# EAGLE schematic ArduSatPayloadModule (EAGLE 6.3), part 1 of 2

## Sheet 1 of 19
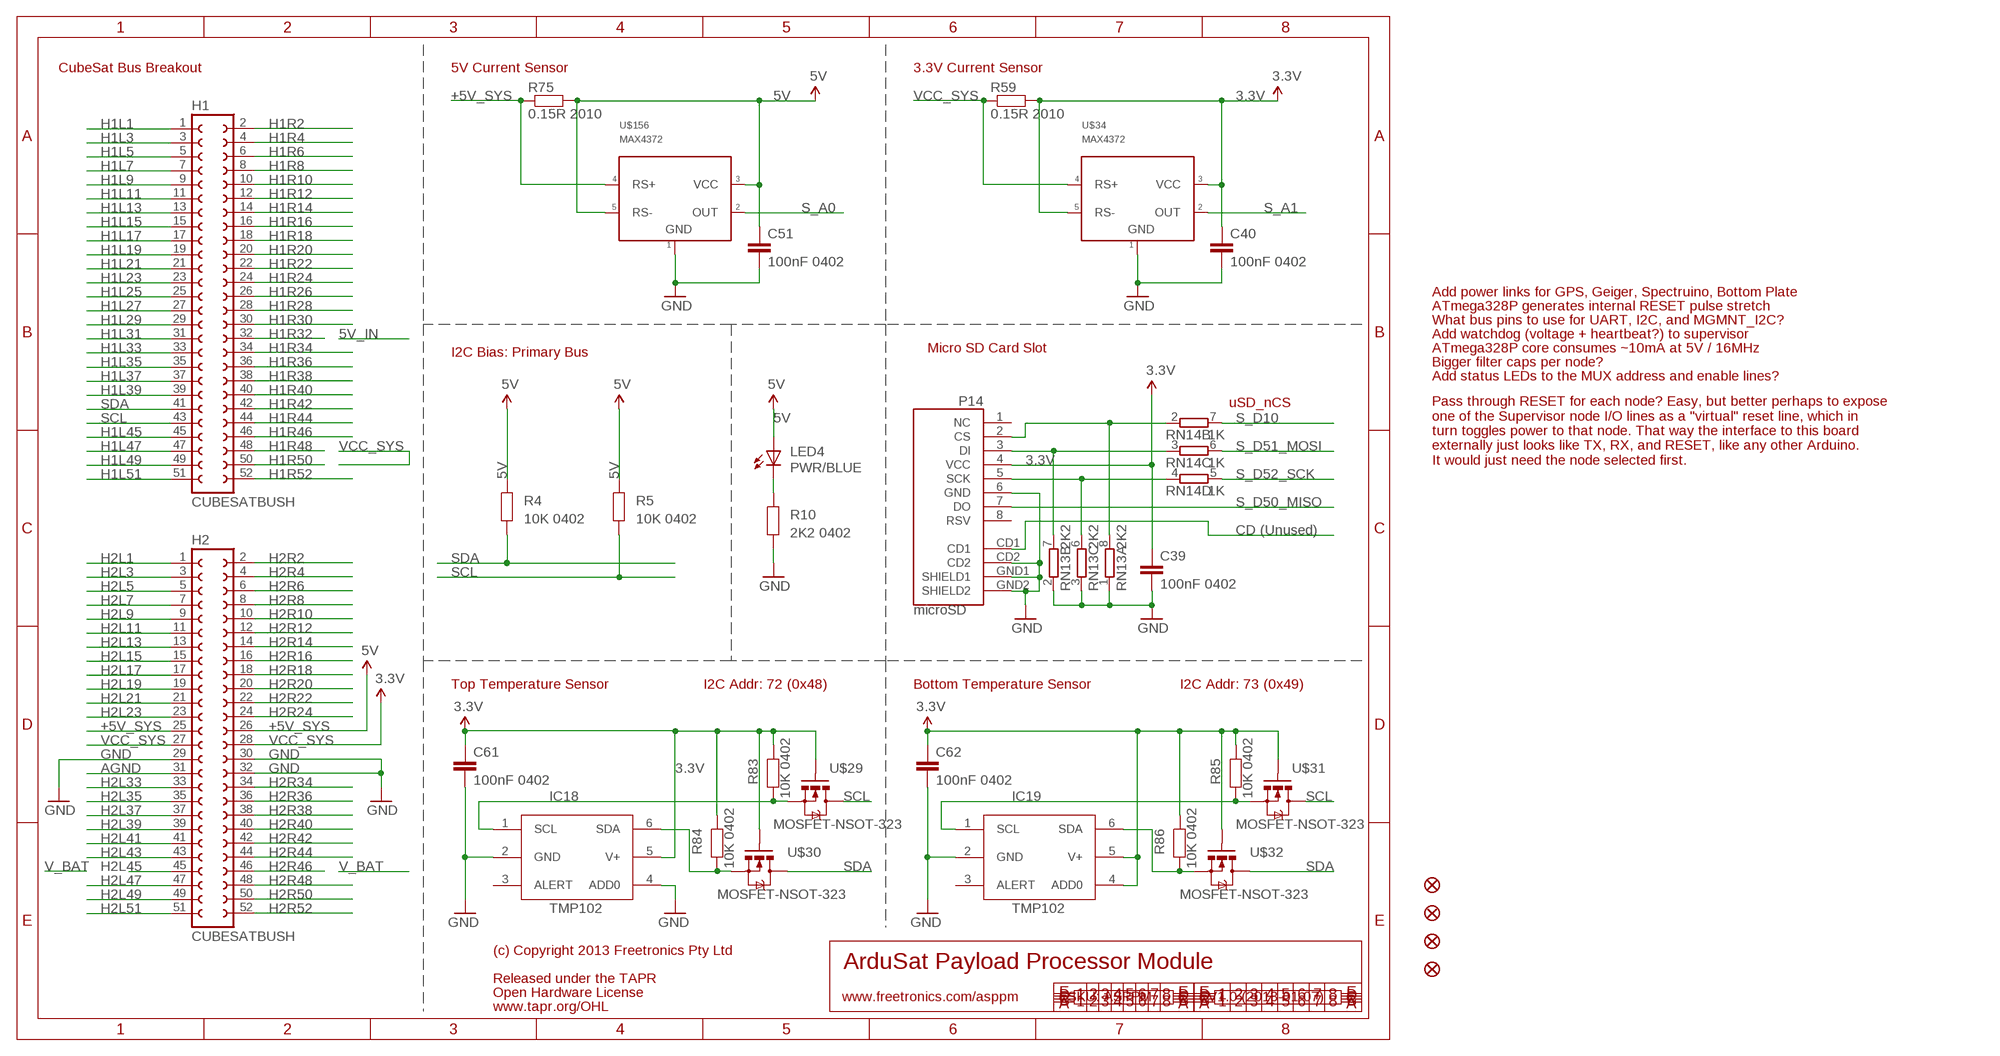
[diagram p0: schematic, sheet 1]

### Parts
C39  100nF 0402  C-EU0402C  [0402C]
C40  100nF 0402  CAP0603  [0603]
C51  100nF 0402  CAP0603  [0603]
C61  100nF 0402  C-EU0402C  [0402C]
C62  100nF 0402  C-EU0402C  [0402C]
FID1  FIDUCIAL1X2.5  [FIDUCIAL-1X2.5]
FID2  FIDUCIAL1X2.5  [FIDUCIAL-1X2.5]
FID3  FIDUCIAL1X2.5  [FIDUCIAL-1X2.5]
FID4  FIDUCIAL1X2.5  [FIDUCIAL-1X2.5]
H1  CUBESATBUSH  [CUBESATBUS]
H2  CUBESATBUSH  [CUBESATBUS]
IC18  TMP102  [SOT563]
IC19  TMP102  [SOT563]
LED4  PWR/BLUE  LED0603  [LED-0603]
P14  microSD  USD-SOCKETNEW  [MICRO-SD-SOCKET-PP]
R4  10K 0402  RESISTOR0402  [0402]
R5  10K 0402  RESISTOR0402  [0402]
R10  2K2 0402  RESISTOR0402  [0402]
R59  0.15R 2010  RESISTOR2010  [R2010]
R75  0.15R 2010  RESISTOR2010  [R2010]
R83  10K 0402  RESISTOR0402  [0402]
R84  10K 0402  RESISTOR0402  [0402]
R85  10K 0402  RESISTOR0402  [0402]
R86  10K 0402  RESISTOR0402  [0402]
RN13  2K2  4R-NCAY16  [CAY16]
RN14  1K  4R-NCAY16  [CAY16]
U$29  MOSFET-NSOT-323  [SOT32-3]
U$30  MOSFET-NSOT-323  [SOT32-3]
U$31  MOSFET-NSOT-323  [SOT32-3]
U$32  MOSFET-NSOT-323  [SOT32-3]
U$34  MAX4372  [SOT23-5]
U$156  MAX4372  [SOT23-5]

### Nets
3.3V: C39.1 C40.1 C61.1 C62.1 IC18.5(V+) IC19.4(ADD0) IC19.5(V+) P14.4(VCC) R59.2 R83.2 R84.2 R85.2 R86.2 U$29.1(G) U$30.1(G) U$31.1(G) U$32.1(G) U$34.3(VCC) U$34.5(RS-) ; also sheet 3
5V: C51.1 LED4.A R4.2 R5.2 R75.2 U$156.3(VCC) U$156.5(RS-) ; also sheet 2,3,4,5,6,7,8,9,10,11,12,13,14,15,16,17,18,19
+5V_SYS: H2.25 H2.26 R75.1 U$156.4(RS+) ; supply symbol labelled 5V
AGND: H2.31
GND: C39.2 C40.2 C51.2 C61.2 C62.2 H2.29 H2.30 H2.32 IC18.2(GND) IC18.4(ADD0) IC19.2(GND) P14.6(GND) P14.CD2 P14.GND1(SHIELD1) P14.GND2(SHIELD2) R10.1 RN13.1 RN13.2 RN13.3 U$34.1(GND) U$156.1(GND) ; also sheet 2,3,4,5,6,7,8,9,10,11,12,13,14,15,16,17,18,19
H1L1: H1.1
H1L3: H1.3
H1L5: H1.5
H1L7: H1.7
H1L9: H1.9
H1L11: H1.11
H1L13: H1.13
H1L15: H1.15
H1L17: H1.17
H1L19: H1.19
H1L21: H1.21
H1L23: H1.23
H1L25: H1.25
H1L27: H1.27
H1L29: H1.29
H1L31: H1.31
H1L33: H1.33
H1L35: H1.35
H1L37: H1.37
H1L39: H1.39
H1L45: H1.45
H1L47: H1.47
H1L49: H1.49
H1L51: H1.51
H1R2: H1.2
H1R4: H1.4
H1R6: H1.6
H1R8: H1.8
H1R10: H1.10
H1R12: H1.12
H1R14: H1.14
H1R16: H1.16
H1R18: H1.18
H1R20: H1.20
H1R22: H1.22
H1R24: H1.24
H1R26: H1.26
H1R28: H1.28
H1R30: H1.30
H1R32: H1.32
H1R34: H1.34
H1R36: H1.36
H1R38: H1.38
H1R40: H1.40
H1R42: H1.42
H1R44: H1.44
H1R46: H1.46
H1R48: H1.48
H1R50: H1.50
H1R52: H1.52
H2L1: H2.1
H2L3: H2.3
H2L5: H2.5
H2L7: H2.7
H2L9: H2.9
H2L11: H2.11
H2L13: H2.13
H2L15: H2.15
H2L17: H2.17
H2L19: H2.19
H2L21: H2.21
H2L23: H2.23
H2L33: H2.33
H2L35: H2.35
H2L37: H2.37
H2L39: H2.39
H2L41: H2.41
H2L43: H2.43
H2L45: H2.45
H2L47: H2.47
H2L49: H2.49
H2L51: H2.51
H2R2: H2.2
H2R4: H2.4
H2R6: H2.6
H2R8: H2.8
H2R10: H2.10
H2R12: H2.12
H2R14: H2.14
H2R16: H2.16
H2R18: H2.18
H2R20: H2.20
H2R22: H2.22
H2R24: H2.24
H2R34: H2.34
H2R36: H2.36
H2R38: H2.38
H2R40: H2.40
H2R42: H2.42
H2R44: H2.44
H2R46: H2.46
H2R48: H2.48
H2R50: H2.50
H2R52: H2.52
N$14: LED4.C R10.2
N$23: P14.2(CS) RN13.8 RN14.2
N$90: P14.3(DI) RN13.7 RN14.3
N$321: P14.5(SCK) RN13.6 RN14.4
N$338: P14.CD1
N$9999: IC18.1(SCL) R83.1 U$29.2(S)
N$10001: IC18.6(SDA) R84.1 U$30.2(S)
N$10002: IC19.6(SDA) R86.1 U$32.2(S)
N$10003: IC19.1(SCL) R85.1 U$31.2(S)
S_A0: U$156.2(OUT) ; also sheet 2
S_A1: U$34.2(OUT) ; also sheet 2
S_D10: RN14.7 ; also sheet 2
S_D50_MISO: P14.7(DO) ; also sheet 2
S_D51_MOSI: RN14.6 ; also sheet 2
S_D52_SCK: RN14.5 ; also sheet 2
SCL: H1.43 R5.1 U$29.3(D) U$31.3(D) ; also sheet 2,3,4,5,6,7,8,9,10,11,12,13,14,15,16,17,18,19
SDA: H1.41 R4.1 U$30.3(D) U$32.3(D) ; also sheet 2,3,4,5,6,7,8,9,10,11,12,13,14,15,16,17,18,19
VCC_SYS: H2.27 H2.28 R59.1 U$34.4(RS+) ; supply symbol labelled 3.3V
Unconnected: IC18.3(ALERT) IC19.3(ALERT) P14.1(NC) P14.8(RSV) RN13.4 RN13.5 RN14.1 RN14.8

### Notes on the sheet
- CubeSat Bus Breakout | 5V Current Sensor | 3.3V Current Sensor
- Add power links for GPS, Geiger, Spectruino, Bottom Plate
- ATmega328P generates internal RESET pulse stretch
- What bus pins to use for UART, I2C, and MGMNT_I2C?
- Add watchdog (voltage + heartbeat?) to supervisor
- Micro SD Card Slot | ATmega328P core consumes ~10mA at 5V / 16MHz
- I2C Bias: Primary Bus
- Bigger filter caps per node?
- Add status LEDs to the MUX address and enable lines?
- uSD_nCS
- Pass through RESET for each node? Easy, but better perhaps to expose
  one of the Supervisor node I/O lines as a "virtual" reset line, which in
  turn toggles power to that node. That way the interface to this board
  externally just looks like TX, RX, and RESET, like any other Arduino.
  It would just need the node selected first.
- CD (Unused)
- Top Temperature Sensor | I2C Addr: 72 (0x48) | Bottom Temperature Sensor | I2C Addr: 73 (0x49)
- (c) Copyright 2013 Freetronics Pty Ltd
- ArduSat Payload Processor Module
- Released under the TAPR
- Open Hardware License
- www.freetronics.com/asppm | SKU: ASPPM | V1.0 (2013-01-07)
- www.tapr.org/OHL

## Sheet 2 of 19
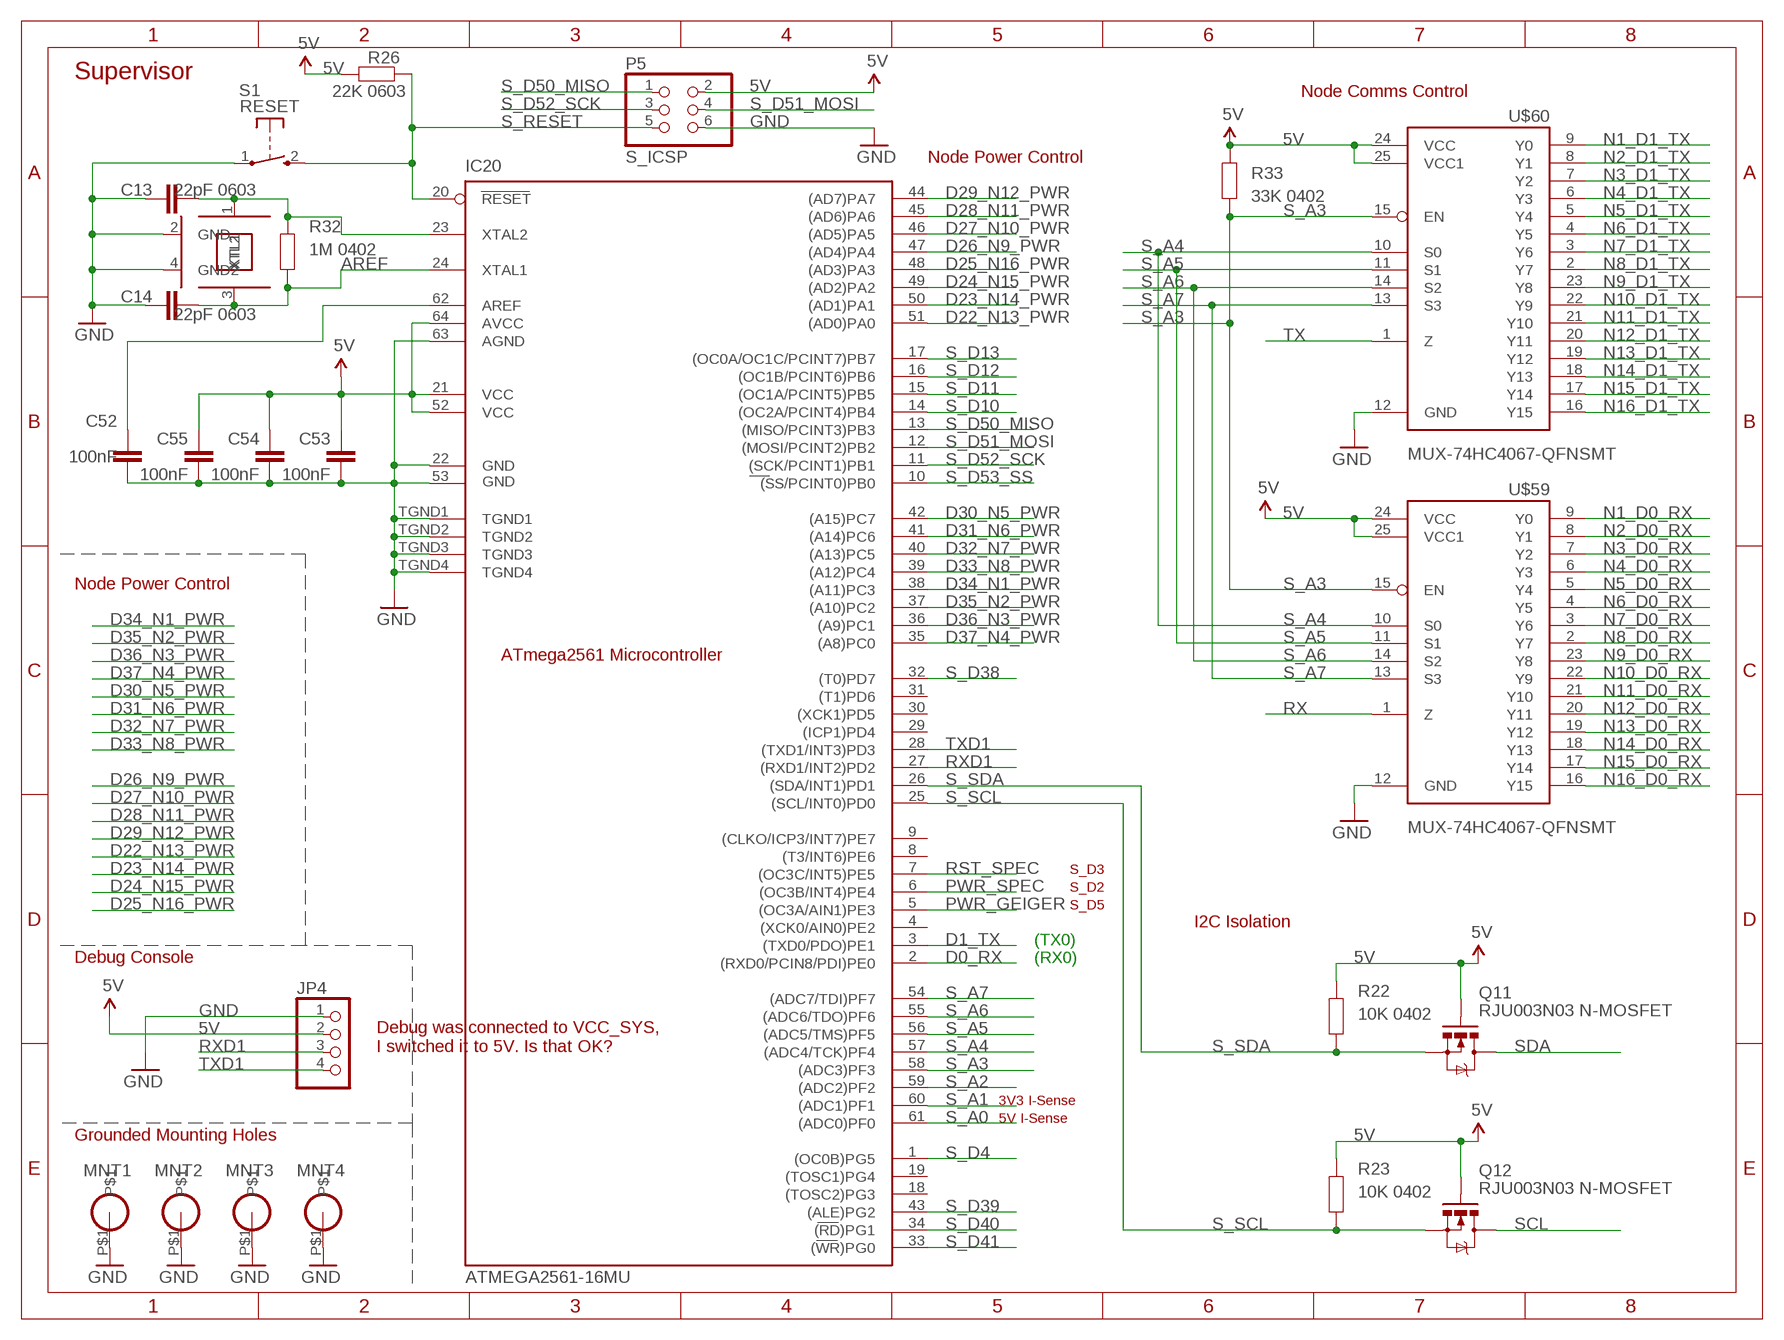
[diagram p1: schematic, sheet 2]

### Parts
C13  22pF 0603  C-EU0402C  [0402C]
C14  22pF 0603  C-EU0402C  [0402C]
C52  100nF  C-EU0402C  [0402C]
C53  100nF  C-EU0402C  [0402C]
C54  100nF  C-EU0402C  [0402C]
C55  100nF  C-EU0402C  [0402C]
IC20  ATMEGA2561-16MU  [MLF64]
JP4  PINHD-1X4/90  [1X04/90]
MNT1  HOLE3.2MM  [HOLE32]
MNT2  HOLE3.2MM  [HOLE32]
MNT3  HOLE3.2MM  [HOLE32]
MNT4  HOLE3.2MM  [HOLE32]
P5  S_ICSP  ICSPPTH  [2X03PTH]
Q11  RJU003N03 N-MOSFET  MOSFET-NSOT-323  [SOT32-3]
Q12  RJU003N03 N-MOSFET  MOSFET-NSOT-323  [SOT32-3]
R22  10K 0402  RESISTOR0402  [0402]
R23  10K 0402  RESISTOR0402  [0402]
R26  22K 0603  RESISTOR0402  [0402]
R32  1M 0402  RESISTOR0402  [0402]
R33  33K 0402  RESISTOR0402  [0402]
S1  RESET  TAC_SWITCH_2PIN  [TACTILE_SWITCH_SMD_2PIN_TINY]
U$53  CRYSTAL-GND3X2  [CRYSTAL-SMD-3X2]
U$59  MUX-74HC4067-QFNSMT  [DHVQFN24]
U$60  MUX-74HC4067-QFNSMT  [DHVQFN24]

### Nets
5V: C53.1 C54.1 C55.1 IC20.21(VCC) IC20.52(VCC1) IC20.64(AVCC) JP4.2 P5.2 Q11.1(G) Q12.1(G) R22.2 R23.2 R26.2 R33.2 U$59.24(VCC) U$59.25(VCC1) U$60.24(VCC) U$60.25(VCC1) ; also sheet 1,3,4,5,6,7,8,9,10,11,12,13,14,15,16,17,18,19
AREF: C14.2 IC20.24(XTAL1) R32.1 U$53.3(XTL2)
D0_RX: IC20.2((RXD0/PCIN8/PDI)PE0)
D1_TX: IC20.3((TXD0/PDO)PE1)
D22_N13_PWR: IC20.51((AD0)PA0) ; also sheet 16
D23_N14_PWR: IC20.50((AD1)PA1) ; also sheet 17
D24_N15_PWR: IC20.49((AD2)PA2) ; also sheet 18
D25_N16_PWR: IC20.48((AD3)PA3) ; also sheet 19
D26_N9_PWR: IC20.47((AD4)PA4) ; also sheet 12
D27_N10_PWR: IC20.46((AD5)PA5) ; also sheet 13
D28_N11_PWR: IC20.45((AD6)PA6) ; also sheet 14
D29_N12_PWR: IC20.44((AD7)PA7) ; also sheet 15
D30_N5_PWR: IC20.42((A15)PC7) ; also sheet 8
D31_N6_PWR: IC20.41((A14)PC6) ; also sheet 9
D32_N7_PWR: IC20.40((A13)PC5) ; also sheet 10
D33_N8_PWR: IC20.39((A12)PC4) ; also sheet 11
D34_N1_PWR: IC20.38((A11)PC3) ; also sheet 4
D35_N2_PWR: IC20.37((A10)PC2) ; also sheet 5
D36_N3_PWR: IC20.36((A9)PC1) ; also sheet 6
D37_N4_PWR: IC20.35((A8)PC0) ; also sheet 7
GND: C13.1 C14.1 C52.2 C53.2 C54.2 C55.2 IC20.22(GND) IC20.53(GND1) IC20.63(AGND) IC20.TGND1 IC20.TGND2 IC20.TGND3 IC20.TGND4 JP4.1 MNT1.P$1 MNT2.P$1 MNT3.P$1 MNT4.P$1 P5.6 S1.1(P) U$53.2(GND) U$53.4(GND2) U$59.12(GND) U$60.12(GND) ; also sheet 1,3,4,5,6,7,8,9,10,11,12,13,14,15,16,17,18,19
N1_D0_RX: U$59.9(Y0) ; also sheet 4
N1_D1_TX: U$60.9(Y0) ; also sheet 4
N2_D0_RX: U$59.8(Y1) ; also sheet 5
N2_D1_TX: U$60.8(Y1) ; also sheet 5
N3_D0_RX: U$59.7(Y2) ; also sheet 6
N3_D1_TX: U$60.7(Y2) ; also sheet 6
N4_D0_RX: U$59.6(Y3) ; also sheet 7
N4_D1_TX: U$60.6(Y3) ; also sheet 7
N5_D0_RX: U$59.5(Y4) ; also sheet 8
N5_D1_TX: U$60.5(Y4) ; also sheet 8
N6_D0_RX: U$59.4(Y5) ; also sheet 9
N6_D1_TX: U$60.4(Y5) ; also sheet 9
N7_D0_RX: U$59.3(Y6) ; also sheet 10
N7_D1_TX: U$60.3(Y6) ; also sheet 10
N8_D0_RX: U$59.2(Y7) ; also sheet 11
N8_D1_TX: U$60.2(Y7) ; also sheet 11
N9_D0_RX: U$59.23(Y8) ; also sheet 12
N9_D1_TX: U$60.23(Y8) ; also sheet 12
N10_D0_RX: U$59.22(Y9) ; also sheet 13
N10_D1_TX: U$60.22(Y9) ; also sheet 13
N11_D0_RX: U$59.21(Y10) ; also sheet 14
N11_D1_TX: U$60.21(Y10) ; also sheet 14
N12_D0_RX: U$59.20(Y11) ; also sheet 15
N12_D1_TX: U$60.20(Y11) ; also sheet 15
N13_D0_RX: U$59.19(Y12) ; also sheet 16
N13_D1_TX: U$60.19(Y12) ; also sheet 16
N14_D0_RX: U$59.18(Y13) ; also sheet 17
N14_D1_TX: U$60.18(Y13) ; also sheet 17
N15_D0_RX: U$59.17(Y14) ; also sheet 18
N15_D1_TX: U$60.17(Y14) ; also sheet 18
N16_D0_RX: U$59.16(Y15) ; also sheet 19
N16_D1_TX: U$60.16(Y15) ; also sheet 19
N$22: C52.1 IC20.62(AREF)
PWR_GEIGER: IC20.5((OC3A/AIN1)PE3) ; also sheet 3
PWR_SPEC: IC20.6((OC3B/INT4)PE4) ; also sheet 3
RST_SPEC: IC20.7((OC3C/INT5)PE5) ; also sheet 3
RX: U$59.1(Z)
RXD1: IC20.27((RXD1/INT2)PD2) JP4.3
S_A0: IC20.61((ADC0)PF0) ; also sheet 1
S_A1: IC20.60((ADC1)PF1) ; also sheet 1
S_A2: IC20.59((ADC2)PF2)
S_A3: IC20.58((ADC3)PF3) R33.1 U$59.15(EN) U$60.15(EN)
S_A4: IC20.57((ADC4/TCK)PF4) U$59.10(S0) U$60.10(S0)
S_A5: IC20.56((ADC5/TMS)PF5) U$59.11(S1) U$60.11(S1)
S_A6: IC20.55((ADC6/TDO)PF6) U$59.14(S2) U$60.14(S2)
S_A7: IC20.54((ADC7/TDI)PF7) U$59.13(S3) U$60.13(S3)
S_D4: IC20.1((OC0B)PG5)
S_D10: IC20.14((OC2A/PCINT4)PB4) ; also sheet 1
S_D11: IC20.15((OC1A/PCINT5)PB5)
S_D12: IC20.16((OC1B/PCINT6)PB6)
S_D13: IC20.17((OC0A/OC1C/PCINT7)PB7)
S_D38: IC20.32((T0)PD7)
S_D39: IC20.43((ALE)PG2)
S_D40: IC20.34((RD)PG1)
S_D41: IC20.33((WR)PG0)
S_D50_MISO: IC20.13((MISO/PCINT3)PB3) P5.1 ; also sheet 1
S_D51_MOSI: IC20.12((MOSI/PCINT2)PB2) P5.4 ; also sheet 1
S_D52_SCK: IC20.11((SCK/PCINT1)PB1) P5.3 ; also sheet 1
S_D53_SS: IC20.10((SS/PCINT0)PB0)
S_RESET: IC20.20(RESET) P5.5 R26.1 S1.2(S)
S_SCL: IC20.25((SCL/INT0)PD0) Q12.2(S) R23.1
S_SDA: IC20.26((SDA/INT1)PD1) Q11.2(S) R22.1
SCL: Q12.3(D) ; also sheet 1,3,4,5,6,7,8,9,10,11,12,13,14,15,16,17,18,19
SDA: Q11.3(D) ; also sheet 1,3,4,5,6,7,8,9,10,11,12,13,14,15,16,17,18,19
TX: U$60.1(Z)
TXD1: IC20.28((TXD1/INT3)PD3) JP4.4
XTAL1: C13.2 IC20.23(XTAL2) R32.2 U$53.1(XTL1)
Unconnected: IC20.4((XCK0/AIN0)PE2) IC20.8((T3/INT6)PE6) IC20.9((CLKO/ICP3/INT7)PE7) IC20.18((TOSC2)PG3) IC20.19((TOSC1)PG4) IC20.29((ICP1)PD4) IC20.30((XCK1)PD5) IC20.31((T1)PD6)

### Notes on the sheet
- Supervisor
- Node Comms Control
- Node Power Control
- Node Power Control
- ATmega2561 Microcontroller
- S_D3
- S_D2
- S_D5
- I2C Isolation
- (TX0)
- Debug Console | (RX0)
- Debug was connected to VCC_SYS,
  I switched it to 5V. Is that OK?
- 3V3 I-Sense
- 5V I-Sense
- Grounded Mounting Holes

## Sheet 3 of 19
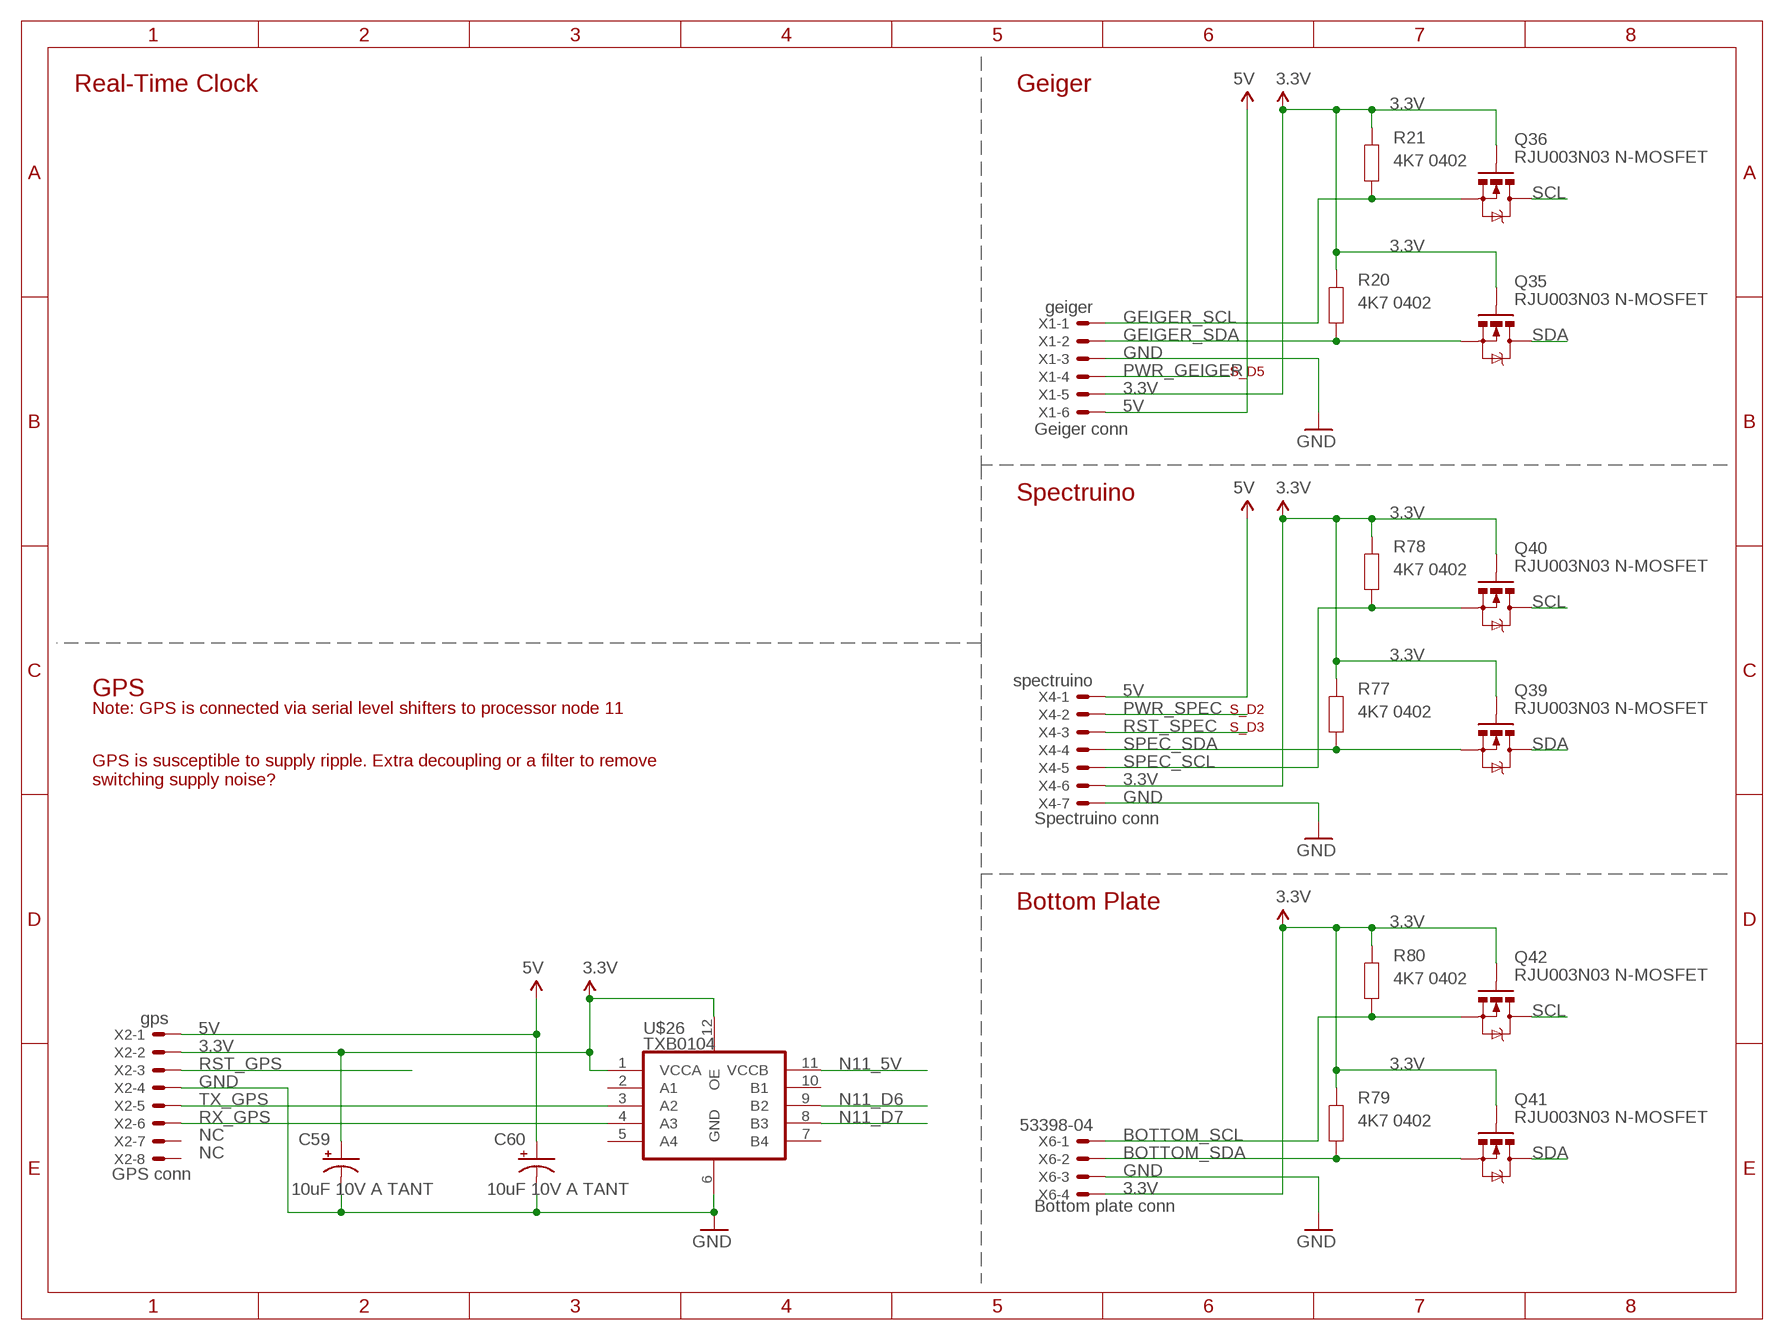
[diagram p2: schematic, sheet 3]

### Parts
C59  10uF 10V A TANT  CAP_POL1206  [EIA3216]
C60  10uF 10V A TANT  CAP_POL1206  [EIA3216]
Q35  RJU003N03 N-MOSFET  MOSFET-NSOT-323  [SOT32-3]
Q36  RJU003N03 N-MOSFET  MOSFET-NSOT-323  [SOT32-3]
Q39  RJU003N03 N-MOSFET  MOSFET-NSOT-323  [SOT32-3]
Q40  RJU003N03 N-MOSFET  MOSFET-NSOT-323  [SOT32-3]
Q41  RJU003N03 N-MOSFET  MOSFET-NSOT-323  [SOT32-3]
Q42  RJU003N03 N-MOSFET  MOSFET-NSOT-323  [SOT32-3]
R20  4K7 0402  RESISTOR0402  [0402]
R21  4K7 0402  RESISTOR0402  [0402]
R77  4K7 0402  RESISTOR0402  [0402]
R78  4K7 0402  RESISTOR0402  [0402]
R79  4K7 0402  RESISTOR0402  [0402]
R80  4K7 0402  RESISTOR0402  [0402]
U$26  TXB0104  [QFN-12]
X1  geiger  53398-06  [53398-06]
X2  gps  53398-08  [53398-08]
X4  spectruino  53398-07  [53398-07]
X6  53398-04  [53398-04]

### Nets
3.3V: C59.A(+) Q35.1(G) Q36.1(G) Q39.1(G) Q40.1(G) Q41.1(G) Q42.1(G) R20.2 R21.2 R77.2 R78.2 R79.2 R80.2 U$26.1(VCCA) U$26.12(OE) X1.5 X2.2 X4.6 X6.4 ; also sheet 1
5V: C60.A(+) X1.6 X2.1 X4.1 ; also sheet 1,2,4,5,6,7,8,9,10,11,12,13,14,15,16,17,18,19
BOTTOM_SCL: Q42.2(S) R80.1 X6.1
BOTTOM_SDA: Q41.2(S) R79.1 X6.2
GEIGER_SCL: Q36.2(S) R21.1 X1.1
GEIGER_SDA: Q35.2(S) R20.1 X1.2
GND: C59.C(-) C60.C(-) U$26.6(GND) X1.3 X2.4 X4.7 X6.3 ; also sheet 1,2,4,5,6,7,8,9,10,11,12,13,14,15,16,17,18,19
N11_5V: U$26.11(VCCB) ; also sheet 14
N11_D6: U$26.9(B2) ; also sheet 14
N11_D7: U$26.8(B3) ; also sheet 14
PWR_GEIGER: X1.4 ; also sheet 2
PWR_SPEC: X4.2 ; also sheet 2
RST_GPS: X2.3
RST_SPEC: X4.3 ; also sheet 2
RX_GPS: U$26.4(A3) X2.6
SCL: Q36.3(D) Q40.3(D) Q42.3(D) ; also sheet 1,2,4,5,6,7,8,9,10,11,12,13,14,15,16,17,18,19
SDA: Q35.3(D) Q39.3(D) Q41.3(D) ; also sheet 1,2,4,5,6,7,8,9,10,11,12,13,14,15,16,17,18,19
SPEC_SCL: Q40.2(S) R78.1 X4.5
SPEC_SDA: Q39.2(S) R77.1 X4.4
TX_GPS: U$26.3(A2) X2.5
Unconnected: U$26.2(A1) U$26.5(A4) U$26.7(B4) U$26.10(B1) X2.7 X2.8

### Notes on the sheet
- Real-Time Clock | Geiger
- S_D5
- Geiger conn
- Spectruino
- GPS
- Note: GPS is connected via serial level shifters to processor node 11 | S_D2
- S_D3
- GPS is susceptible to supply ripple. Extra decoupling or a filter to remove
  switching supply noise?
- Spectruino conn
- Bottom Plate
- NC
- NC
- GPS conn
- Bottom plate conn

## Sheet 4 of 19
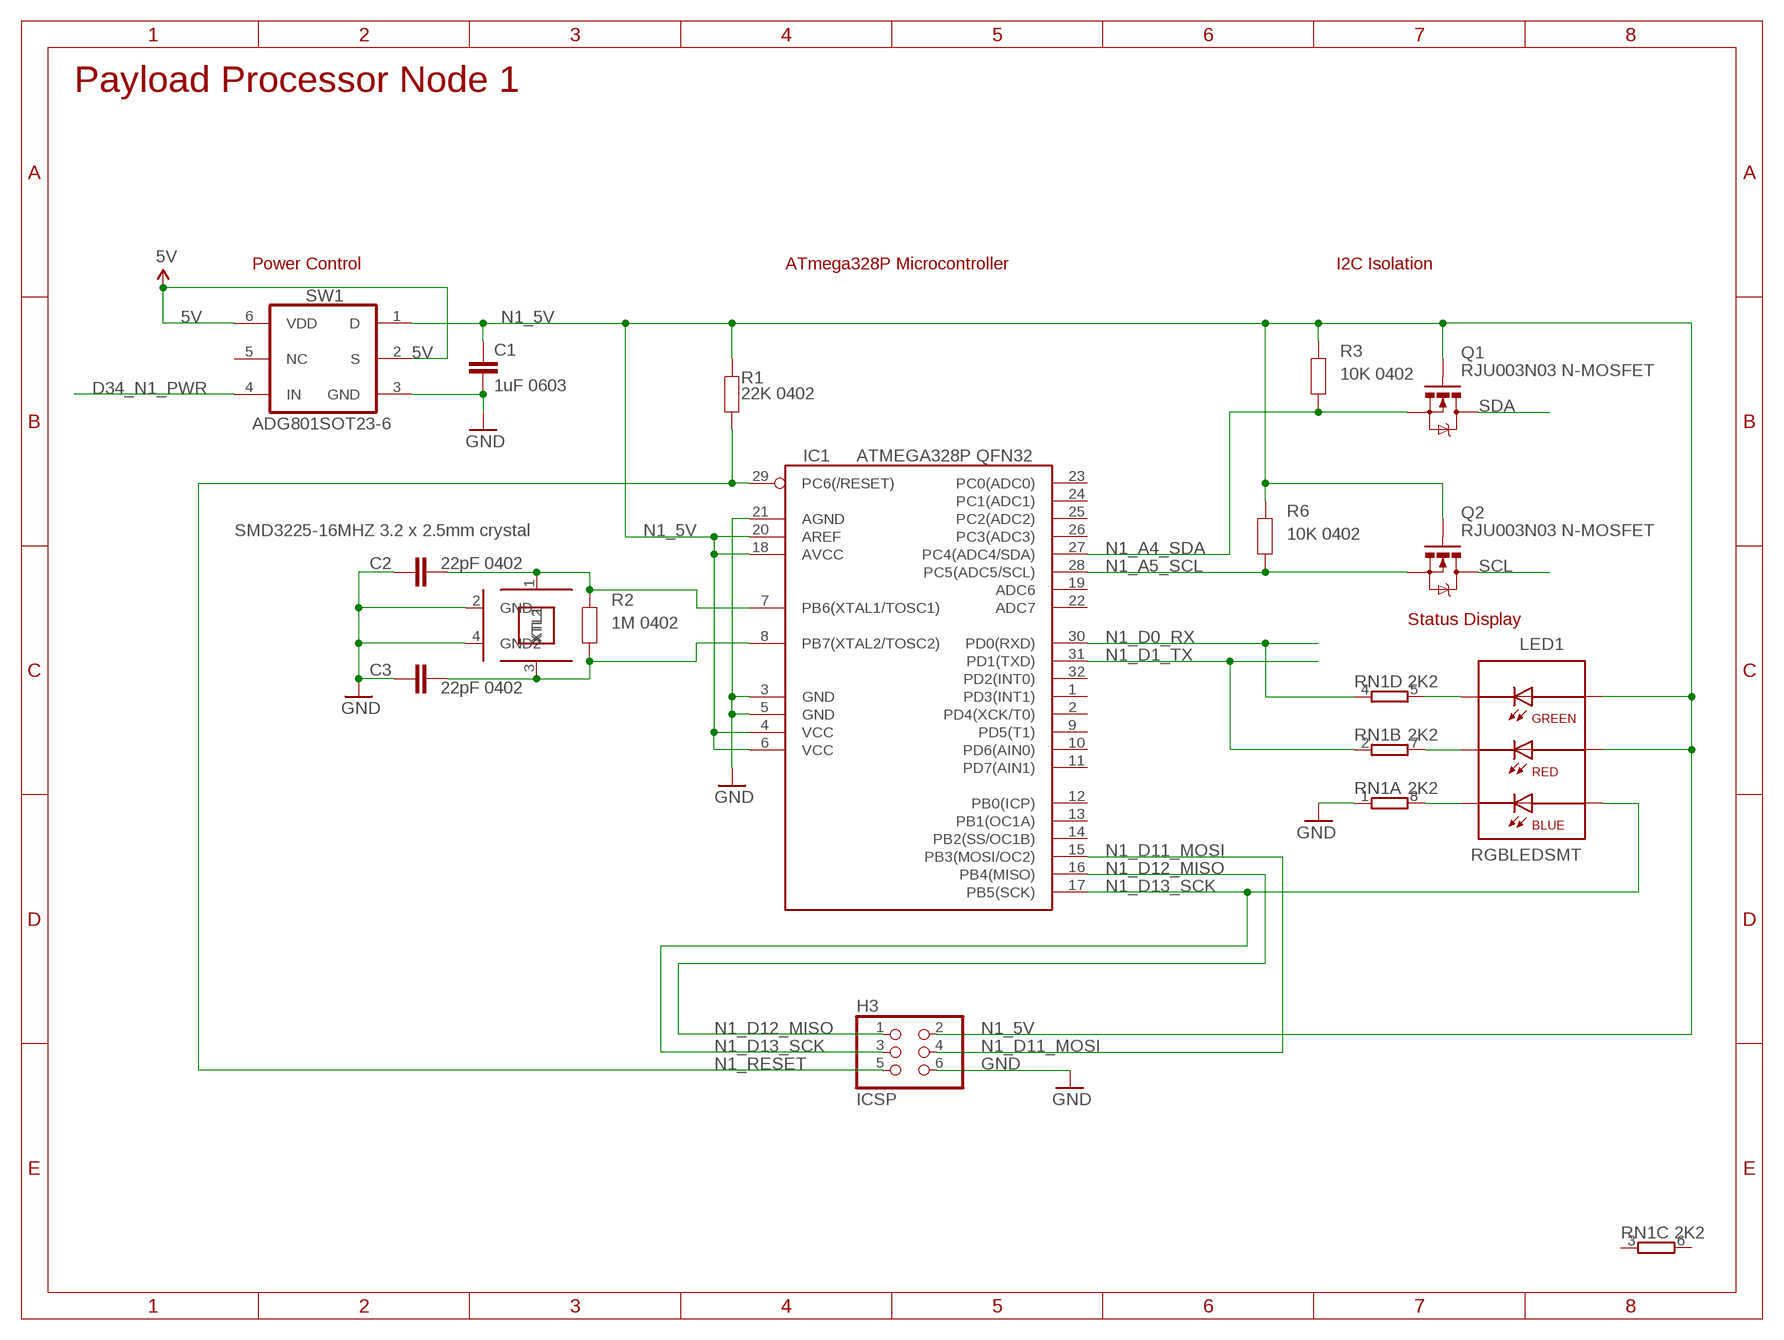
[diagram p3: schematic, sheet 4]

### Parts
C1  1uF 0603  C-EUC0603  [C0603]
C2  22pF 0402  C-EU0402C  [0402C]
C3  22pF 0402  C-EU0402C  [0402C]
H3  ICSP  ICSP2X3-2MM  [M2X3-2MM]
IC1  ATMEGA328P QFN32  AVR-MEGA8-MI  [MLF32]
LED1  RGBLEDSMT  [19-337]
Q1  RJU003N03 N-MOSFET  MOSFET-NSOT-323  [SOT32-3]
Q2  RJU003N03 N-MOSFET  MOSFET-NSOT-323  [SOT32-3]
R1  22K 0402  RESISTOR0402  [0402]
R2  1M 0402  RESISTOR0402  [0402]
R3  10K 0402  RESISTOR0402  [0402]
R6  10K 0402  RESISTOR0402  [0402]
RN1  2K2  4R-NCAY16  [CAY16]
SW1  ADG801SOT23-6  [SOT23-6]
XTL1  SMD3225-16MHZ 3.2 x 2.5mm crystal  CRYSTAL-GND3X2  [CRYSTAL-SMD-3X2]

### Nets
5V: SW1.2(S) SW1.6(VDD) ; also sheet 1,2,3,5,6,7,8,9,10,11,12,13,14,15,16,17,18,19
D34_N1_PWR: SW1.4(IN) ; also sheet 2
GND: C1.2 C2.1 C3.1 H3.6 IC1.3(GND) IC1.5(GND) IC1.21(AGND) RN1.1 SW1.3(GND) XTL1.2(GND) XTL1.4(GND2) ; also sheet 1,2,3,5,6,7,8,9,10,11,12,13,14,15,16,17,18,19
N1_5V: C1.1 H3.2 IC1.4(VCC) IC1.6(VCC) IC1.18(AVCC) IC1.20(AREF) LED1.5(A-R) LED1.6(A-G) Q1.1(G) Q2.1(G) R1.2 R3.2 R6.2 SW1.1(D)
N1_A4_SDA: IC1.27(PC4(ADC4/SDA)) Q1.2(S) R3.1
N1_A5_SCL: IC1.28(PC5(ADC5/SCL)) Q2.2(S) R6.1
N1_D0_RX: IC1.30(PD0(RXD)) RN1.4 ; also sheet 2
N1_D1_TX: IC1.31(PD1(TXD)) RN1.2 ; also sheet 2
N1_D11_MOSI: H3.4 IC1.15(PB3(MOSI/OC2))
N1_D12_MISO: H3.1 IC1.16(PB4(MISO))
N1_D13_SCK: H3.3 IC1.17(PB5(SCK)) LED1.4(A-B)
N1_RESET: H3.5 IC1.29(PC6(/RESET)) R1.1
N$1: LED1.3(C-G) RN1.5
N$384: C3.2 IC1.8(PB7(XTAL2/TOSC2)) R2.1 XTL1.3(XTL2)
N$416: C2.2 IC1.7(PB6(XTAL1/TOSC1)) R2.2 XTL1.1(XTL1)
N$429: LED1.2(C-R) RN1.7
N$430: LED1.1(C-B) RN1.8
SCL: Q2.3(D) ; also sheet 1,2,3,5,6,7,8,9,10,11,12,13,14,15,16,17,18,19
SDA: Q1.3(D) ; also sheet 1,2,3,5,6,7,8,9,10,11,12,13,14,15,16,17,18,19
Unconnected: IC1.1(PD3(INT1)) IC1.2(PD4(XCK/T0)) IC1.9(PD5(T1)) IC1.10(PD6(AIN0)) IC1.11(PD7(AIN1)) IC1.12(PB0(ICP)) IC1.13(PB1(OC1A)) IC1.14(PB2(SS/OC1B)) IC1.19(ADC6) IC1.22(ADC7) IC1.23(PC0(ADC0)) IC1.24(PC1(ADC1)) IC1.25(PC2(ADC2)) IC1.26(PC3(ADC3)) IC1.32(PD2(INT0)) RN1.3 RN1.6 SW1.5(NC)

### Notes on the sheet
- Payload Processor Node 1
- Power Control | ATmega328P Microcontroller | I2C Isolation
- SMD3225-16MHZ 3.2 x 2.5mm crystal
- Status Display

## Sheet 5 of 19
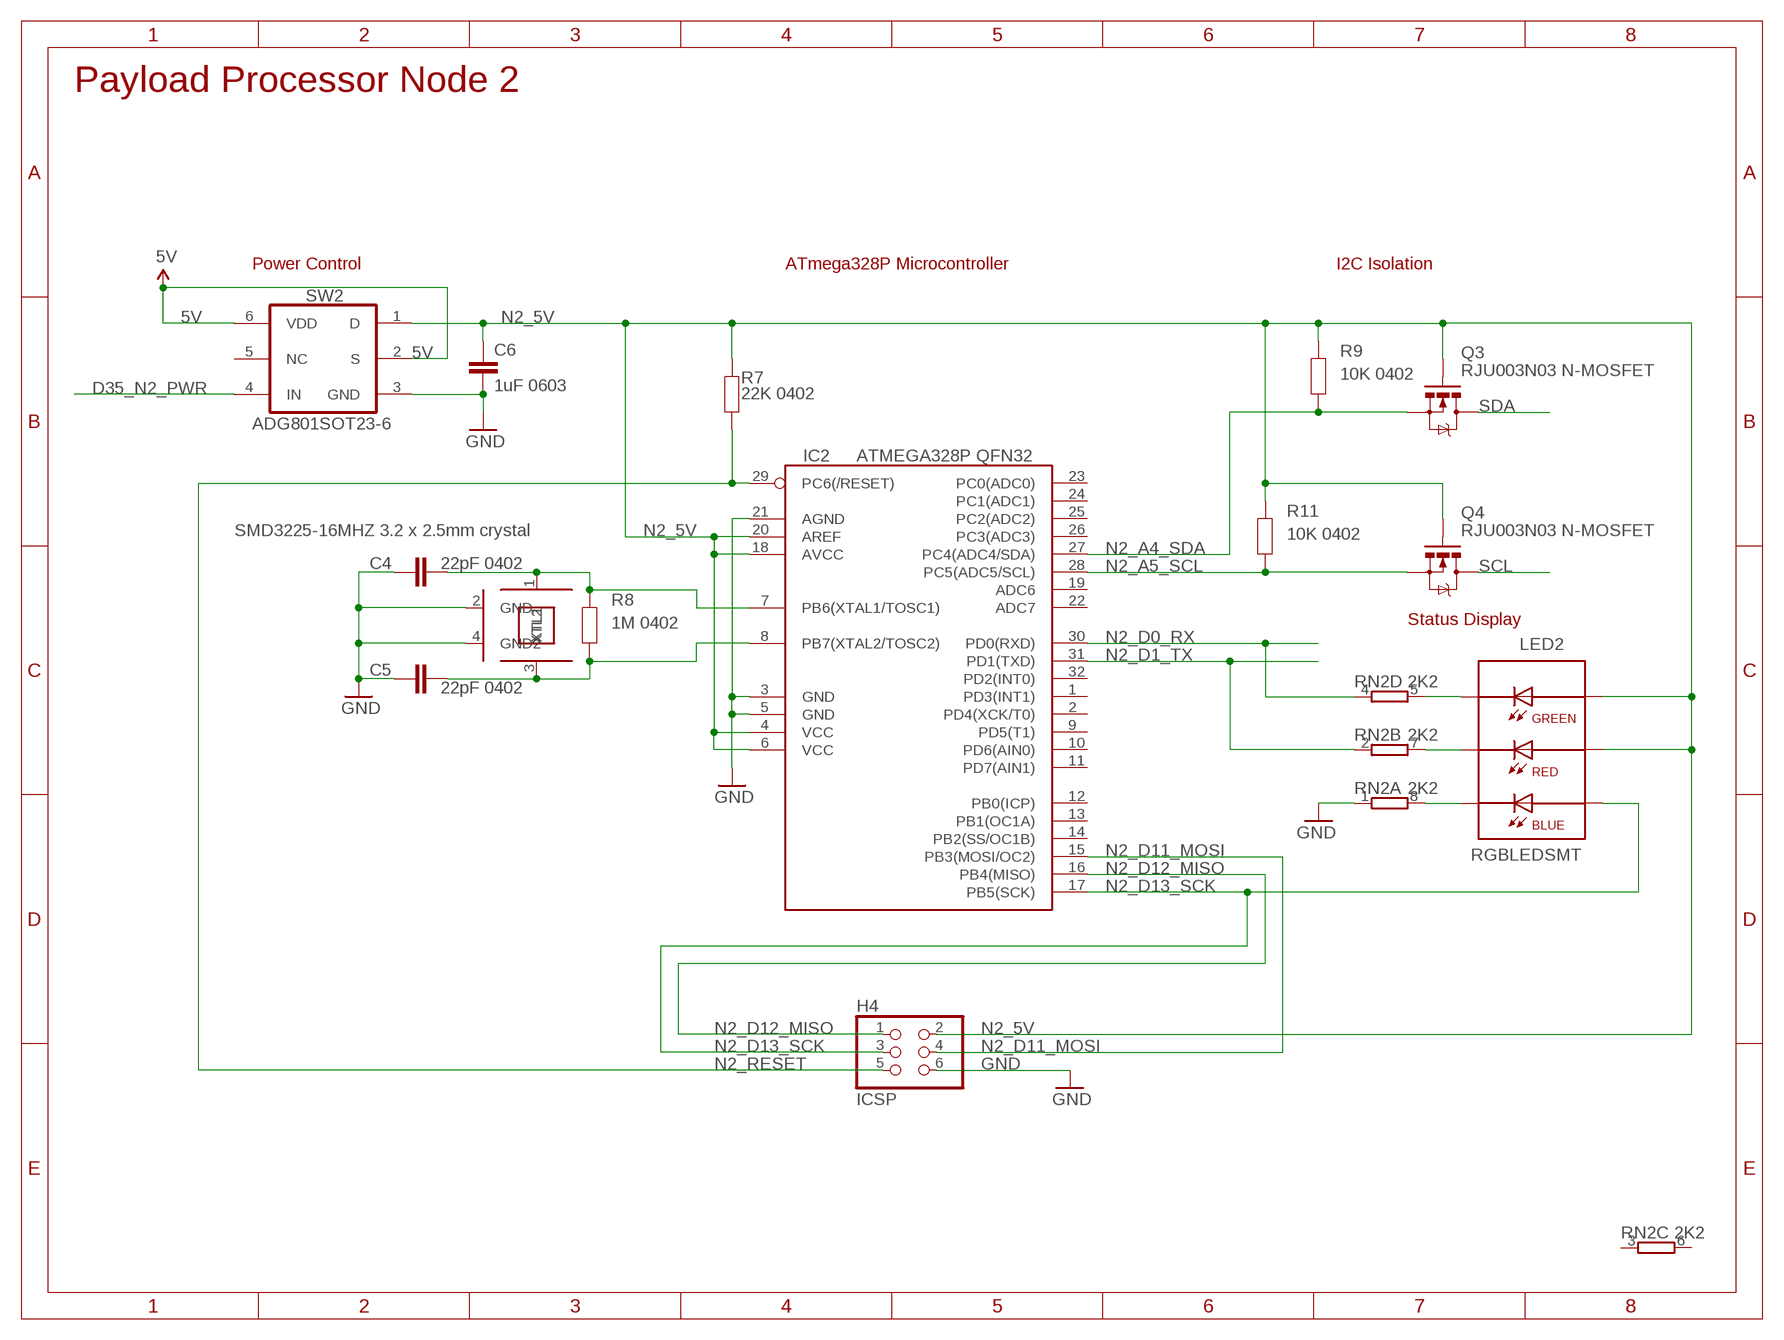
[diagram p4: schematic, sheet 5]

### Parts
C4  22pF 0402  C-EU0402C  [0402C]
C5  22pF 0402  C-EU0402C  [0402C]
C6  1uF 0603  C-EUC0603  [C0603]
H4  ICSP  ICSP2X3-2MM  [M2X3-2MM]
IC2  ATMEGA328P QFN32  AVR-MEGA8-MI  [MLF32]
LED2  RGBLEDSMT  [19-337]
Q3  RJU003N03 N-MOSFET  MOSFET-NSOT-323  [SOT32-3]
Q4  RJU003N03 N-MOSFET  MOSFET-NSOT-323  [SOT32-3]
R7  22K 0402  RESISTOR0402  [0402]
R8  1M 0402  RESISTOR0402  [0402]
R9  10K 0402  RESISTOR0402  [0402]
R11  10K 0402  RESISTOR0402  [0402]
RN2  2K2  4R-NCAY16  [CAY16]
SW2  ADG801SOT23-6  [SOT23-6]
XTL2  SMD3225-16MHZ 3.2 x 2.5mm crystal  CRYSTAL-GND3X2  [CRYSTAL-SMD-3X2]

### Nets
5V: SW2.2(S) SW2.6(VDD) ; also sheet 1,2,3,4,6,7,8,9,10,11,12,13,14,15,16,17,18,19
D35_N2_PWR: SW2.4(IN) ; also sheet 2
GND: C4.1 C5.1 C6.2 H4.6 IC2.3(GND) IC2.5(GND) IC2.21(AGND) RN2.1 SW2.3(GND) XTL2.2(GND) XTL2.4(GND2) ; also sheet 1,2,3,4,6,7,8,9,10,11,12,13,14,15,16,17,18,19
N2_5V: C6.1 H4.2 IC2.4(VCC) IC2.6(VCC) IC2.18(AVCC) IC2.20(AREF) LED2.5(A-R) LED2.6(A-G) Q3.1(G) Q4.1(G) R7.2 R9.2 R11.2 SW2.1(D)
N2_A4_SDA: IC2.27(PC4(ADC4/SDA)) Q3.2(S) R9.1
N2_A5_SCL: IC2.28(PC5(ADC5/SCL)) Q4.2(S) R11.1
N2_D0_RX: IC2.30(PD0(RXD)) RN2.4 ; also sheet 2
N2_D1_TX: IC2.31(PD1(TXD)) RN2.2 ; also sheet 2
N2_D11_MOSI: H4.4 IC2.15(PB3(MOSI/OC2))
N2_D12_MISO: H4.1 IC2.16(PB4(MISO))
N2_D13_SCK: H4.3 IC2.17(PB5(SCK)) LED2.4(A-B)
N2_RESET: H4.5 IC2.29(PC6(/RESET)) R7.1
N$1178: C5.2 IC2.8(PB7(XTAL2/TOSC2)) R8.1 XTL2.3(XTL2)
N$1179: C4.2 IC2.7(PB6(XTAL1/TOSC1)) R8.2 XTL2.1(XTL1)
N$1180: LED2.2(C-R) RN2.7
N$1181: LED2.1(C-B) RN2.8
N$1182: LED2.3(C-G) RN2.5
SCL: Q4.3(D) ; also sheet 1,2,3,4,6,7,8,9,10,11,12,13,14,15,16,17,18,19
SDA: Q3.3(D) ; also sheet 1,2,3,4,6,7,8,9,10,11,12,13,14,15,16,17,18,19
Unconnected: IC2.1(PD3(INT1)) IC2.2(PD4(XCK/T0)) IC2.9(PD5(T1)) IC2.10(PD6(AIN0)) IC2.11(PD7(AIN1)) IC2.12(PB0(ICP)) IC2.13(PB1(OC1A)) IC2.14(PB2(SS/OC1B)) IC2.19(ADC6) IC2.22(ADC7) IC2.23(PC0(ADC0)) IC2.24(PC1(ADC1)) IC2.25(PC2(ADC2)) IC2.26(PC3(ADC3)) IC2.32(PD2(INT0)) RN2.3 RN2.6 SW2.5(NC)

### Notes on the sheet
- Payload Processor Node 2
- Power Control | ATmega328P Microcontroller | I2C Isolation
- SMD3225-16MHZ 3.2 x 2.5mm crystal
- Status Display

## Sheet 6 of 19
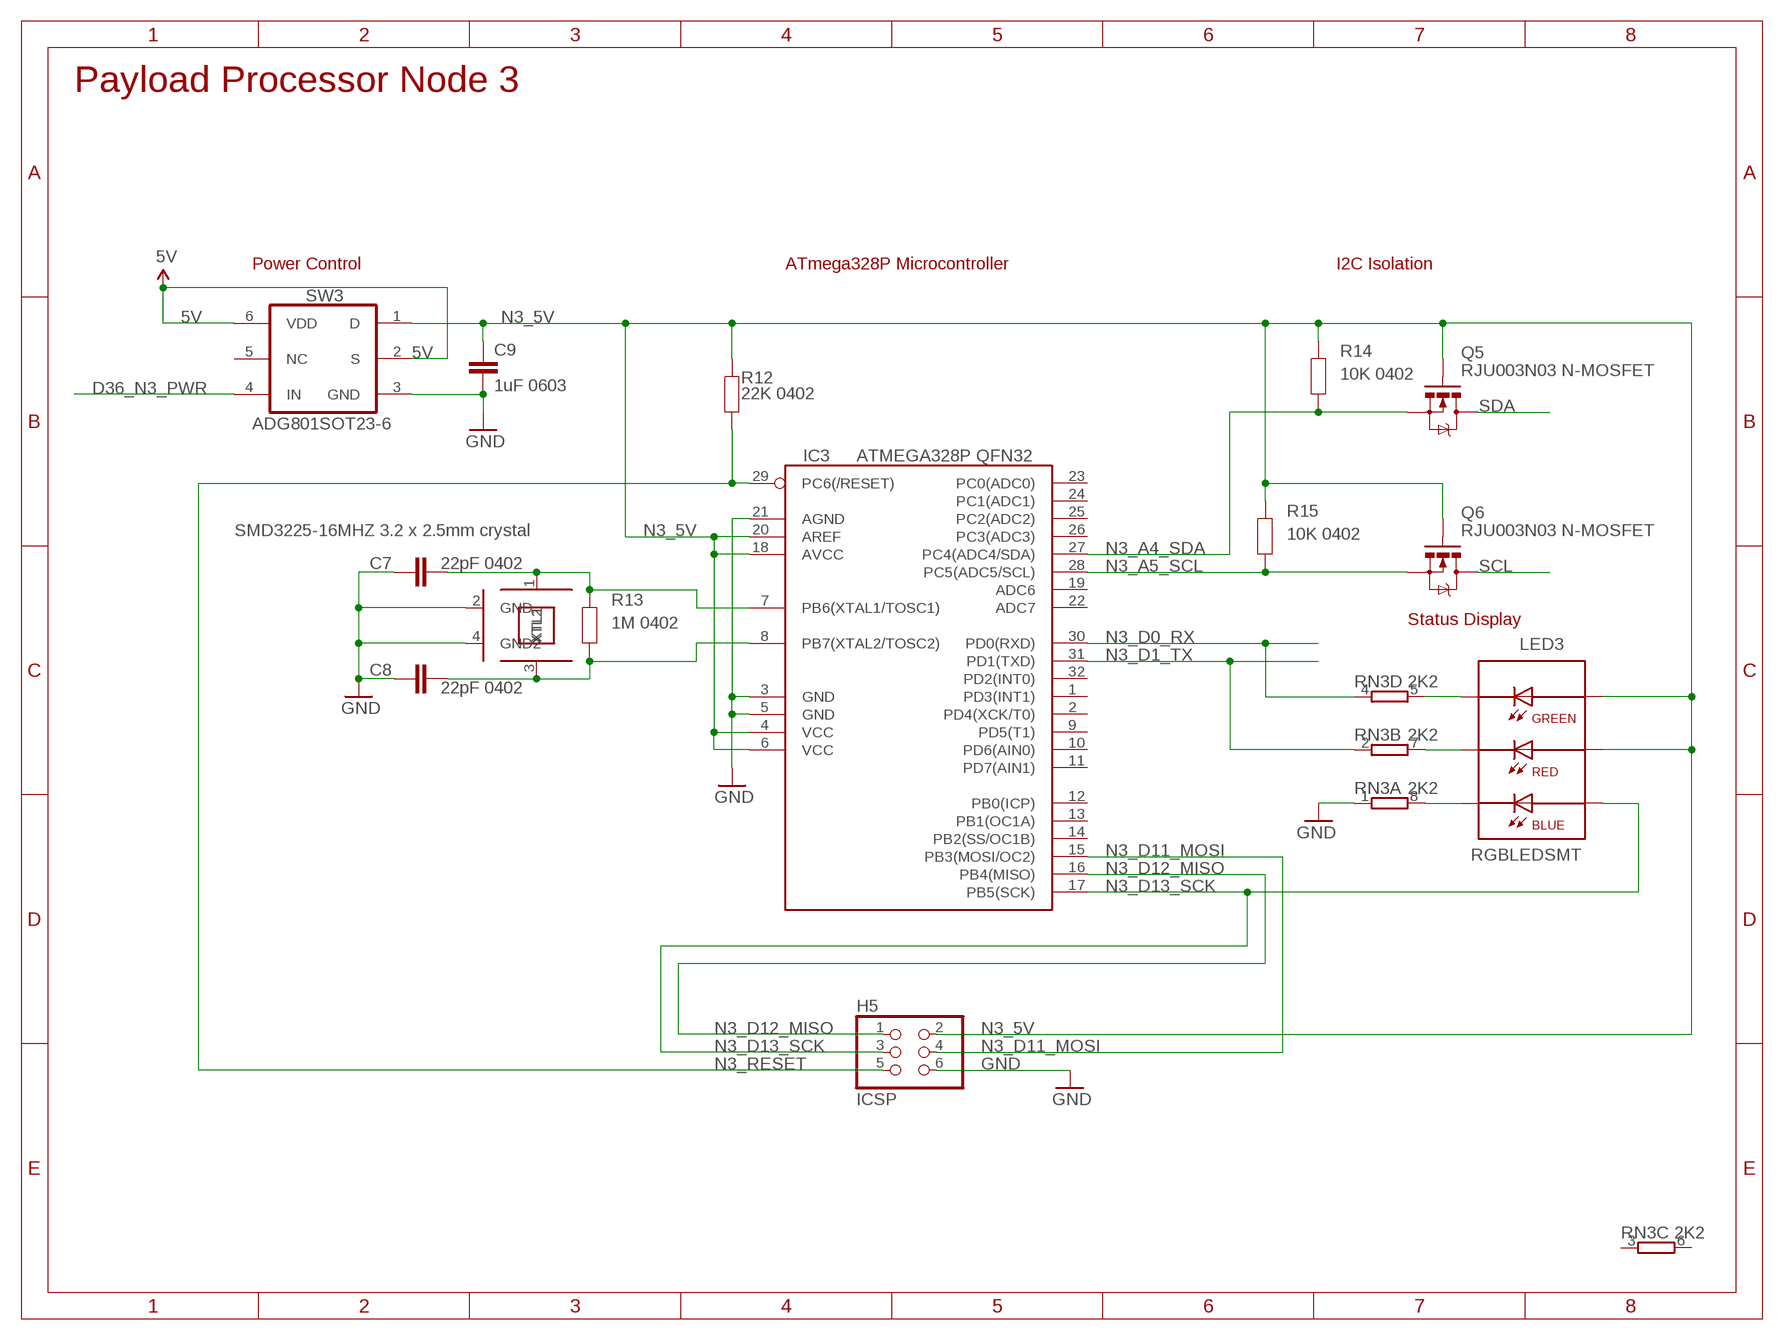
[diagram p5: schematic, sheet 6]

### Parts
C7  22pF 0402  C-EU0402C  [0402C]
C8  22pF 0402  C-EU0402C  [0402C]
C9  1uF 0603  C-EUC0603  [C0603]
H5  ICSP  ICSP2X3-2MM  [M2X3-2MM]
IC3  ATMEGA328P QFN32  AVR-MEGA8-MI  [MLF32]
LED3  RGBLEDSMT  [19-337]
Q5  RJU003N03 N-MOSFET  MOSFET-NSOT-323  [SOT32-3]
Q6  RJU003N03 N-MOSFET  MOSFET-NSOT-323  [SOT32-3]
R12  22K 0402  RESISTOR0402  [0402]
R13  1M 0402  RESISTOR0402  [0402]
R14  10K 0402  RESISTOR0402  [0402]
R15  10K 0402  RESISTOR0402  [0402]
RN3  2K2  4R-NCAY16  [CAY16]
SW3  ADG801SOT23-6  [SOT23-6]
XTL3  SMD3225-16MHZ 3.2 x 2.5mm crystal  CRYSTAL-GND3X2  [CRYSTAL-SMD-3X2]

### Nets
5V: SW3.2(S) SW3.6(VDD) ; also sheet 1,2,3,4,5,7,8,9,10,11,12,13,14,15,16,17,18,19
D36_N3_PWR: SW3.4(IN) ; also sheet 2
GND: C7.1 C8.1 C9.2 H5.6 IC3.3(GND) IC3.5(GND) IC3.21(AGND) RN3.1 SW3.3(GND) XTL3.2(GND) XTL3.4(GND2) ; also sheet 1,2,3,4,5,7,8,9,10,11,12,13,14,15,16,17,18,19
N3_5V: C9.1 H5.2 IC3.4(VCC) IC3.6(VCC) IC3.18(AVCC) IC3.20(AREF) LED3.5(A-R) LED3.6(A-G) Q5.1(G) Q6.1(G) R12.2 R14.2 R15.2 SW3.1(D)
N3_A4_SDA: IC3.27(PC4(ADC4/SDA)) Q5.2(S) R14.1
N3_A5_SCL: IC3.28(PC5(ADC5/SCL)) Q6.2(S) R15.1
N3_D0_RX: IC3.30(PD0(RXD)) RN3.4 ; also sheet 2
N3_D1_TX: IC3.31(PD1(TXD)) RN3.2 ; also sheet 2
N3_D11_MOSI: H5.4 IC3.15(PB3(MOSI/OC2))
N3_D12_MISO: H5.1 IC3.16(PB4(MISO))
N3_D13_SCK: H5.3 IC3.17(PB5(SCK)) LED3.4(A-B)
N3_RESET: H5.5 IC3.29(PC6(/RESET)) R12.1
N$1766: C8.2 IC3.8(PB7(XTAL2/TOSC2)) R13.1 XTL3.3(XTL2)
N$1767: C7.2 IC3.7(PB6(XTAL1/TOSC1)) R13.2 XTL3.1(XTL1)
N$1768: LED3.2(C-R) RN3.7
N$1769: LED3.1(C-B) RN3.8
N$1770: LED3.3(C-G) RN3.5
SCL: Q6.3(D) ; also sheet 1,2,3,4,5,7,8,9,10,11,12,13,14,15,16,17,18,19
SDA: Q5.3(D) ; also sheet 1,2,3,4,5,7,8,9,10,11,12,13,14,15,16,17,18,19
Unconnected: IC3.1(PD3(INT1)) IC3.2(PD4(XCK/T0)) IC3.9(PD5(T1)) IC3.10(PD6(AIN0)) IC3.11(PD7(AIN1)) IC3.12(PB0(ICP)) IC3.13(PB1(OC1A)) IC3.14(PB2(SS/OC1B)) IC3.19(ADC6) IC3.22(ADC7) IC3.23(PC0(ADC0)) IC3.24(PC1(ADC1)) IC3.25(PC2(ADC2)) IC3.26(PC3(ADC3)) IC3.32(PD2(INT0)) RN3.3 RN3.6 SW3.5(NC)

### Notes on the sheet
- Payload Processor Node 3
- Power Control | ATmega328P Microcontroller | I2C Isolation
- SMD3225-16MHZ 3.2 x 2.5mm crystal
- Status Display

## Sheet 7 of 19
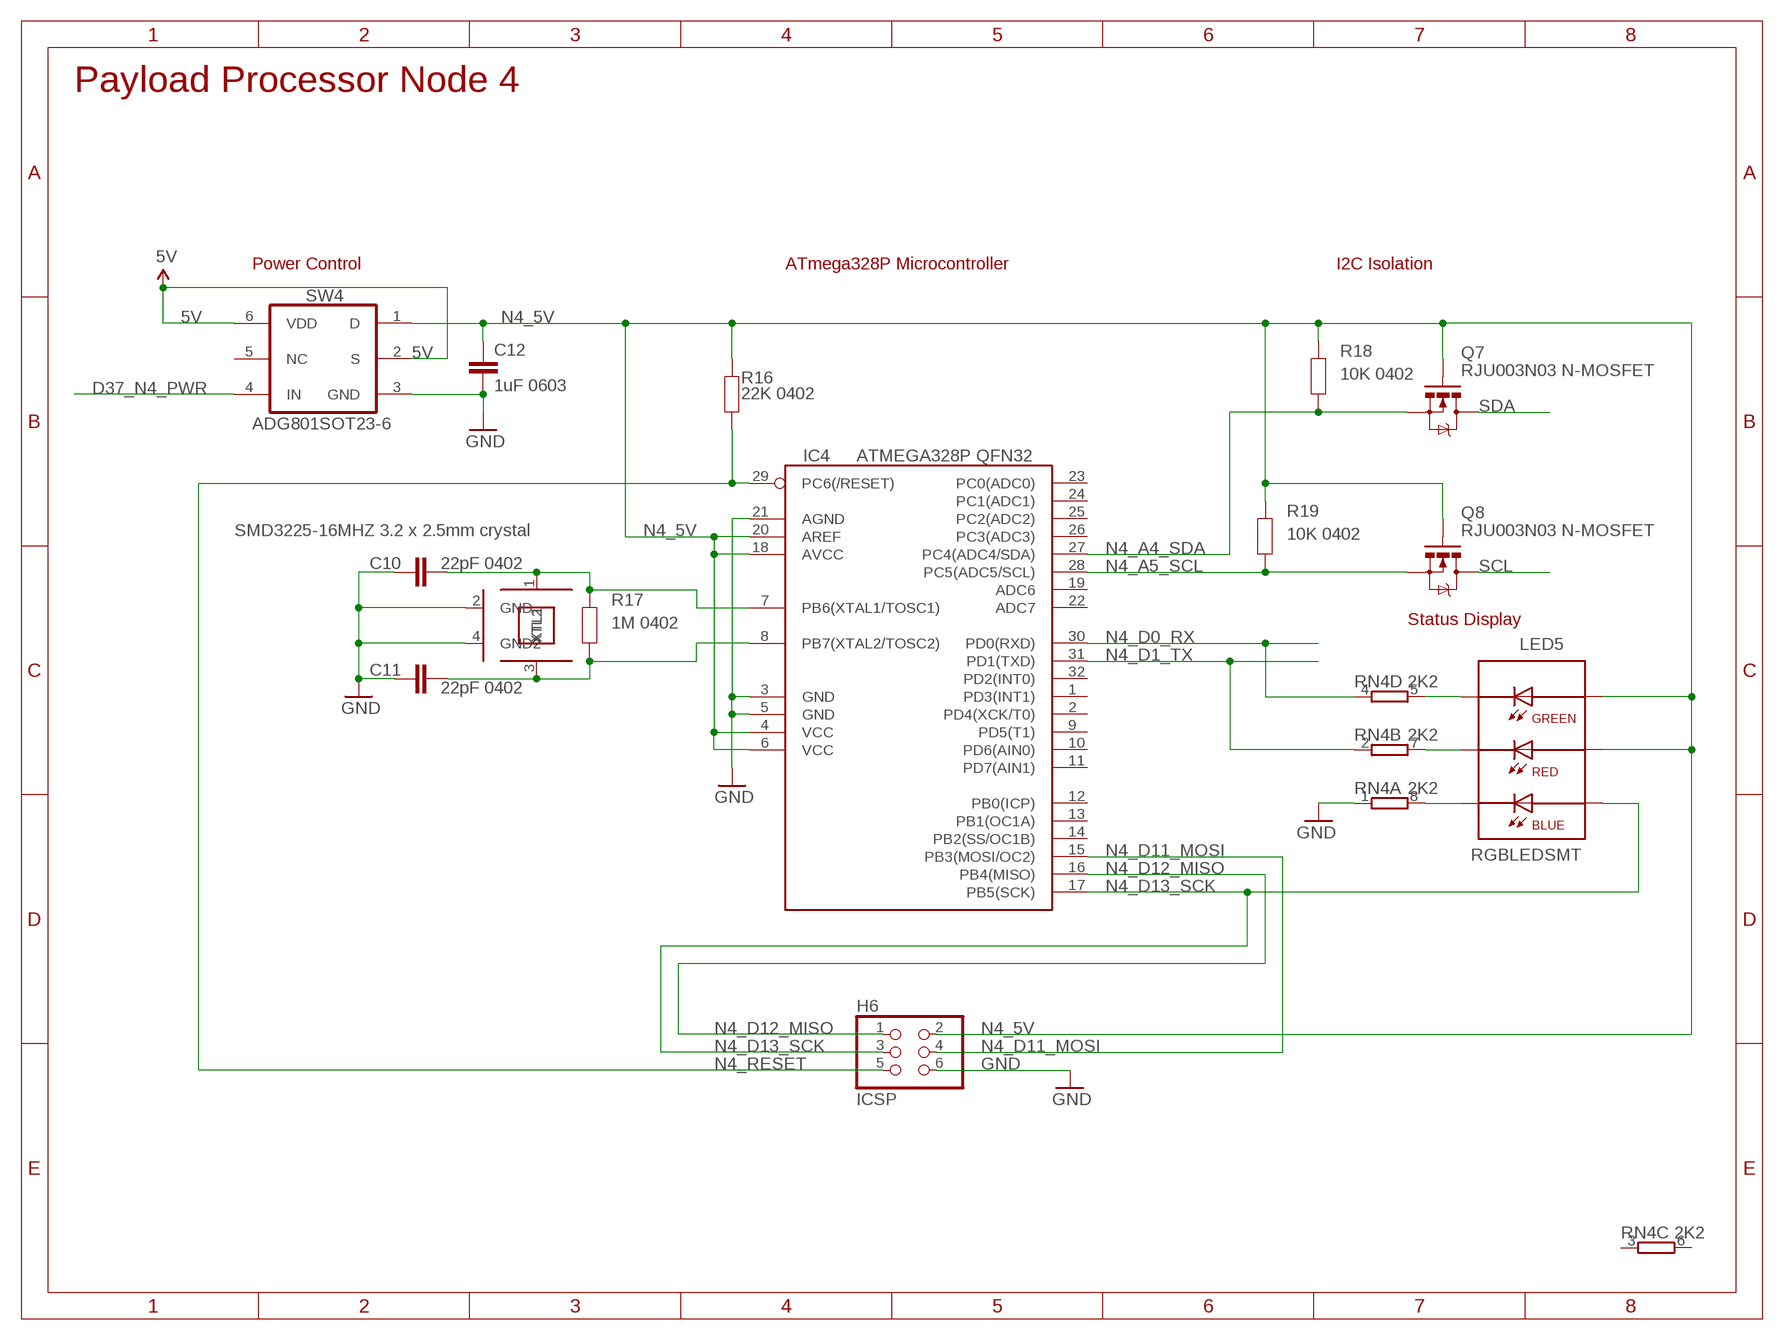
[diagram p6: schematic, sheet 7]

### Parts
C10  22pF 0402  C-EU0402C  [0402C]
C11  22pF 0402  C-EU0402C  [0402C]
C12  1uF 0603  C-EUC0603  [C0603]
H6  ICSP  ICSP2X3-2MM  [M2X3-2MM]
IC4  ATMEGA328P QFN32  AVR-MEGA8-MI  [MLF32]
LED5  RGBLEDSMT  [19-337]
Q7  RJU003N03 N-MOSFET  MOSFET-NSOT-323  [SOT32-3]
Q8  RJU003N03 N-MOSFET  MOSFET-NSOT-323  [SOT32-3]
R16  22K 0402  RESISTOR0402  [0402]
R17  1M 0402  RESISTOR0402  [0402]
R18  10K 0402  RESISTOR0402  [0402]
R19  10K 0402  RESISTOR0402  [0402]
RN4  2K2  4R-NCAY16  [CAY16]
SW4  ADG801SOT23-6  [SOT23-6]
XTL4  SMD3225-16MHZ 3.2 x 2.5mm crystal  CRYSTAL-GND3X2  [CRYSTAL-SMD-3X2]

### Nets
5V: SW4.2(S) SW4.6(VDD) ; also sheet 1,2,3,4,5,6,8,9,10,11,12,13,14,15,16,17,18,19
D37_N4_PWR: SW4.4(IN) ; also sheet 2
GND: C10.1 C11.1 C12.2 H6.6 IC4.3(GND) IC4.5(GND) IC4.21(AGND) RN4.1 SW4.3(GND) XTL4.2(GND) XTL4.4(GND2) ; also sheet 1,2,3,4,5,6,8,9,10,11,12,13,14,15,16,17,18,19
N4_5V: C12.1 H6.2 IC4.4(VCC) IC4.6(VCC) IC4.18(AVCC) IC4.20(AREF) LED5.5(A-R) LED5.6(A-G) Q7.1(G) Q8.1(G) R16.2 R18.2 R19.2 SW4.1(D)
N4_A4_SDA: IC4.27(PC4(ADC4/SDA)) Q7.2(S) R18.1
N4_A5_SCL: IC4.28(PC5(ADC5/SCL)) Q8.2(S) R19.1
N4_D0_RX: IC4.30(PD0(RXD)) RN4.4 ; also sheet 2
N4_D1_TX: IC4.31(PD1(TXD)) RN4.2 ; also sheet 2
N4_D11_MOSI: H6.4 IC4.15(PB3(MOSI/OC2))
N4_D12_MISO: H6.1 IC4.16(PB4(MISO))
N4_D13_SCK: H6.3 IC4.17(PB5(SCK)) LED5.4(A-B)
N4_RESET: H6.5 IC4.29(PC6(/RESET)) R16.1
N$2354: C11.2 IC4.8(PB7(XTAL2/TOSC2)) R17.1 XTL4.3(XTL2)
N$2355: C10.2 IC4.7(PB6(XTAL1/TOSC1)) R17.2 XTL4.1(XTL1)
N$2356: LED5.2(C-R) RN4.7
N$2357: LED5.1(C-B) RN4.8
N$2358: LED5.3(C-G) RN4.5
SCL: Q8.3(D) ; also sheet 1,2,3,4,5,6,8,9,10,11,12,13,14,15,16,17,18,19
SDA: Q7.3(D) ; also sheet 1,2,3,4,5,6,8,9,10,11,12,13,14,15,16,17,18,19
Unconnected: IC4.1(PD3(INT1)) IC4.2(PD4(XCK/T0)) IC4.9(PD5(T1)) IC4.10(PD6(AIN0)) IC4.11(PD7(AIN1)) IC4.12(PB0(ICP)) IC4.13(PB1(OC1A)) IC4.14(PB2(SS/OC1B)) IC4.19(ADC6) IC4.22(ADC7) IC4.23(PC0(ADC0)) IC4.24(PC1(ADC1)) IC4.25(PC2(ADC2)) IC4.26(PC3(ADC3)) IC4.32(PD2(INT0)) RN4.3 RN4.6 SW4.5(NC)

### Notes on the sheet
- Payload Processor Node 4
- Power Control | ATmega328P Microcontroller | I2C Isolation
- SMD3225-16MHZ 3.2 x 2.5mm crystal
- Status Display

## Sheet 8 of 19
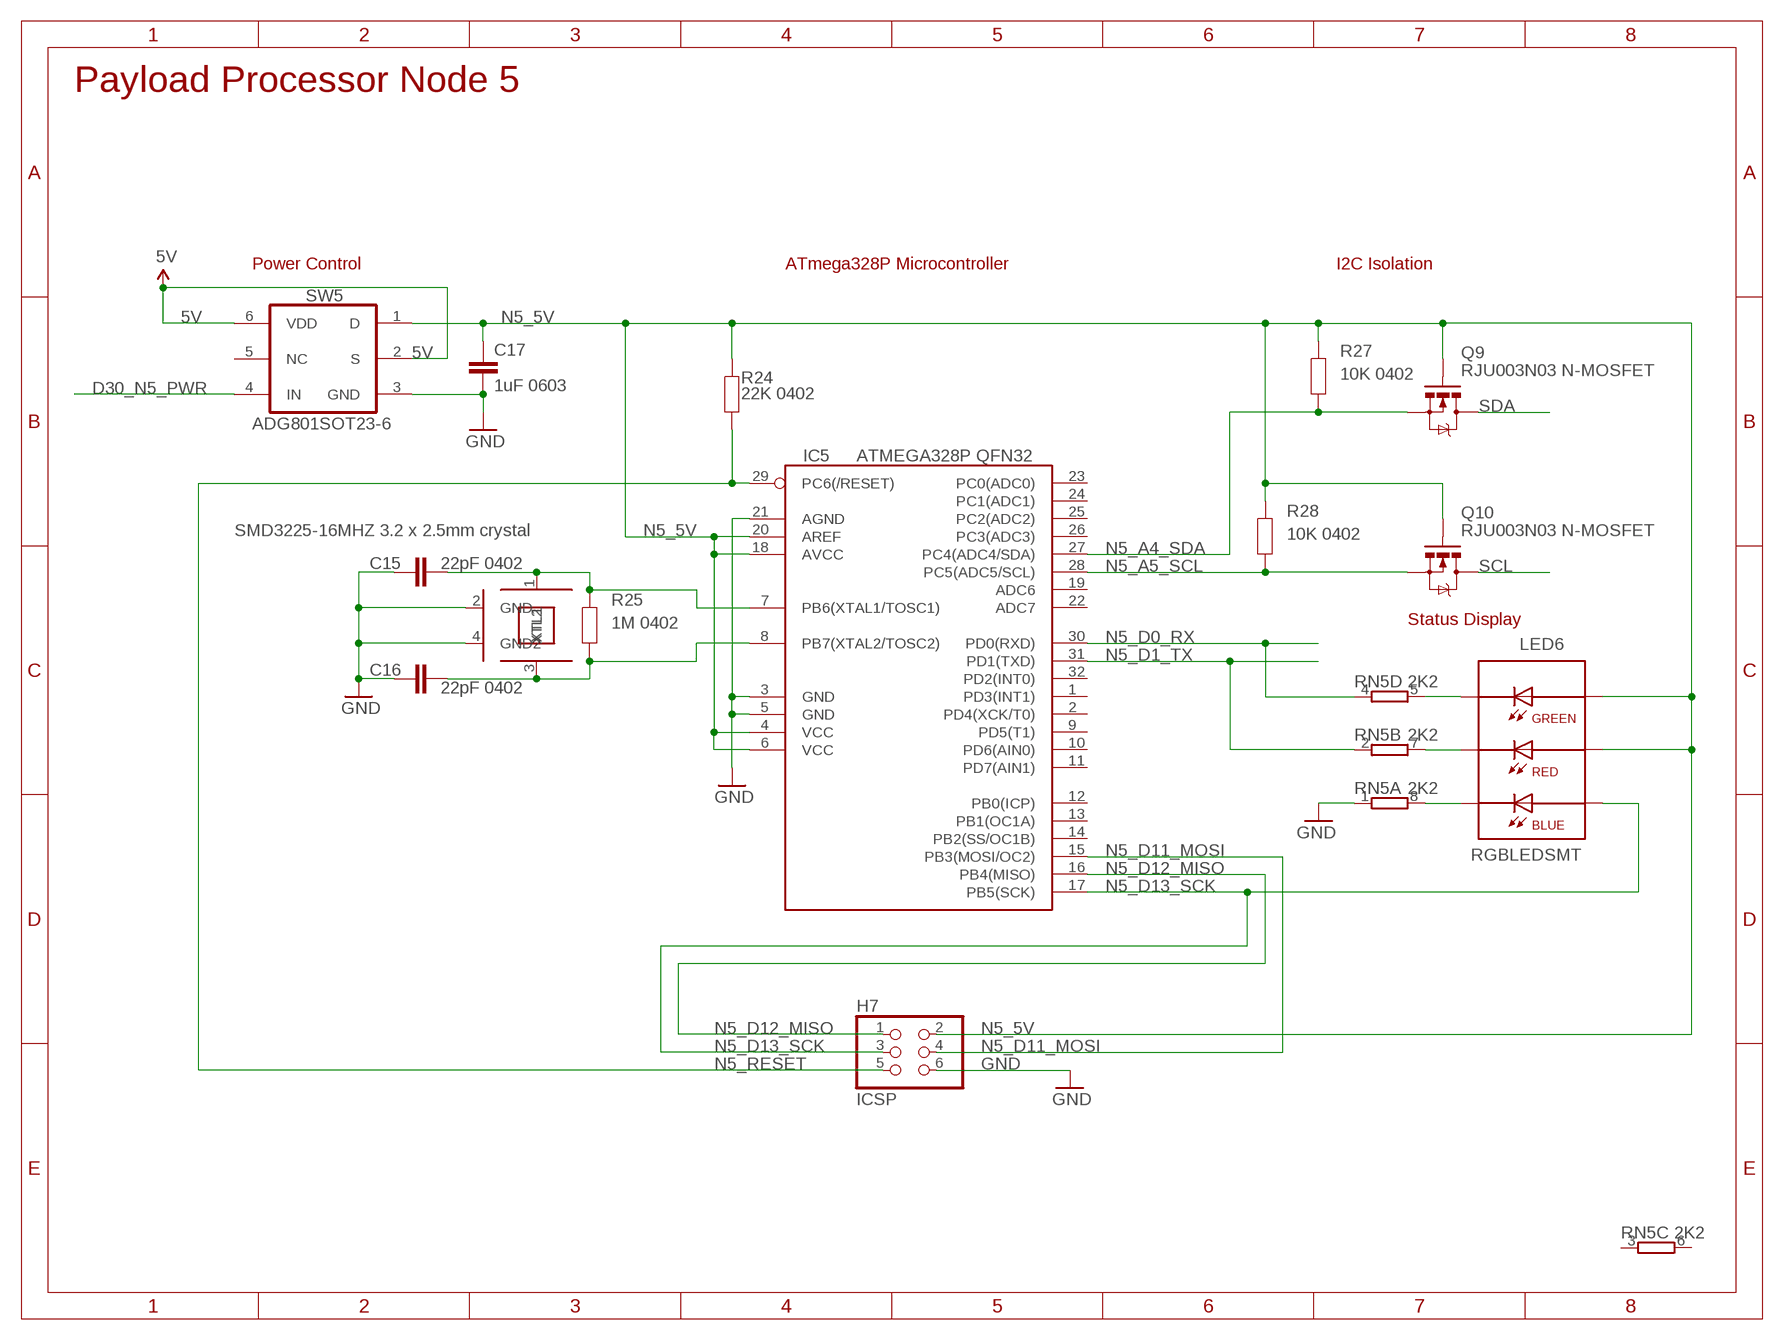
[diagram p7: schematic, sheet 8]

### Parts
C15  22pF 0402  C-EU0402C  [0402C]
C16  22pF 0402  C-EU0402C  [0402C]
C17  1uF 0603  C-EUC0603  [C0603]
H7  ICSP  ICSP2X3-2MM  [M2X3-2MM]
IC5  ATMEGA328P QFN32  AVR-MEGA8-MI  [MLF32]
LED6  RGBLEDSMT  [19-337]
Q9  RJU003N03 N-MOSFET  MOSFET-NSOT-323  [SOT32-3]
Q10  RJU003N03 N-MOSFET  MOSFET-NSOT-323  [SOT32-3]
R24  22K 0402  RESISTOR0402  [0402]
R25  1M 0402  RESISTOR0402  [0402]
R27  10K 0402  RESISTOR0402  [0402]
R28  10K 0402  RESISTOR0402  [0402]
RN5  2K2  4R-NCAY16  [CAY16]
SW5  ADG801SOT23-6  [SOT23-6]
XTL5  SMD3225-16MHZ 3.2 x 2.5mm crystal  CRYSTAL-GND3X2  [CRYSTAL-SMD-3X2]

### Nets
5V: SW5.2(S) SW5.6(VDD) ; also sheet 1,2,3,4,5,6,7,9,10,11,12,13,14,15,16,17,18,19
D30_N5_PWR: SW5.4(IN) ; also sheet 2
GND: C15.1 C16.1 C17.2 H7.6 IC5.3(GND) IC5.5(GND) IC5.21(AGND) RN5.1 SW5.3(GND) XTL5.2(GND) XTL5.4(GND2) ; also sheet 1,2,3,4,5,6,7,9,10,11,12,13,14,15,16,17,18,19
N5_5V: C17.1 H7.2 IC5.4(VCC) IC5.6(VCC) IC5.18(AVCC) IC5.20(AREF) LED6.5(A-R) LED6.6(A-G) Q9.1(G) Q10.1(G) R24.2 R27.2 R28.2 SW5.1(D)
N5_A4_SDA: IC5.27(PC4(ADC4/SDA)) Q9.2(S) R27.1
N5_A5_SCL: IC5.28(PC5(ADC5/SCL)) Q10.2(S) R28.1
N5_D0_RX: IC5.30(PD0(RXD)) RN5.4 ; also sheet 2
N5_D1_TX: IC5.31(PD1(TXD)) RN5.2 ; also sheet 2
N5_D11_MOSI: H7.4 IC5.15(PB3(MOSI/OC2))
N5_D12_MISO: H7.1 IC5.16(PB4(MISO))
N5_D13_SCK: H7.3 IC5.17(PB5(SCK)) LED6.4(A-B)
N5_RESET: H7.5 IC5.29(PC6(/RESET)) R24.1
N$2942: C16.2 IC5.8(PB7(XTAL2/TOSC2)) R25.1 XTL5.3(XTL2)
N$2943: C15.2 IC5.7(PB6(XTAL1/TOSC1)) R25.2 XTL5.1(XTL1)
N$2944: LED6.2(C-R) RN5.7
N$2945: LED6.1(C-B) RN5.8
N$2946: LED6.3(C-G) RN5.5
SCL: Q10.3(D) ; also sheet 1,2,3,4,5,6,7,9,10,11,12,13,14,15,16,17,18,19
SDA: Q9.3(D) ; also sheet 1,2,3,4,5,6,7,9,10,11,12,13,14,15,16,17,18,19
Unconnected: IC5.1(PD3(INT1)) IC5.2(PD4(XCK/T0)) IC5.9(PD5(T1)) IC5.10(PD6(AIN0)) IC5.11(PD7(AIN1)) IC5.12(PB0(ICP)) IC5.13(PB1(OC1A)) IC5.14(PB2(SS/OC1B)) IC5.19(ADC6) IC5.22(ADC7) IC5.23(PC0(ADC0)) IC5.24(PC1(ADC1)) IC5.25(PC2(ADC2)) IC5.26(PC3(ADC3)) IC5.32(PD2(INT0)) RN5.3 RN5.6 SW5.5(NC)

### Notes on the sheet
- Payload Processor Node 5
- Power Control | ATmega328P Microcontroller | I2C Isolation
- SMD3225-16MHZ 3.2 x 2.5mm crystal
- Status Display

## Sheet 9 of 19
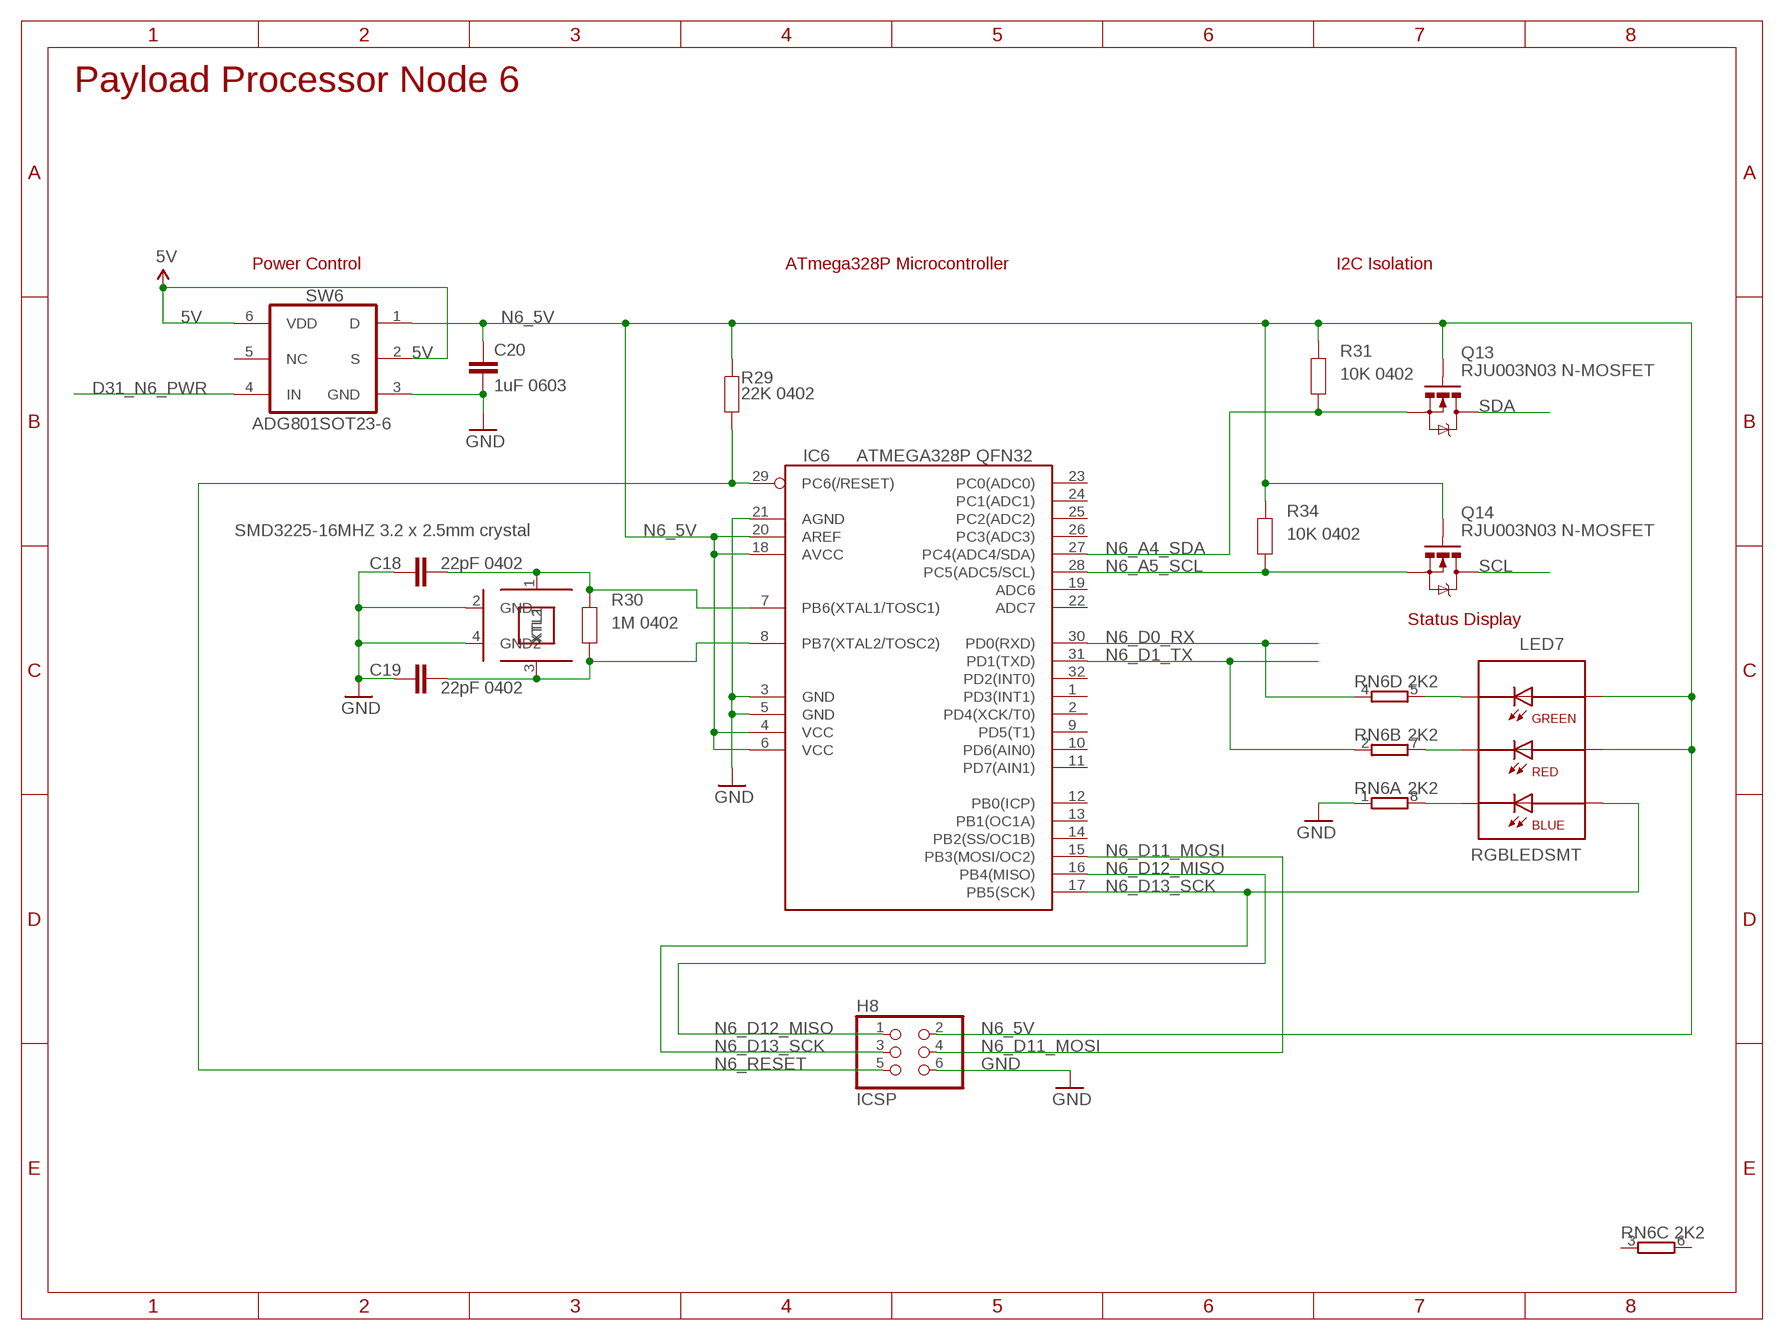
[diagram p8: schematic, sheet 9]

### Parts
C18  22pF 0402  C-EU0402C  [0402C]
C19  22pF 0402  C-EU0402C  [0402C]
C20  1uF 0603  C-EUC0603  [C0603]
H8  ICSP  ICSP2X3-2MM  [M2X3-2MM]
IC6  ATMEGA328P QFN32  AVR-MEGA8-MI  [MLF32]
LED7  RGBLEDSMT  [19-337]
Q13  RJU003N03 N-MOSFET  MOSFET-NSOT-323  [SOT32-3]
Q14  RJU003N03 N-MOSFET  MOSFET-NSOT-323  [SOT32-3]
R29  22K 0402  RESISTOR0402  [0402]
R30  1M 0402  RESISTOR0402  [0402]
R31  10K 0402  RESISTOR0402  [0402]
R34  10K 0402  RESISTOR0402  [0402]
RN6  2K2  4R-NCAY16  [CAY16]
SW6  ADG801SOT23-6  [SOT23-6]
XTL6  SMD3225-16MHZ 3.2 x 2.5mm crystal  CRYSTAL-GND3X2  [CRYSTAL-SMD-3X2]

### Nets
5V: SW6.2(S) SW6.6(VDD) ; also sheet 1,2,3,4,5,6,7,8,10,11,12,13,14,15,16,17,18,19
D31_N6_PWR: SW6.4(IN) ; also sheet 2
GND: C18.1 C19.1 C20.2 H8.6 IC6.3(GND) IC6.5(GND) IC6.21(AGND) RN6.1 SW6.3(GND) XTL6.2(GND) XTL6.4(GND2) ; also sheet 1,2,3,4,5,6,7,8,10,11,12,13,14,15,16,17,18,19
N6_5V: C20.1 H8.2 IC6.4(VCC) IC6.6(VCC) IC6.18(AVCC) IC6.20(AREF) LED7.5(A-R) LED7.6(A-G) Q13.1(G) Q14.1(G) R29.2 R31.2 R34.2 SW6.1(D)
N6_A4_SDA: IC6.27(PC4(ADC4/SDA)) Q13.2(S) R31.1
N6_A5_SCL: IC6.28(PC5(ADC5/SCL)) Q14.2(S) R34.1
N6_D0_RX: IC6.30(PD0(RXD)) RN6.4 ; also sheet 2
N6_D1_TX: IC6.31(PD1(TXD)) RN6.2 ; also sheet 2
N6_D11_MOSI: H8.4 IC6.15(PB3(MOSI/OC2))
N6_D12_MISO: H8.1 IC6.16(PB4(MISO))
N6_D13_SCK: H8.3 IC6.17(PB5(SCK)) LED7.4(A-B)
N6_RESET: H8.5 IC6.29(PC6(/RESET)) R29.1
N$3530: C19.2 IC6.8(PB7(XTAL2/TOSC2)) R30.1 XTL6.3(XTL2)
N$3531: C18.2 IC6.7(PB6(XTAL1/TOSC1)) R30.2 XTL6.1(XTL1)
N$3532: LED7.2(C-R) RN6.7
N$3533: LED7.1(C-B) RN6.8
N$3534: LED7.3(C-G) RN6.5
SCL: Q14.3(D) ; also sheet 1,2,3,4,5,6,7,8,10,11,12,13,14,15,16,17,18,19
SDA: Q13.3(D) ; also sheet 1,2,3,4,5,6,7,8,10,11,12,13,14,15,16,17,18,19
Unconnected: IC6.1(PD3(INT1)) IC6.2(PD4(XCK/T0)) IC6.9(PD5(T1)) IC6.10(PD6(AIN0)) IC6.11(PD7(AIN1)) IC6.12(PB0(ICP)) IC6.13(PB1(OC1A)) IC6.14(PB2(SS/OC1B)) IC6.19(ADC6) IC6.22(ADC7) IC6.23(PC0(ADC0)) IC6.24(PC1(ADC1)) IC6.25(PC2(ADC2)) IC6.26(PC3(ADC3)) IC6.32(PD2(INT0)) RN6.3 RN6.6 SW6.5(NC)

### Notes on the sheet
- Payload Processor Node 6
- Power Control | ATmega328P Microcontroller | I2C Isolation
- SMD3225-16MHZ 3.2 x 2.5mm crystal
- Status Display

## Sheet 10 of 19
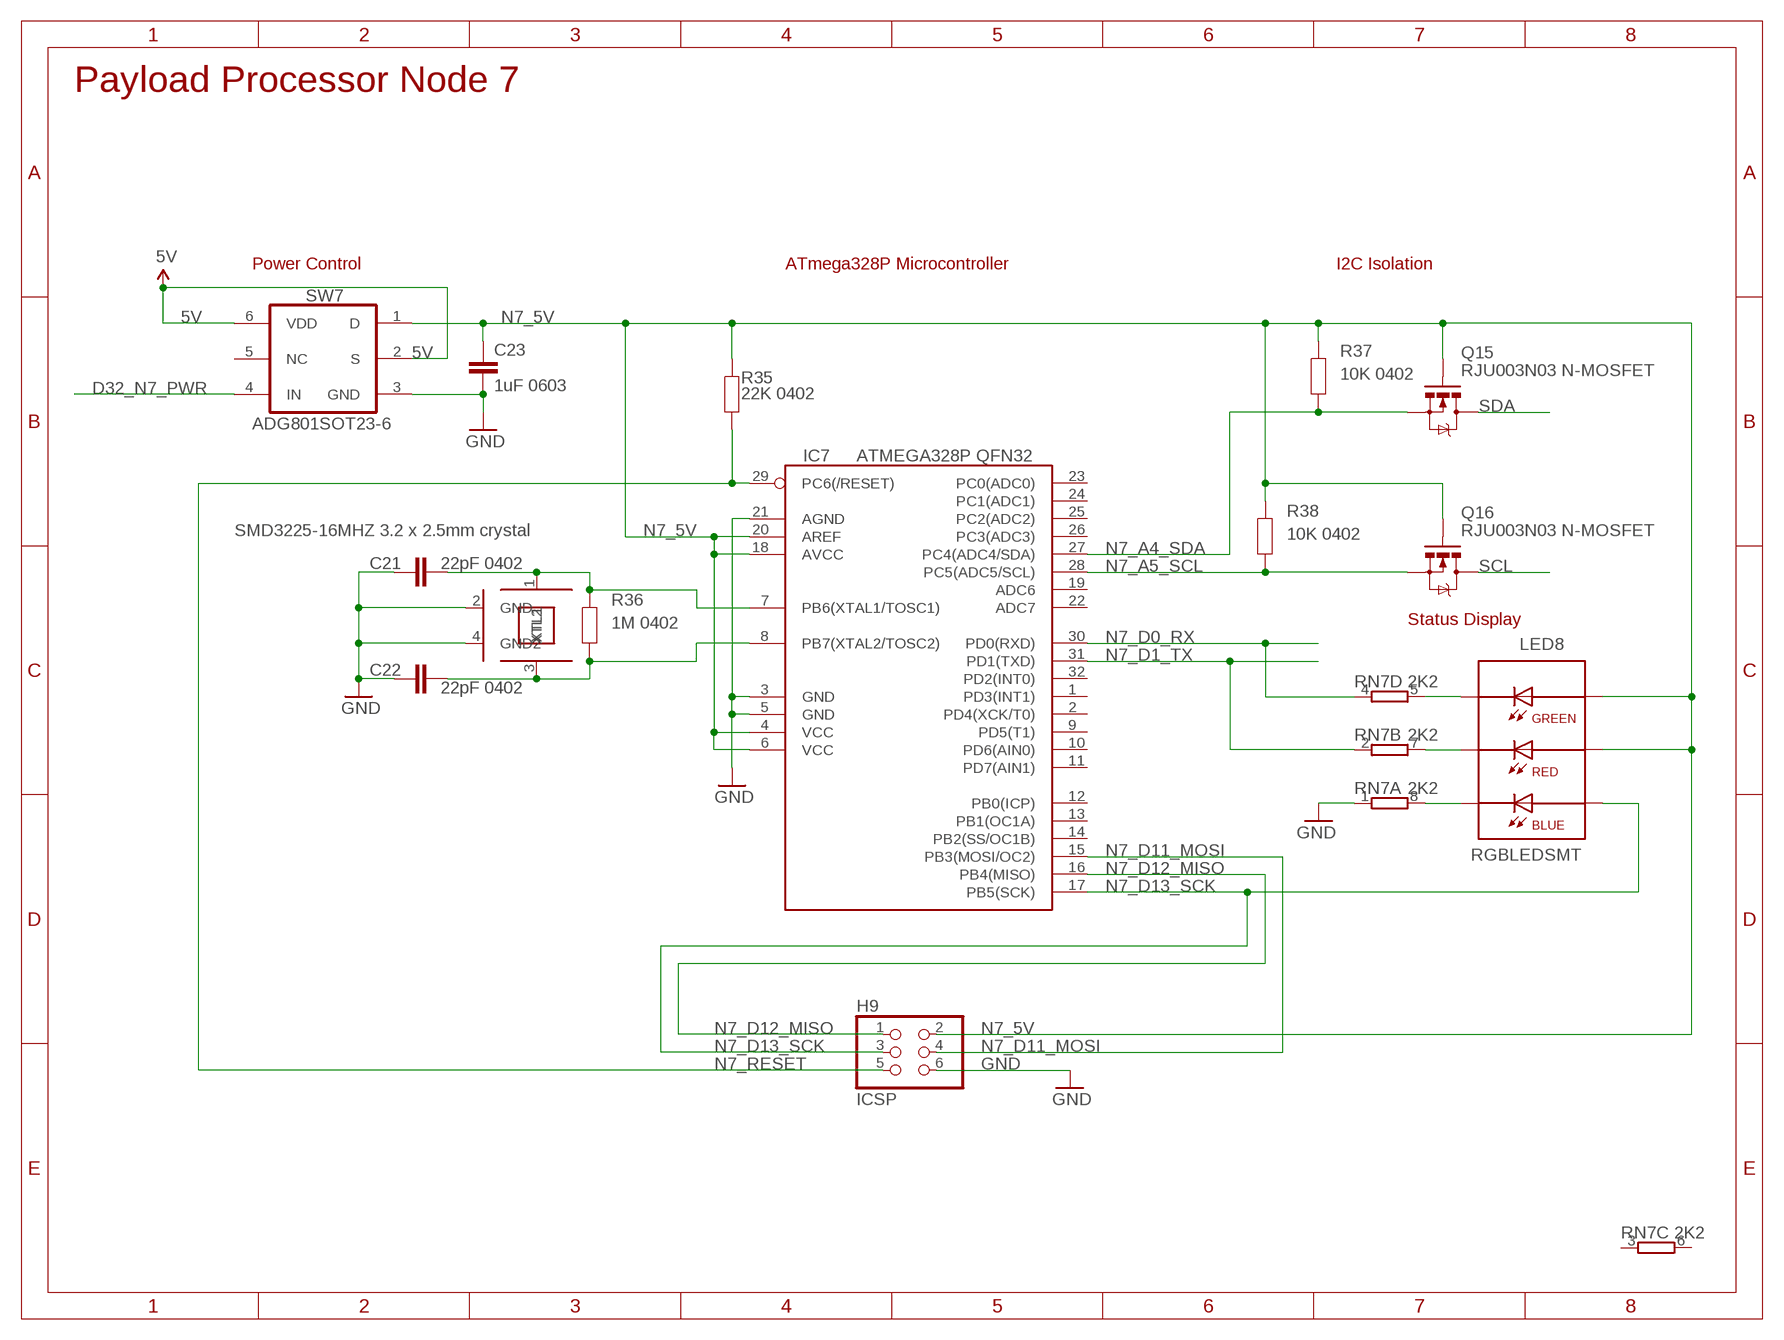
[diagram p9: schematic, sheet 10]

### Parts
C21  22pF 0402  C-EU0402C  [0402C]
C22  22pF 0402  C-EU0402C  [0402C]
C23  1uF 0603  C-EUC0603  [C0603]
H9  ICSP  ICSP2X3-2MM  [M2X3-2MM]
IC7  ATMEGA328P QFN32  AVR-MEGA8-MI  [MLF32]
LED8  RGBLEDSMT  [19-337]
Q15  RJU003N03 N-MOSFET  MOSFET-NSOT-323  [SOT32-3]
Q16  RJU003N03 N-MOSFET  MOSFET-NSOT-323  [SOT32-3]
R35  22K 0402  RESISTOR0402  [0402]
R36  1M 0402  RESISTOR0402  [0402]
R37  10K 0402  RESISTOR0402  [0402]
R38  10K 0402  RESISTOR0402  [0402]
RN7  2K2  4R-NCAY16  [CAY16]
SW7  ADG801SOT23-6  [SOT23-6]
XTL7  SMD3225-16MHZ 3.2 x 2.5mm crystal  CRYSTAL-GND3X2  [CRYSTAL-SMD-3X2]

### Nets
5V: SW7.2(S) SW7.6(VDD) ; also sheet 1,2,3,4,5,6,7,8,9,11,12,13,14,15,16,17,18,19
D32_N7_PWR: SW7.4(IN) ; also sheet 2
GND: C21.1 C22.1 C23.2 H9.6 IC7.3(GND) IC7.5(GND) IC7.21(AGND) RN7.1 SW7.3(GND) XTL7.2(GND) XTL7.4(GND2) ; also sheet 1,2,3,4,5,6,7,8,9,11,12,13,14,15,16,17,18,19
N7_5V: C23.1 H9.2 IC7.4(VCC) IC7.6(VCC) IC7.18(AVCC) IC7.20(AREF) LED8.5(A-R) LED8.6(A-G) Q15.1(G) Q16.1(G) R35.2 R37.2 R38.2 SW7.1(D)
N7_A4_SDA: IC7.27(PC4(ADC4/SDA)) Q15.2(S) R37.1
N7_A5_SCL: IC7.28(PC5(ADC5/SCL)) Q16.2(S) R38.1
N7_D0_RX: IC7.30(PD0(RXD)) RN7.4 ; also sheet 2
N7_D1_TX: IC7.31(PD1(TXD)) RN7.2 ; also sheet 2
N7_D11_MOSI: H9.4 IC7.15(PB3(MOSI/OC2))
N7_D12_MISO: H9.1 IC7.16(PB4(MISO))
N7_D13_SCK: H9.3 IC7.17(PB5(SCK)) LED8.4(A-B)
N7_RESET: H9.5 IC7.29(PC6(/RESET)) R35.1
N$4118: C22.2 IC7.8(PB7(XTAL2/TOSC2)) R36.1 XTL7.3(XTL2)
N$4119: C21.2 IC7.7(PB6(XTAL1/TOSC1)) R36.2 XTL7.1(XTL1)
N$4120: LED8.2(C-R) RN7.7
N$4121: LED8.1(C-B) RN7.8
N$4122: LED8.3(C-G) RN7.5
SCL: Q16.3(D) ; also sheet 1,2,3,4,5,6,7,8,9,11,12,13,14,15,16,17,18,19
SDA: Q15.3(D) ; also sheet 1,2,3,4,5,6,7,8,9,11,12,13,14,15,16,17,18,19
Unconnected: IC7.1(PD3(INT1)) IC7.2(PD4(XCK/T0)) IC7.9(PD5(T1)) IC7.10(PD6(AIN0)) IC7.11(PD7(AIN1)) IC7.12(PB0(ICP)) IC7.13(PB1(OC1A)) IC7.14(PB2(SS/OC1B)) IC7.19(ADC6) IC7.22(ADC7) IC7.23(PC0(ADC0)) IC7.24(PC1(ADC1)) IC7.25(PC2(ADC2)) IC7.26(PC3(ADC3)) IC7.32(PD2(INT0)) RN7.3 RN7.6 SW7.5(NC)

### Notes on the sheet
- Payload Processor Node 7
- Power Control | ATmega328P Microcontroller | I2C Isolation
- SMD3225-16MHZ 3.2 x 2.5mm crystal
- Status Display

## Sheet 11 of 19
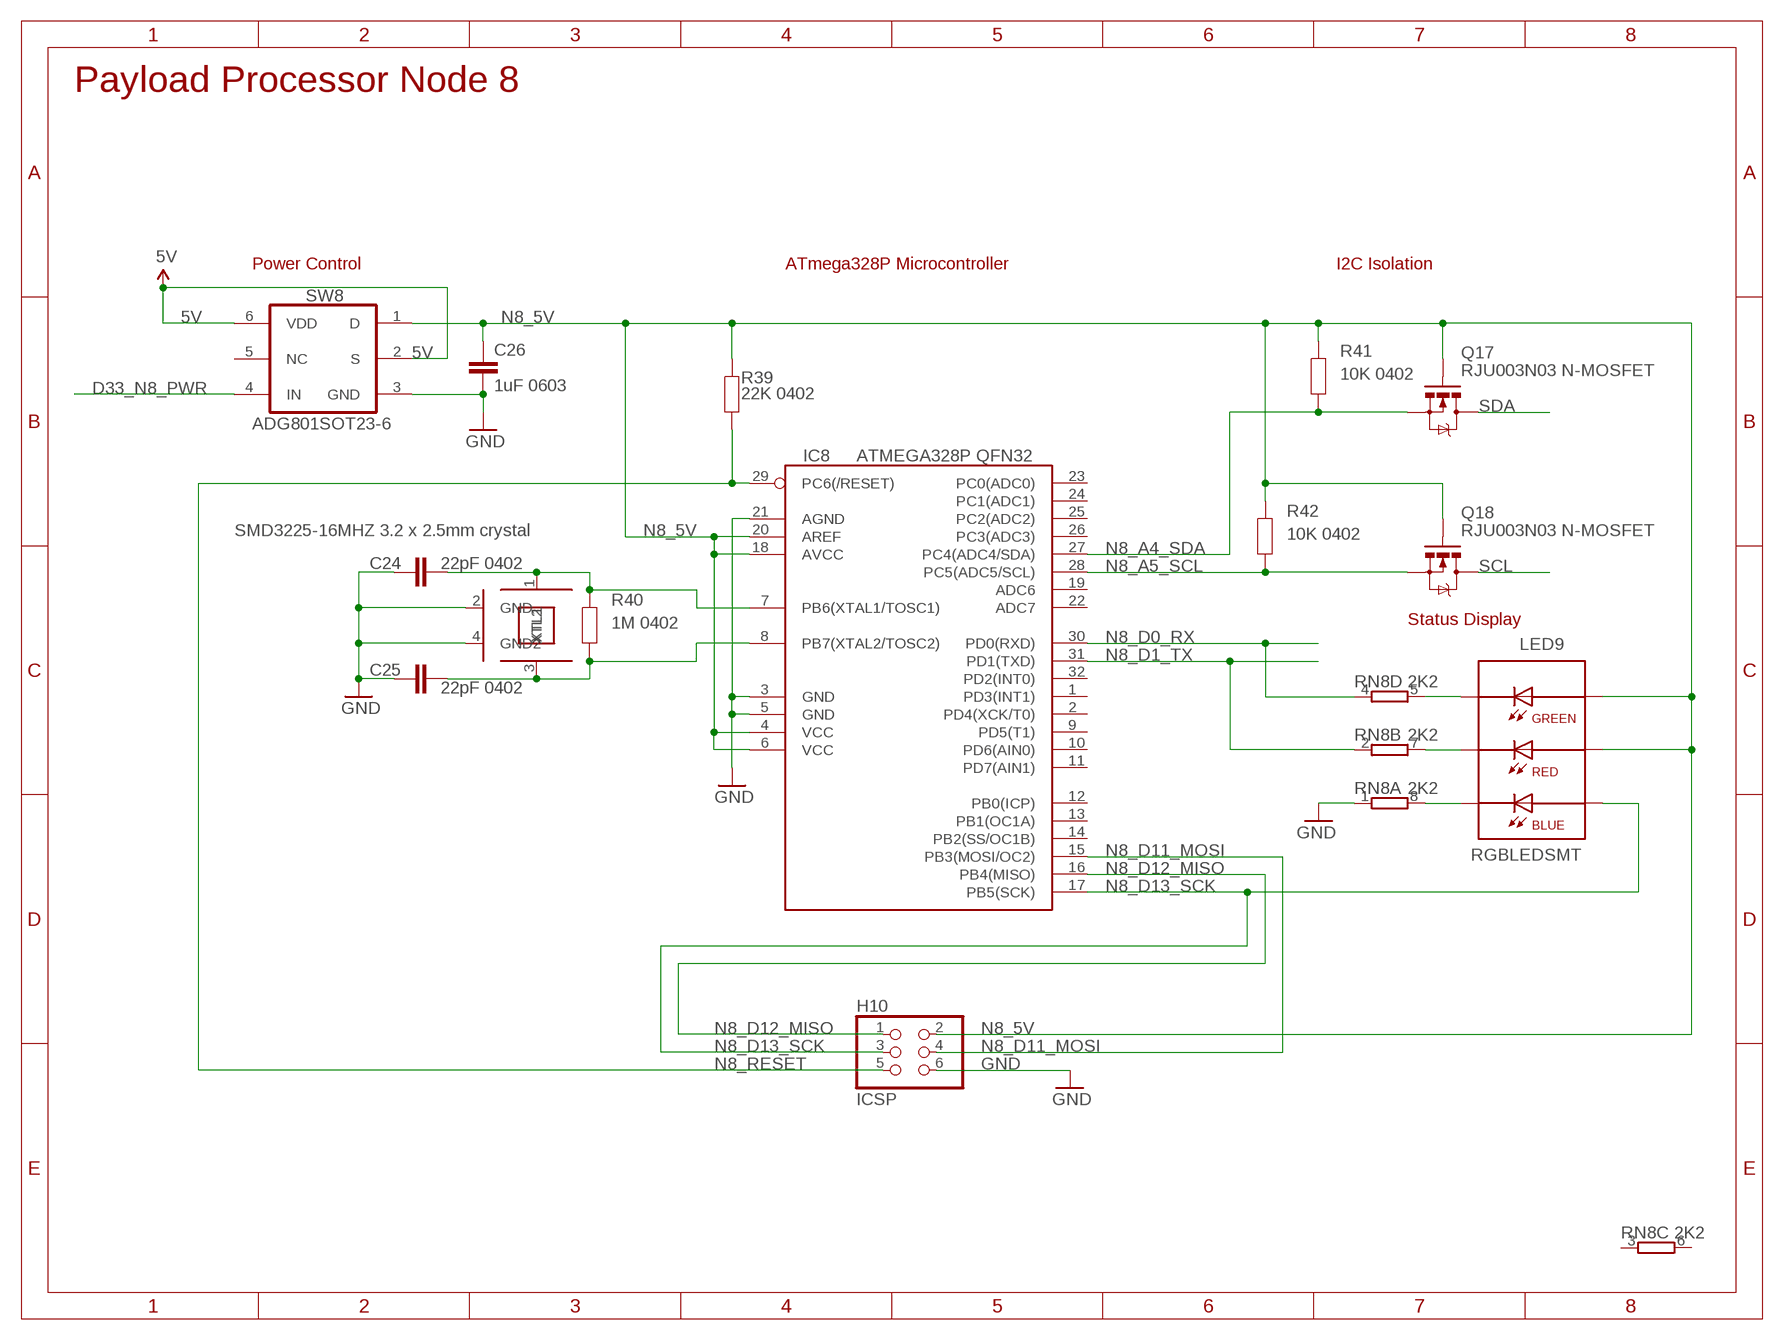
[diagram p10: schematic, sheet 11]

### Parts
C24  22pF 0402  C-EU0402C  [0402C]
C25  22pF 0402  C-EU0402C  [0402C]
C26  1uF 0603  C-EUC0603  [C0603]
H10  ICSP  ICSP2X3-2MM  [M2X3-2MM]
IC8  ATMEGA328P QFN32  AVR-MEGA8-MI  [MLF32]
LED9  RGBLEDSMT  [19-337]
Q17  RJU003N03 N-MOSFET  MOSFET-NSOT-323  [SOT32-3]
Q18  RJU003N03 N-MOSFET  MOSFET-NSOT-323  [SOT32-3]
R39  22K 0402  RESISTOR0402  [0402]
R40  1M 0402  RESISTOR0402  [0402]
R41  10K 0402  RESISTOR0402  [0402]
R42  10K 0402  RESISTOR0402  [0402]
RN8  2K2  4R-NCAY16  [CAY16]
SW8  ADG801SOT23-6  [SOT23-6]
XTL8  SMD3225-16MHZ 3.2 x 2.5mm crystal  CRYSTAL-GND3X2  [CRYSTAL-SMD-3X2]

### Nets
5V: SW8.2(S) SW8.6(VDD) ; also sheet 1,2,3,4,5,6,7,8,9,10,12,13,14,15,16,17,18,19
D33_N8_PWR: SW8.4(IN) ; also sheet 2
GND: C24.1 C25.1 C26.2 H10.6 IC8.3(GND) IC8.5(GND) IC8.21(AGND) RN8.1 SW8.3(GND) XTL8.2(GND) XTL8.4(GND2) ; also sheet 1,2,3,4,5,6,7,8,9,10,12,13,14,15,16,17,18,19
N8_5V: C26.1 H10.2 IC8.4(VCC) IC8.6(VCC) IC8.18(AVCC) IC8.20(AREF) LED9.5(A-R) LED9.6(A-G) Q17.1(G) Q18.1(G) R39.2 R41.2 R42.2 SW8.1(D)
N8_A4_SDA: IC8.27(PC4(ADC4/SDA)) Q17.2(S) R41.1
N8_A5_SCL: IC8.28(PC5(ADC5/SCL)) Q18.2(S) R42.1
N8_D0_RX: IC8.30(PD0(RXD)) RN8.4 ; also sheet 2
N8_D1_TX: IC8.31(PD1(TXD)) RN8.2 ; also sheet 2
N8_D11_MOSI: H10.4 IC8.15(PB3(MOSI/OC2))
N8_D12_MISO: H10.1 IC8.16(PB4(MISO))
N8_D13_SCK: H10.3 IC8.17(PB5(SCK)) LED9.4(A-B)
N8_RESET: H10.5 IC8.29(PC6(/RESET)) R39.1
N$4706: C25.2 IC8.8(PB7(XTAL2/TOSC2)) R40.1 XTL8.3(XTL2)
N$4707: C24.2 IC8.7(PB6(XTAL1/TOSC1)) R40.2 XTL8.1(XTL1)
N$4708: LED9.2(C-R) RN8.7
N$4709: LED9.1(C-B) RN8.8
N$4710: LED9.3(C-G) RN8.5
SCL: Q18.3(D) ; also sheet 1,2,3,4,5,6,7,8,9,10,12,13,14,15,16,17,18,19
SDA: Q17.3(D) ; also sheet 1,2,3,4,5,6,7,8,9,10,12,13,14,15,16,17,18,19
Unconnected: IC8.1(PD3(INT1)) IC8.2(PD4(XCK/T0)) IC8.9(PD5(T1)) IC8.10(PD6(AIN0)) IC8.11(PD7(AIN1)) IC8.12(PB0(ICP)) IC8.13(PB1(OC1A)) IC8.14(PB2(SS/OC1B)) IC8.19(ADC6) IC8.22(ADC7) IC8.23(PC0(ADC0)) IC8.24(PC1(ADC1)) IC8.25(PC2(ADC2)) IC8.26(PC3(ADC3)) IC8.32(PD2(INT0)) RN8.3 RN8.6 SW8.5(NC)

### Notes on the sheet
- Payload Processor Node 8
- Power Control | ATmega328P Microcontroller | I2C Isolation
- SMD3225-16MHZ 3.2 x 2.5mm crystal
- Status Display

## Sheet 12 of 19
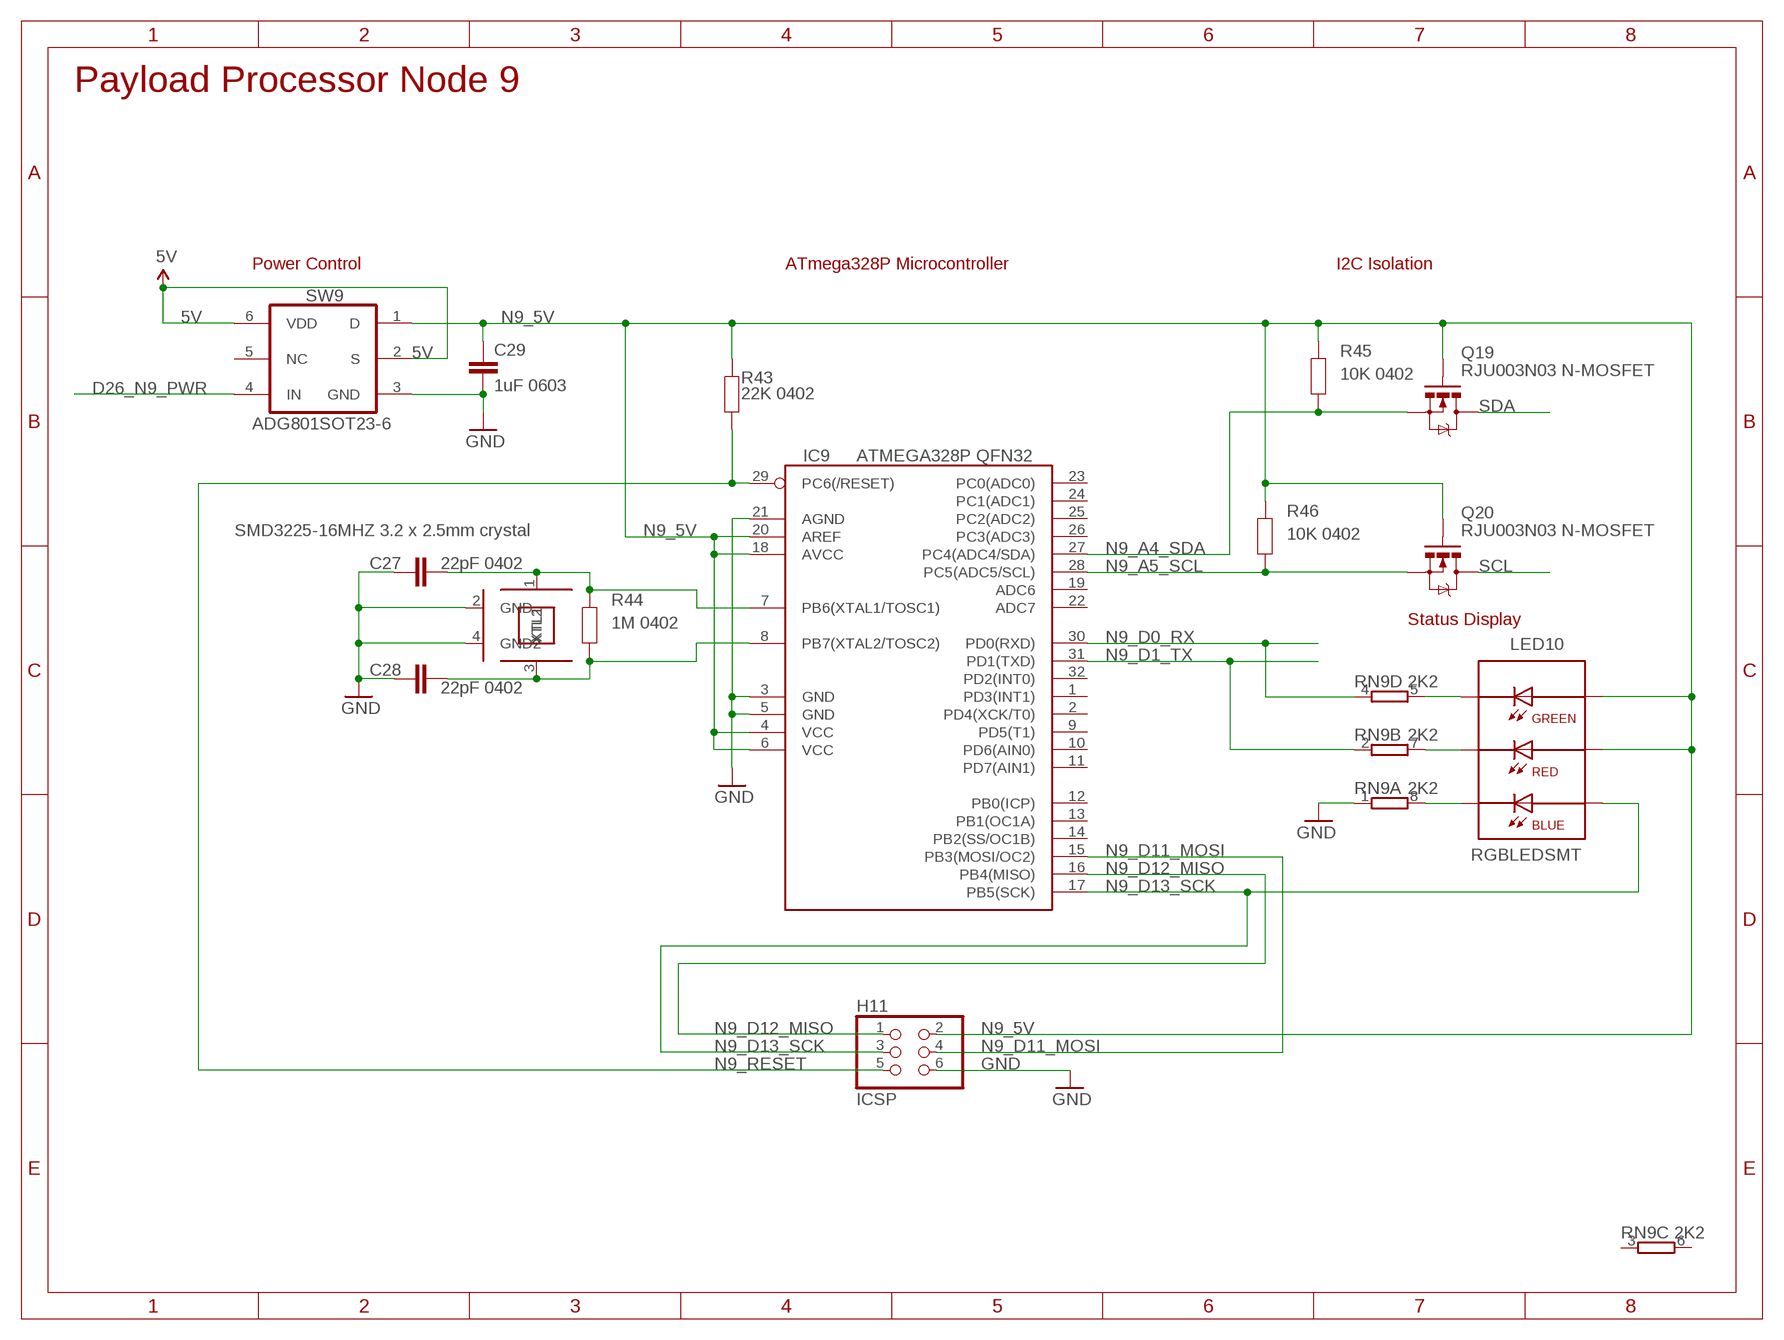
[diagram p11: schematic, sheet 12]

### Parts
C27  22pF 0402  C-EU0402C  [0402C]
C28  22pF 0402  C-EU0402C  [0402C]
C29  1uF 0603  C-EUC0603  [C0603]
H11  ICSP  ICSP2X3-2MM  [M2X3-2MM]
IC9  ATMEGA328P QFN32  AVR-MEGA8-MI  [MLF32]
LED10  RGBLEDSMT  [19-337]
Q19  RJU003N03 N-MOSFET  MOSFET-NSOT-323  [SOT32-3]
Q20  RJU003N03 N-MOSFET  MOSFET-NSOT-323  [SOT32-3]
R43  22K 0402  RESISTOR0402  [0402]
R44  1M 0402  RESISTOR0402  [0402]
R45  10K 0402  RESISTOR0402  [0402]
R46  10K 0402  RESISTOR0402  [0402]
RN9  2K2  4R-NCAY16  [CAY16]
SW9  ADG801SOT23-6  [SOT23-6]
XTL9  SMD3225-16MHZ 3.2 x 2.5mm crystal  CRYSTAL-GND3X2  [CRYSTAL-SMD-3X2]

### Nets
5V: SW9.2(S) SW9.6(VDD) ; also sheet 1,2,3,4,5,6,7,8,9,10,11,13,14,15,16,17,18,19
D26_N9_PWR: SW9.4(IN) ; also sheet 2
GND: C27.1 C28.1 C29.2 H11.6 IC9.3(GND) IC9.5(GND) IC9.21(AGND) RN9.1 SW9.3(GND) XTL9.2(GND) XTL9.4(GND2) ; also sheet 1,2,3,4,5,6,7,8,9,10,11,13,14,15,16,17,18,19
N9_5V: C29.1 H11.2 IC9.4(VCC) IC9.6(VCC) IC9.18(AVCC) IC9.20(AREF) LED10.5(A-R) LED10.6(A-G) Q19.1(G) Q20.1(G) R43.2 R45.2 R46.2 SW9.1(D)
N9_A4_SDA: IC9.27(PC4(ADC4/SDA)) Q19.2(S) R45.1
N9_A5_SCL: IC9.28(PC5(ADC5/SCL)) Q20.2(S) R46.1
N9_D0_RX: IC9.30(PD0(RXD)) RN9.4 ; also sheet 2
N9_D1_TX: IC9.31(PD1(TXD)) RN9.2 ; also sheet 2
N9_D11_MOSI: H11.4 IC9.15(PB3(MOSI/OC2))
N9_D12_MISO: H11.1 IC9.16(PB4(MISO))
N9_D13_SCK: H11.3 IC9.17(PB5(SCK)) LED10.4(A-B)
N9_RESET: H11.5 IC9.29(PC6(/RESET)) R43.1
N$5294: C28.2 IC9.8(PB7(XTAL2/TOSC2)) R44.1 XTL9.3(XTL2)
N$5295: C27.2 IC9.7(PB6(XTAL1/TOSC1)) R44.2 XTL9.1(XTL1)
N$5296: LED10.2(C-R) RN9.7
N$5297: LED10.1(C-B) RN9.8
N$5298: LED10.3(C-G) RN9.5
SCL: Q20.3(D) ; also sheet 1,2,3,4,5,6,7,8,9,10,11,13,14,15,16,17,18,19
SDA: Q19.3(D) ; also sheet 1,2,3,4,5,6,7,8,9,10,11,13,14,15,16,17,18,19
Unconnected: IC9.1(PD3(INT1)) IC9.2(PD4(XCK/T0)) IC9.9(PD5(T1)) IC9.10(PD6(AIN0)) IC9.11(PD7(AIN1)) IC9.12(PB0(ICP)) IC9.13(PB1(OC1A)) IC9.14(PB2(SS/OC1B)) IC9.19(ADC6) IC9.22(ADC7) IC9.23(PC0(ADC0)) IC9.24(PC1(ADC1)) IC9.25(PC2(ADC2)) IC9.26(PC3(ADC3)) IC9.32(PD2(INT0)) RN9.3 RN9.6 SW9.5(NC)

### Notes on the sheet
- Payload Processor Node 9
- Power Control | ATmega328P Microcontroller | I2C Isolation
- SMD3225-16MHZ 3.2 x 2.5mm crystal
- Status Display

## Sheet 13 of 19
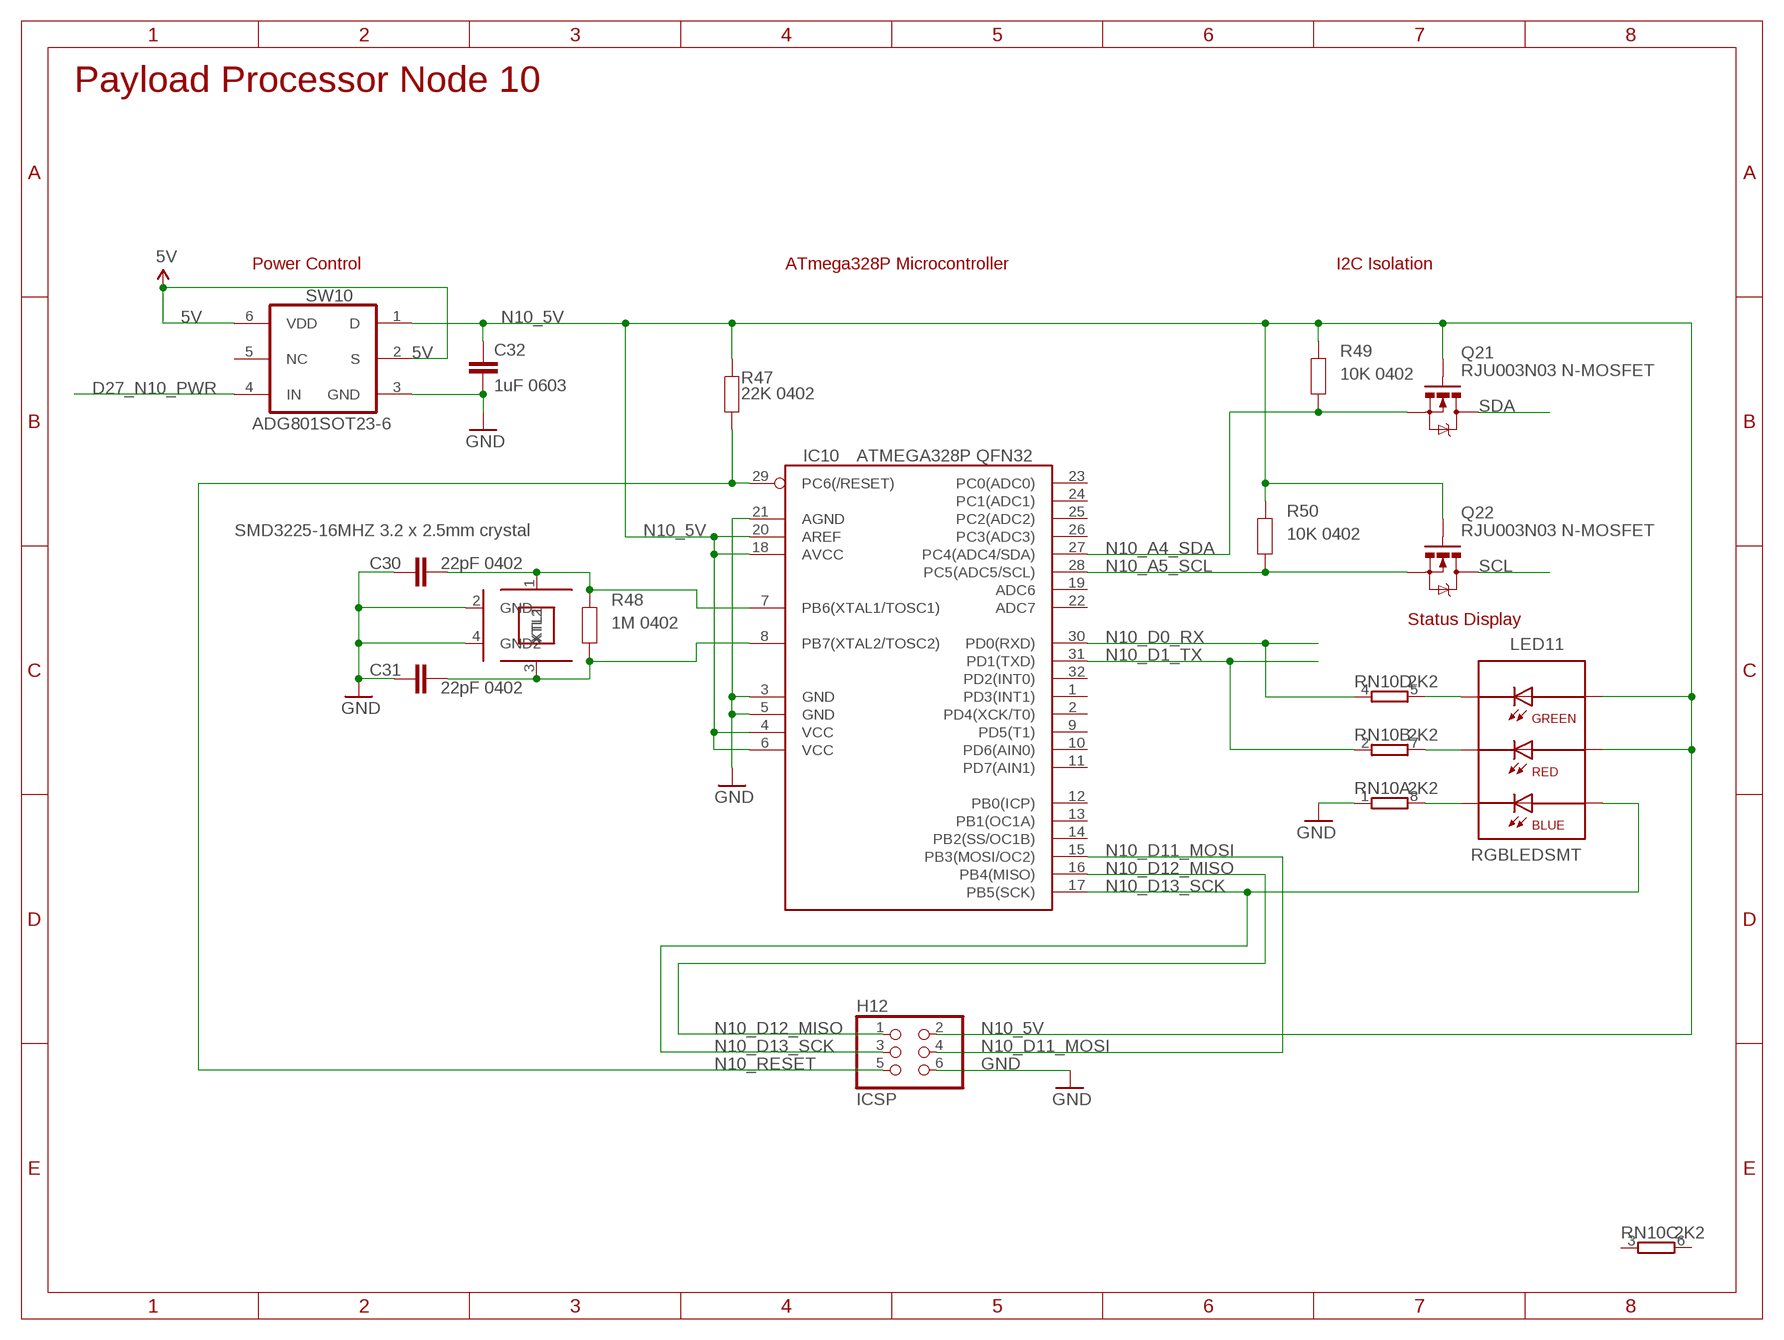
[diagram p12: schematic, sheet 13]

### Parts
C30  22pF 0402  C-EU0402C  [0402C]
C31  22pF 0402  C-EU0402C  [0402C]
C32  1uF 0603  C-EUC0603  [C0603]
H12  ICSP  ICSP2X3-2MM  [M2X3-2MM]
IC10  ATMEGA328P QFN32  AVR-MEGA8-MI  [MLF32]
LED11  RGBLEDSMT  [19-337]
Q21  RJU003N03 N-MOSFET  MOSFET-NSOT-323  [SOT32-3]
Q22  RJU003N03 N-MOSFET  MOSFET-NSOT-323  [SOT32-3]
R47  22K 0402  RESISTOR0402  [0402]
R48  1M 0402  RESISTOR0402  [0402]
R49  10K 0402  RESISTOR0402  [0402]
R50  10K 0402  RESISTOR0402  [0402]
RN10  2K2  4R-NCAY16  [CAY16]
SW10  ADG801SOT23-6  [SOT23-6]
XTL10  SMD3225-16MHZ 3.2 x 2.5mm crystal  CRYSTAL-GND3X2  [CRYSTAL-SMD-3X2]

### Nets
5V: SW10.2(S) SW10.6(VDD) ; also sheet 1,2,3,4,5,6,7,8,9,10,11,12,14,15,16,17,18,19
D27_N10_PWR: SW10.4(IN) ; also sheet 2
GND: C30.1 C31.1 C32.2 H12.6 IC10.3(GND) IC10.5(GND) IC10.21(AGND) RN10.1 SW10.3(GND) XTL10.2(GND) XTL10.4(GND2) ; also sheet 1,2,3,4,5,6,7,8,9,10,11,12,14,15,16,17,18,19
N10_5V: C32.1 H12.2 IC10.4(VCC) IC10.6(VCC) IC10.18(AVCC) IC10.20(AREF) LED11.5(A-R) LED11.6(A-G) Q21.1(G) Q22.1(G) R47.2 R49.2 R50.2 SW10.1(D)
N10_A4_SDA: IC10.27(PC4(ADC4/SDA)) Q21.2(S) R49.1
N10_A5_SCL: IC10.28(PC5(ADC5/SCL)) Q22.2(S) R50.1
N10_D0_RX: IC10.30(PD0(RXD)) RN10.4 ; also sheet 2
N10_D1_TX: IC10.31(PD1(TXD)) RN10.2 ; also sheet 2
N10_D11_MOSI: H12.4 IC10.15(PB3(MOSI/OC2))
N10_D12_MISO: H12.1 IC10.16(PB4(MISO))
N10_D13_SCK: H12.3 IC10.17(PB5(SCK)) LED11.4(A-B)
N10_RESET: H12.5 IC10.29(PC6(/RESET)) R47.1
N$5882: C31.2 IC10.8(PB7(XTAL2/TOSC2)) R48.1 XTL10.3(XTL2)
N$5883: C30.2 IC10.7(PB6(XTAL1/TOSC1)) R48.2 XTL10.1(XTL1)
N$5884: LED11.2(C-R) RN10.7
N$5885: LED11.1(C-B) RN10.8
N$5886: LED11.3(C-G) RN10.5
SCL: Q22.3(D) ; also sheet 1,2,3,4,5,6,7,8,9,10,11,12,14,15,16,17,18,19
SDA: Q21.3(D) ; also sheet 1,2,3,4,5,6,7,8,9,10,11,12,14,15,16,17,18,19
Unconnected: IC10.1(PD3(INT1)) IC10.2(PD4(XCK/T0)) IC10.9(PD5(T1)) IC10.10(PD6(AIN0)) IC10.11(PD7(AIN1)) IC10.12(PB0(ICP)) IC10.13(PB1(OC1A)) IC10.14(PB2(SS/OC1B)) IC10.19(ADC6) IC10.22(ADC7) IC10.23(PC0(ADC0)) IC10.24(PC1(ADC1)) IC10.25(PC2(ADC2)) IC10.26(PC3(ADC3)) IC10.32(PD2(INT0)) RN10.3 RN10.6 SW10.5(NC)

### Notes on the sheet
- Payload Processor Node 10
- Power Control | ATmega328P Microcontroller | I2C Isolation
- SMD3225-16MHZ 3.2 x 2.5mm crystal
- Status Display

## Sheet 14 of 19
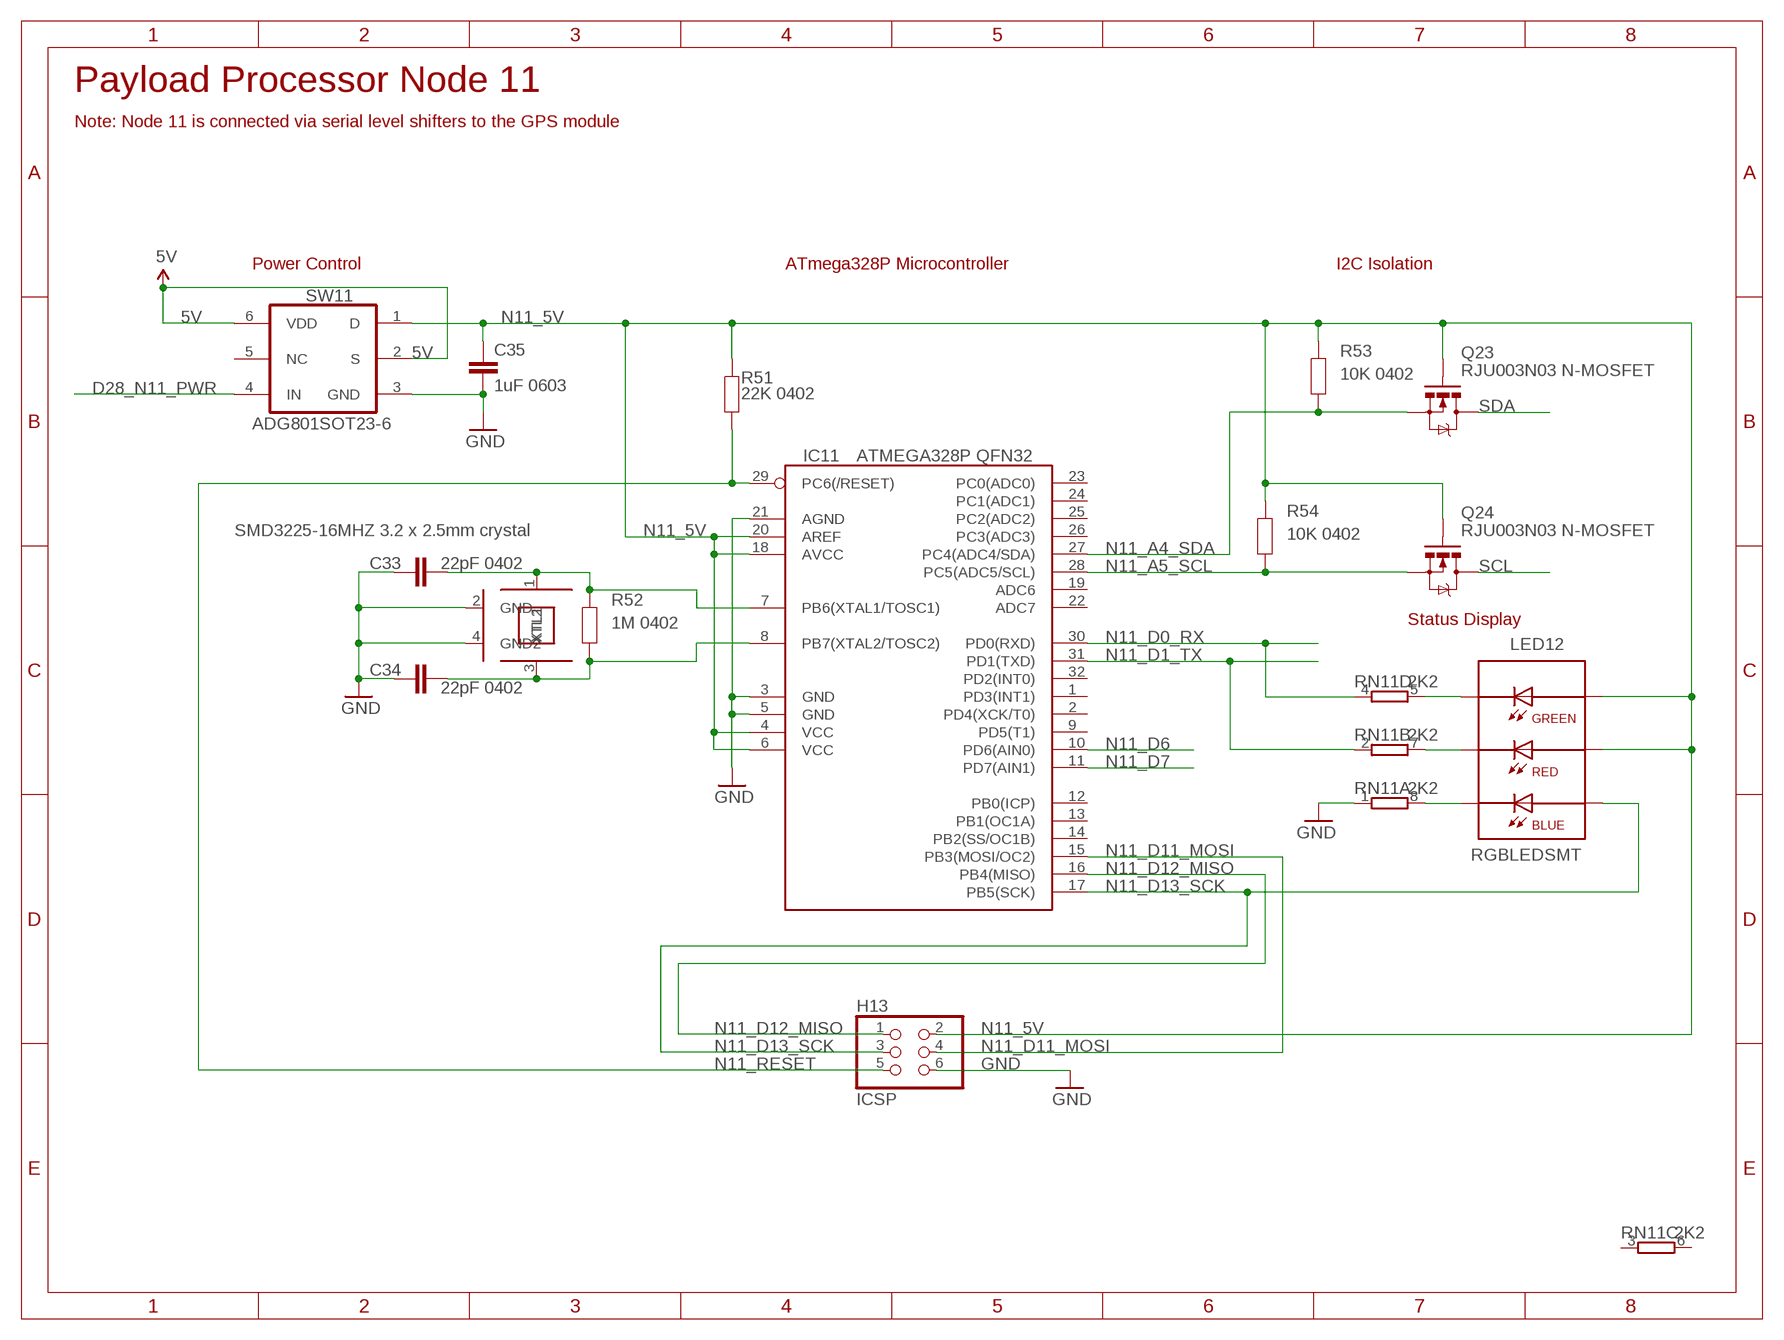
[diagram p13: schematic, sheet 14]

### Parts
C33  22pF 0402  C-EU0402C  [0402C]
C34  22pF 0402  C-EU0402C  [0402C]
C35  1uF 0603  C-EUC0603  [C0603]
H13  ICSP  ICSP2X3-2MM  [M2X3-2MM]
IC11  ATMEGA328P QFN32  AVR-MEGA8-MI  [MLF32]
LED12  RGBLEDSMT  [19-337]
Q23  RJU003N03 N-MOSFET  MOSFET-NSOT-323  [SOT32-3]
Q24  RJU003N03 N-MOSFET  MOSFET-NSOT-323  [SOT32-3]
R51  22K 0402  RESISTOR0402  [0402]
R52  1M 0402  RESISTOR0402  [0402]
R53  10K 0402  RESISTOR0402  [0402]
R54  10K 0402  RESISTOR0402  [0402]
RN11  2K2  4R-NCAY16  [CAY16]
SW11  ADG801SOT23-6  [SOT23-6]
XTL11  SMD3225-16MHZ 3.2 x 2.5mm crystal  CRYSTAL-GND3X2  [CRYSTAL-SMD-3X2]

### Nets
5V: SW11.2(S) SW11.6(VDD) ; also sheet 1,2,3,4,5,6,7,8,9,10,11,12,13,15,16,17,18,19
D28_N11_PWR: SW11.4(IN) ; also sheet 2
GND: C33.1 C34.1 C35.2 H13.6 IC11.3(GND) IC11.5(GND) IC11.21(AGND) RN11.1 SW11.3(GND) XTL11.2(GND) XTL11.4(GND2) ; also sheet 1,2,3,4,5,6,7,8,9,10,11,12,13,15,16,17,18,19
N11_5V: C35.1 H13.2 IC11.4(VCC) IC11.6(VCC) IC11.18(AVCC) IC11.20(AREF) LED12.5(A-R) LED12.6(A-G) Q23.1(G) Q24.1(G) R51.2 R53.2 R54.2 SW11.1(D) ; also sheet 3
N11_A4_SDA: IC11.27(PC4(ADC4/SDA)) Q23.2(S) R53.1
N11_A5_SCL: IC11.28(PC5(ADC5/SCL)) Q24.2(S) R54.1
N11_D0_RX: IC11.30(PD0(RXD)) RN11.4 ; also sheet 2
N11_D1_TX: IC11.31(PD1(TXD)) RN11.2 ; also sheet 2
N11_D6: IC11.10(PD6(AIN0)) ; also sheet 3
N11_D7: IC11.11(PD7(AIN1)) ; also sheet 3
N11_D11_MOSI: H13.4 IC11.15(PB3(MOSI/OC2))
N11_D12_MISO: H13.1 IC11.16(PB4(MISO))
N11_D13_SCK: H13.3 IC11.17(PB5(SCK)) LED12.4(A-B)
N11_RESET: H13.5 IC11.29(PC6(/RESET)) R51.1
N$6470: C34.2 IC11.8(PB7(XTAL2/TOSC2)) R52.1 XTL11.3(XTL2)
N$6471: C33.2 IC11.7(PB6(XTAL1/TOSC1)) R52.2 XTL11.1(XTL1)
N$6472: LED12.2(C-R) RN11.7
N$6473: LED12.1(C-B) RN11.8
N$6474: LED12.3(C-G) RN11.5
SCL: Q24.3(D) ; also sheet 1,2,3,4,5,6,7,8,9,10,11,12,13,15,16,17,18,19
SDA: Q23.3(D) ; also sheet 1,2,3,4,5,6,7,8,9,10,11,12,13,15,16,17,18,19
Unconnected: IC11.1(PD3(INT1)) IC11.2(PD4(XCK/T0)) IC11.9(PD5(T1)) IC11.12(PB0(ICP)) IC11.13(PB1(OC1A)) IC11.14(PB2(SS/OC1B)) IC11.19(ADC6) IC11.22(ADC7) IC11.23(PC0(ADC0)) IC11.24(PC1(ADC1)) IC11.25(PC2(ADC2)) IC11.26(PC3(ADC3)) IC11.32(PD2(INT0)) RN11.3 RN11.6 SW11.5(NC)

### Notes on the sheet
- Payload Processor Node 11
- Note: Node 11 is connected via serial level shifters to the GPS module
- Power Control | ATmega328P Microcontroller | I2C Isolation
- SMD3225-16MHZ 3.2 x 2.5mm crystal
- Status Display

## Sheet 15 of 19
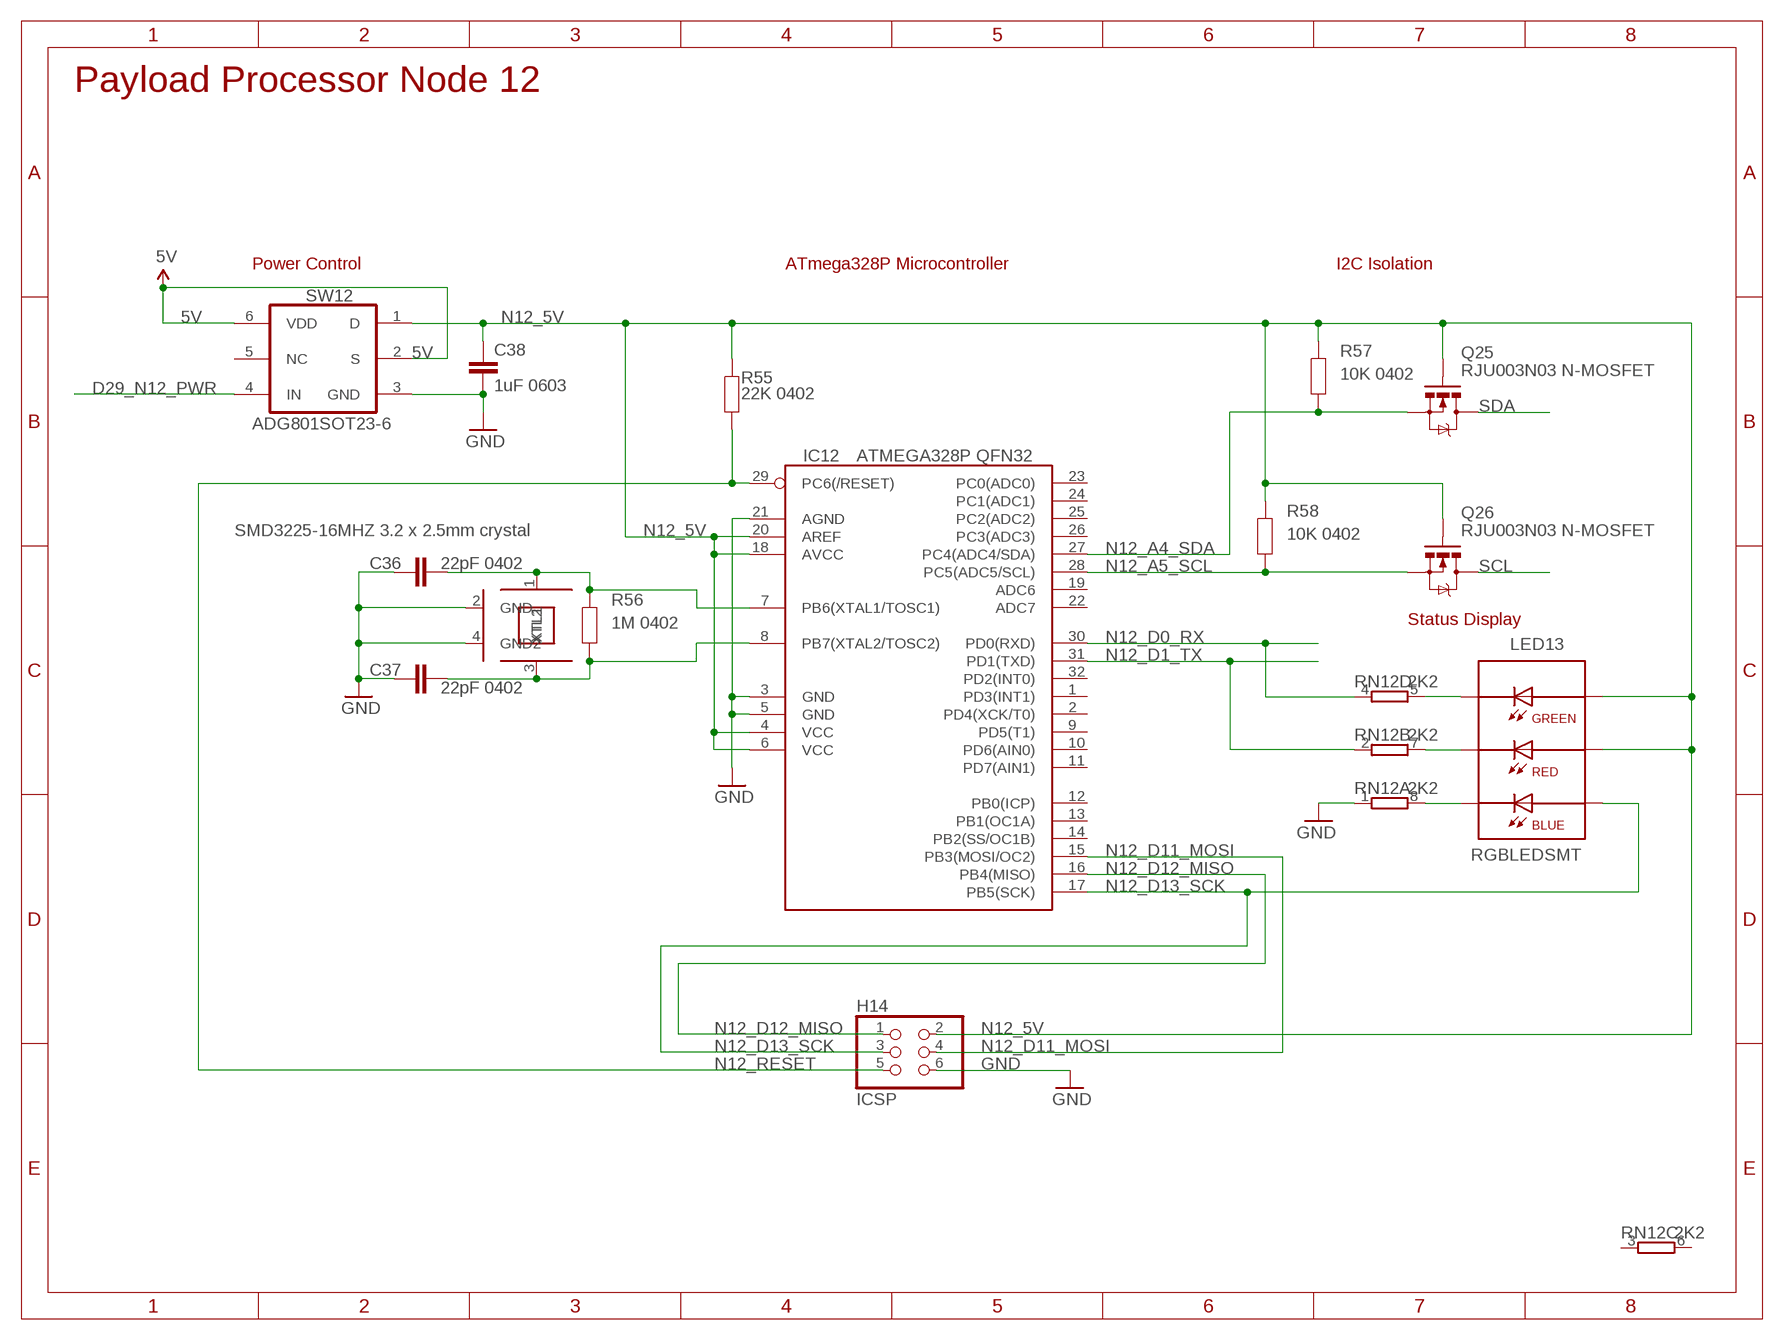
[diagram p14: schematic, sheet 15]

### Parts
C36  22pF 0402  C-EU0402C  [0402C]
C37  22pF 0402  C-EU0402C  [0402C]
C38  1uF 0603  C-EUC0603  [C0603]
H14  ICSP  ICSP2X3-2MM  [M2X3-2MM]
IC12  ATMEGA328P QFN32  AVR-MEGA8-MI  [MLF32]
LED13  RGBLEDSMT  [19-337]
Q25  RJU003N03 N-MOSFET  MOSFET-NSOT-323  [SOT32-3]
Q26  RJU003N03 N-MOSFET  MOSFET-NSOT-323  [SOT32-3]
R55  22K 0402  RESISTOR0402  [0402]
R56  1M 0402  RESISTOR0402  [0402]
R57  10K 0402  RESISTOR0402  [0402]
R58  10K 0402  RESISTOR0402  [0402]
RN12  2K2  4R-NCAY16  [CAY16]
SW12  ADG801SOT23-6  [SOT23-6]
XTL12  SMD3225-16MHZ 3.2 x 2.5mm crystal  CRYSTAL-GND3X2  [CRYSTAL-SMD-3X2]

### Nets
5V: SW12.2(S) SW12.6(VDD) ; also sheet 1,2,3,4,5,6,7,8,9,10,11,12,13,14,16,17,18,19
D29_N12_PWR: SW12.4(IN) ; also sheet 2
GND: C36.1 C37.1 C38.2 H14.6 IC12.3(GND) IC12.5(GND) IC12.21(AGND) RN12.1 SW12.3(GND) XTL12.2(GND) XTL12.4(GND2) ; also sheet 1,2,3,4,5,6,7,8,9,10,11,12,13,14,16,17,18,19
N12_5V: C38.1 H14.2 IC12.4(VCC) IC12.6(VCC) IC12.18(AVCC) IC12.20(AREF) LED13.5(A-R) LED13.6(A-G) Q25.1(G) Q26.1(G) R55.2 R57.2 R58.2 SW12.1(D)
N12_A4_SDA: IC12.27(PC4(ADC4/SDA)) Q25.2(S) R57.1
N12_A5_SCL: IC12.28(PC5(ADC5/SCL)) Q26.2(S) R58.1
N12_D0_RX: IC12.30(PD0(RXD)) RN12.4 ; also sheet 2
N12_D1_TX: IC12.31(PD1(TXD)) RN12.2 ; also sheet 2
N12_D11_MOSI: H14.4 IC12.15(PB3(MOSI/OC2))
N12_D12_MISO: H14.1 IC12.16(PB4(MISO))
N12_D13_SCK: H14.3 IC12.17(PB5(SCK)) LED13.4(A-B)
N12_RESET: H14.5 IC12.29(PC6(/RESET)) R55.1
N$7058: C37.2 IC12.8(PB7(XTAL2/TOSC2)) R56.1 XTL12.3(XTL2)
N$7059: C36.2 IC12.7(PB6(XTAL1/TOSC1)) R56.2 XTL12.1(XTL1)
N$7060: LED13.2(C-R) RN12.7
N$7061: LED13.1(C-B) RN12.8
N$7062: LED13.3(C-G) RN12.5
SCL: Q26.3(D) ; also sheet 1,2,3,4,5,6,7,8,9,10,11,12,13,14,16,17,18,19
SDA: Q25.3(D) ; also sheet 1,2,3,4,5,6,7,8,9,10,11,12,13,14,16,17,18,19
Unconnected: IC12.1(PD3(INT1)) IC12.2(PD4(XCK/T0)) IC12.9(PD5(T1)) IC12.10(PD6(AIN0)) IC12.11(PD7(AIN1)) IC12.12(PB0(ICP)) IC12.13(PB1(OC1A)) IC12.14(PB2(SS/OC1B)) IC12.19(ADC6) IC12.22(ADC7) IC12.23(PC0(ADC0)) IC12.24(PC1(ADC1)) IC12.25(PC2(ADC2)) IC12.26(PC3(ADC3)) IC12.32(PD2(INT0)) RN12.3 RN12.6 SW12.5(NC)

### Notes on the sheet
- Payload Processor Node 12
- Power Control | ATmega328P Microcontroller | I2C Isolation
- SMD3225-16MHZ 3.2 x 2.5mm crystal
- Status Display

## Sheet 16 of 19
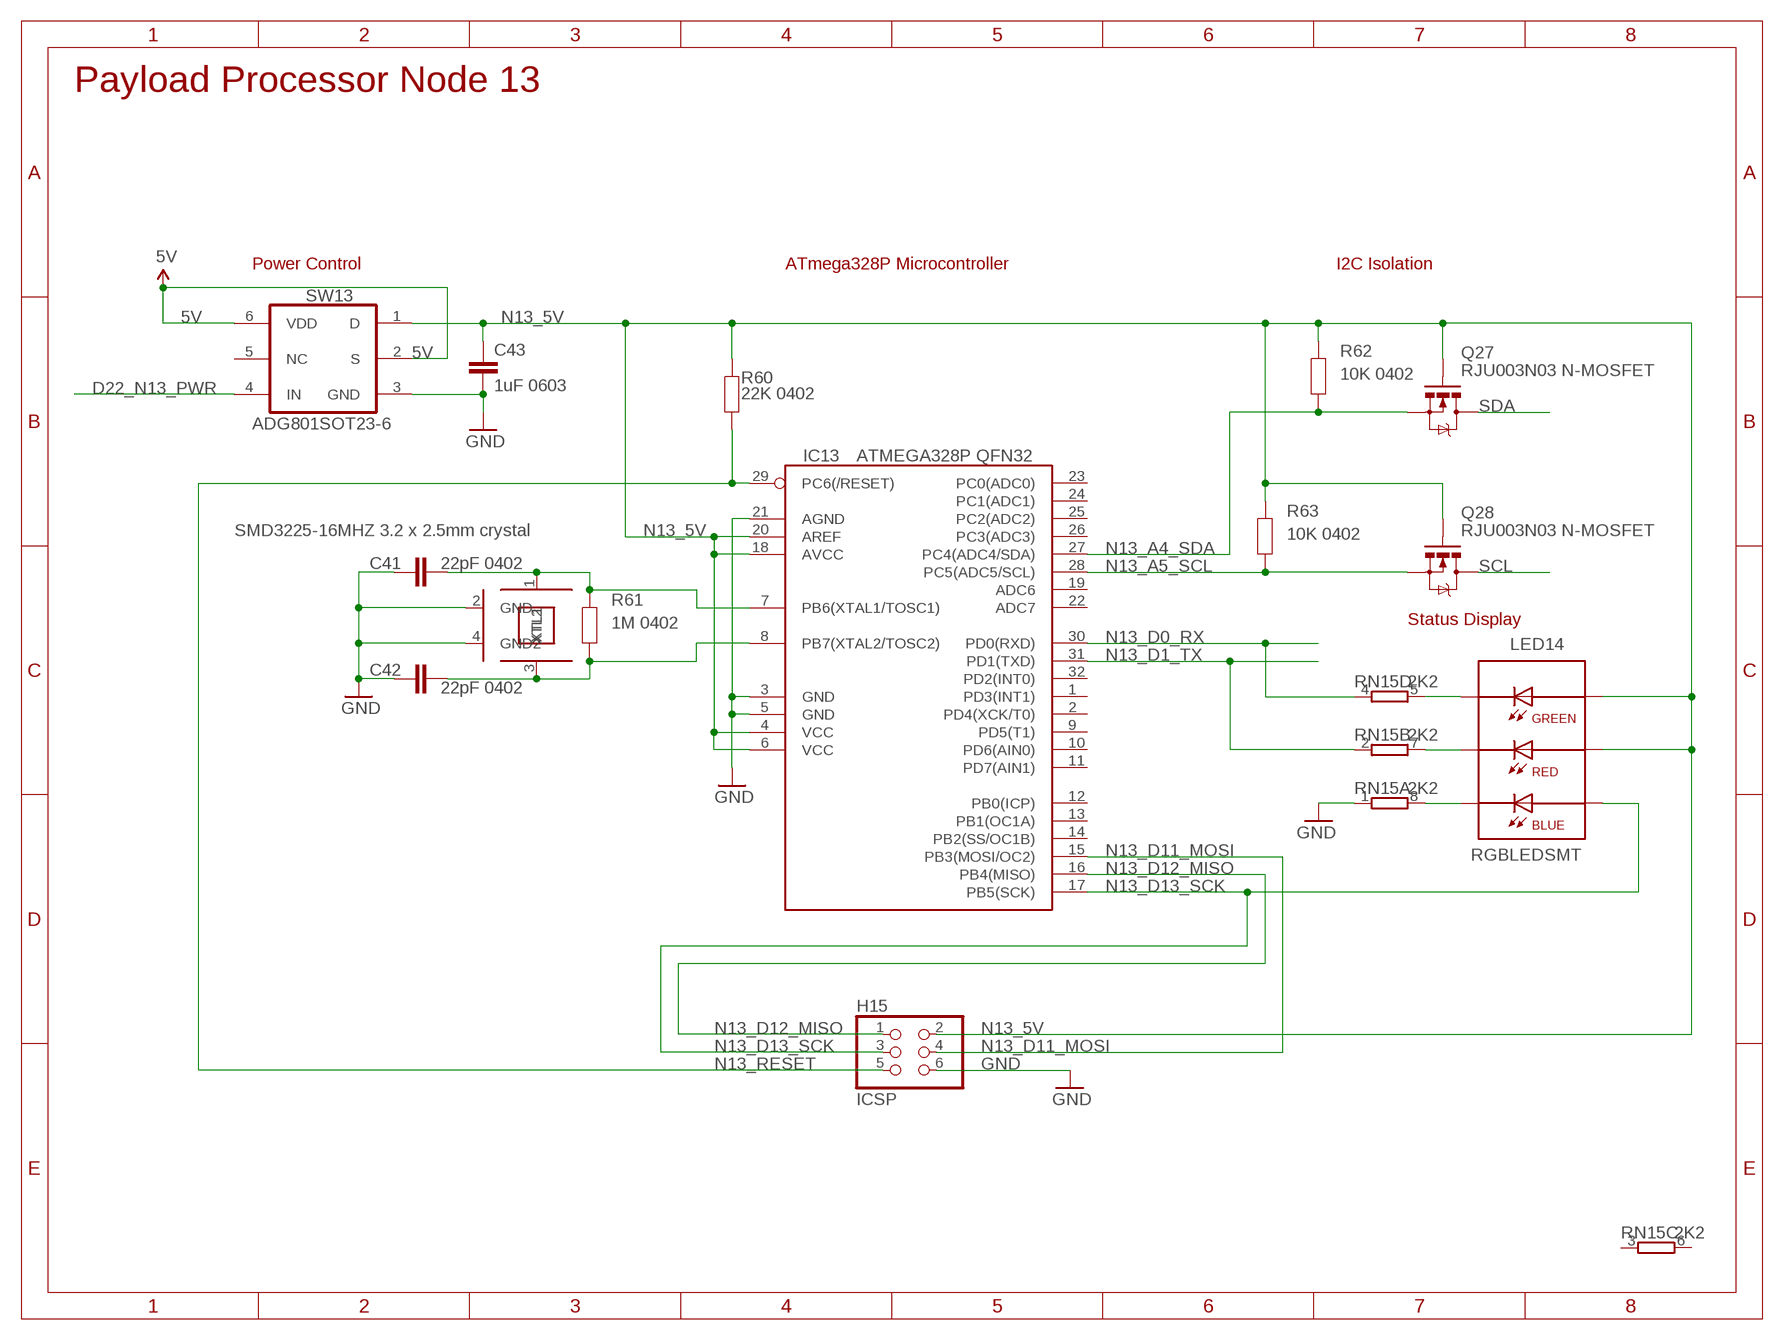
[diagram p15: schematic, sheet 16]

### Parts
C41  22pF 0402  C-EU0402C  [0402C]
C42  22pF 0402  C-EU0402C  [0402C]
C43  1uF 0603  C-EUC0603  [C0603]
H15  ICSP  ICSP2X3-2MM  [M2X3-2MM]
IC13  ATMEGA328P QFN32  AVR-MEGA8-MI  [MLF32]
LED14  RGBLEDSMT  [19-337]
Q27  RJU003N03 N-MOSFET  MOSFET-NSOT-323  [SOT32-3]
Q28  RJU003N03 N-MOSFET  MOSFET-NSOT-323  [SOT32-3]
R60  22K 0402  RESISTOR0402  [0402]
R61  1M 0402  RESISTOR0402  [0402]
R62  10K 0402  RESISTOR0402  [0402]
R63  10K 0402  RESISTOR0402  [0402]
RN15  2K2  4R-NCAY16  [CAY16]
SW13  ADG801SOT23-6  [SOT23-6]
XTL13  SMD3225-16MHZ 3.2 x 2.5mm crystal  CRYSTAL-GND3X2  [CRYSTAL-SMD-3X2]

### Nets
5V: SW13.2(S) SW13.6(VDD) ; also sheet 1,2,3,4,5,6,7,8,9,10,11,12,13,14,15,17,18,19
D22_N13_PWR: SW13.4(IN) ; also sheet 2
GND: C41.1 C42.1 C43.2 H15.6 IC13.3(GND) IC13.5(GND) IC13.21(AGND) RN15.1 SW13.3(GND) XTL13.2(GND) XTL13.4(GND2) ; also sheet 1,2,3,4,5,6,7,8,9,10,11,12,13,14,15,17,18,19
N13_5V: C43.1 H15.2 IC13.4(VCC) IC13.6(VCC) IC13.18(AVCC) IC13.20(AREF) LED14.5(A-R) LED14.6(A-G) Q27.1(G) Q28.1(G) R60.2 R62.2 R63.2 SW13.1(D)
N13_A4_SDA: IC13.27(PC4(ADC4/SDA)) Q27.2(S) R62.1
N13_A5_SCL: IC13.28(PC5(ADC5/SCL)) Q28.2(S) R63.1
N13_D0_RX: IC13.30(PD0(RXD)) RN15.4 ; also sheet 2
N13_D1_TX: IC13.31(PD1(TXD)) RN15.2 ; also sheet 2
N13_D11_MOSI: H15.4 IC13.15(PB3(MOSI/OC2))
N13_D12_MISO: H15.1 IC13.16(PB4(MISO))
N13_D13_SCK: H15.3 IC13.17(PB5(SCK)) LED14.4(A-B)
N13_RESET: H15.5 IC13.29(PC6(/RESET)) R60.1
N$7646: C42.2 IC13.8(PB7(XTAL2/TOSC2)) R61.1 XTL13.3(XTL2)
N$7647: C41.2 IC13.7(PB6(XTAL1/TOSC1)) R61.2 XTL13.1(XTL1)
N$7648: LED14.2(C-R) RN15.7
N$7649: LED14.1(C-B) RN15.8
N$7650: LED14.3(C-G) RN15.5
SCL: Q28.3(D) ; also sheet 1,2,3,4,5,6,7,8,9,10,11,12,13,14,15,17,18,19
SDA: Q27.3(D) ; also sheet 1,2,3,4,5,6,7,8,9,10,11,12,13,14,15,17,18,19
Unconnected: IC13.1(PD3(INT1)) IC13.2(PD4(XCK/T0)) IC13.9(PD5(T1)) IC13.10(PD6(AIN0)) IC13.11(PD7(AIN1)) IC13.12(PB0(ICP)) IC13.13(PB1(OC1A)) IC13.14(PB2(SS/OC1B)) IC13.19(ADC6) IC13.22(ADC7) IC13.23(PC0(ADC0)) IC13.24(PC1(ADC1)) IC13.25(PC2(ADC2)) IC13.26(PC3(ADC3)) IC13.32(PD2(INT0)) RN15.3 RN15.6 SW13.5(NC)

### Notes on the sheet
- Payload Processor Node 13
- Power Control | ATmega328P Microcontroller | I2C Isolation
- SMD3225-16MHZ 3.2 x 2.5mm crystal
- Status Display

## Sheet 17 of 19
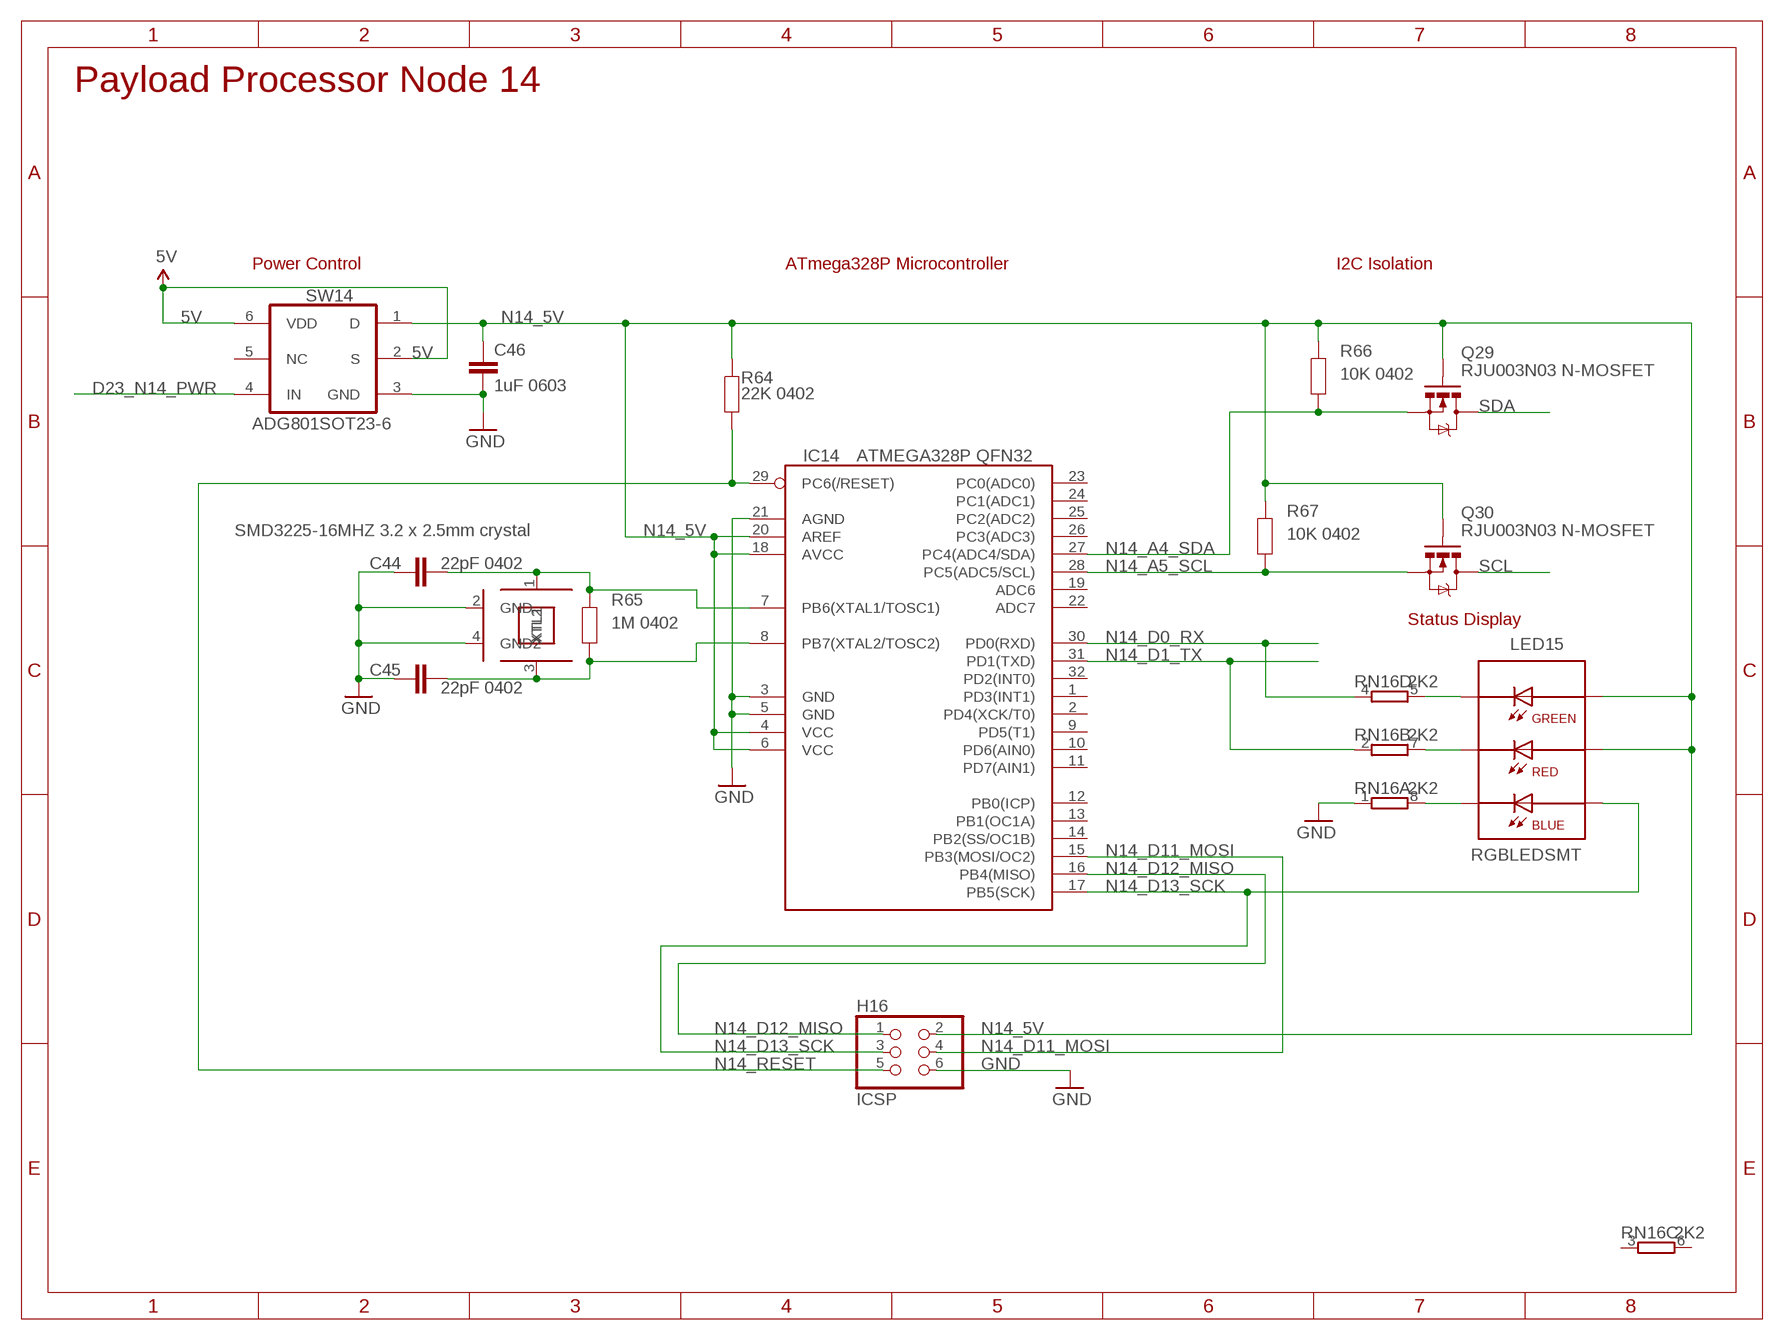
[diagram p16: schematic, sheet 17]

### Parts
C44  22pF 0402  C-EU0402C  [0402C]
C45  22pF 0402  C-EU0402C  [0402C]
C46  1uF 0603  C-EUC0603  [C0603]
H16  ICSP  ICSP2X3-2MM  [M2X3-2MM]
IC14  ATMEGA328P QFN32  AVR-MEGA8-MI  [MLF32]
LED15  RGBLEDSMT  [19-337]
Q29  RJU003N03 N-MOSFET  MOSFET-NSOT-323  [SOT32-3]
Q30  RJU003N03 N-MOSFET  MOSFET-NSOT-323  [SOT32-3]
R64  22K 0402  RESISTOR0402  [0402]
R65  1M 0402  RESISTOR0402  [0402]
R66  10K 0402  RESISTOR0402  [0402]
R67  10K 0402  RESISTOR0402  [0402]
RN16  2K2  4R-NCAY16  [CAY16]
SW14  ADG801SOT23-6  [SOT23-6]
XTL14  SMD3225-16MHZ 3.2 x 2.5mm crystal  CRYSTAL-GND3X2  [CRYSTAL-SMD-3X2]

### Nets
5V: SW14.2(S) SW14.6(VDD) ; also sheet 1,2,3,4,5,6,7,8,9,10,11,12,13,14,15,16,18,19
D23_N14_PWR: SW14.4(IN) ; also sheet 2
GND: C44.1 C45.1 C46.2 H16.6 IC14.3(GND) IC14.5(GND) IC14.21(AGND) RN16.1 SW14.3(GND) XTL14.2(GND) XTL14.4(GND2) ; also sheet 1,2,3,4,5,6,7,8,9,10,11,12,13,14,15,16,18,19
N14_5V: C46.1 H16.2 IC14.4(VCC) IC14.6(VCC) IC14.18(AVCC) IC14.20(AREF) LED15.5(A-R) LED15.6(A-G) Q29.1(G) Q30.1(G) R64.2 R66.2 R67.2 SW14.1(D)
N14_A4_SDA: IC14.27(PC4(ADC4/SDA)) Q29.2(S) R66.1
N14_A5_SCL: IC14.28(PC5(ADC5/SCL)) Q30.2(S) R67.1
N14_D0_RX: IC14.30(PD0(RXD)) RN16.4 ; also sheet 2
N14_D1_TX: IC14.31(PD1(TXD)) RN16.2 ; also sheet 2
N14_D11_MOSI: H16.4 IC14.15(PB3(MOSI/OC2))
N14_D12_MISO: H16.1 IC14.16(PB4(MISO))
N14_D13_SCK: H16.3 IC14.17(PB5(SCK)) LED15.4(A-B)
N14_RESET: H16.5 IC14.29(PC6(/RESET)) R64.1
N$8234: C45.2 IC14.8(PB7(XTAL2/TOSC2)) R65.1 XTL14.3(XTL2)
N$8235: C44.2 IC14.7(PB6(XTAL1/TOSC1)) R65.2 XTL14.1(XTL1)
N$8236: LED15.2(C-R) RN16.7
N$8237: LED15.1(C-B) RN16.8
N$8238: LED15.3(C-G) RN16.5
SCL: Q30.3(D) ; also sheet 1,2,3,4,5,6,7,8,9,10,11,12,13,14,15,16,18,19
SDA: Q29.3(D) ; also sheet 1,2,3,4,5,6,7,8,9,10,11,12,13,14,15,16,18,19
Unconnected: IC14.1(PD3(INT1)) IC14.2(PD4(XCK/T0)) IC14.9(PD5(T1)) IC14.10(PD6(AIN0)) IC14.11(PD7(AIN1)) IC14.12(PB0(ICP)) IC14.13(PB1(OC1A)) IC14.14(PB2(SS/OC1B)) IC14.19(ADC6) IC14.22(ADC7) IC14.23(PC0(ADC0)) IC14.24(PC1(ADC1)) IC14.25(PC2(ADC2)) IC14.26(PC3(ADC3)) IC14.32(PD2(INT0)) RN16.3 RN16.6 SW14.5(NC)

### Notes on the sheet
- Payload Processor Node 14
- Power Control | ATmega328P Microcontroller | I2C Isolation
- SMD3225-16MHZ 3.2 x 2.5mm crystal
- Status Display

## Sheet 18 of 19
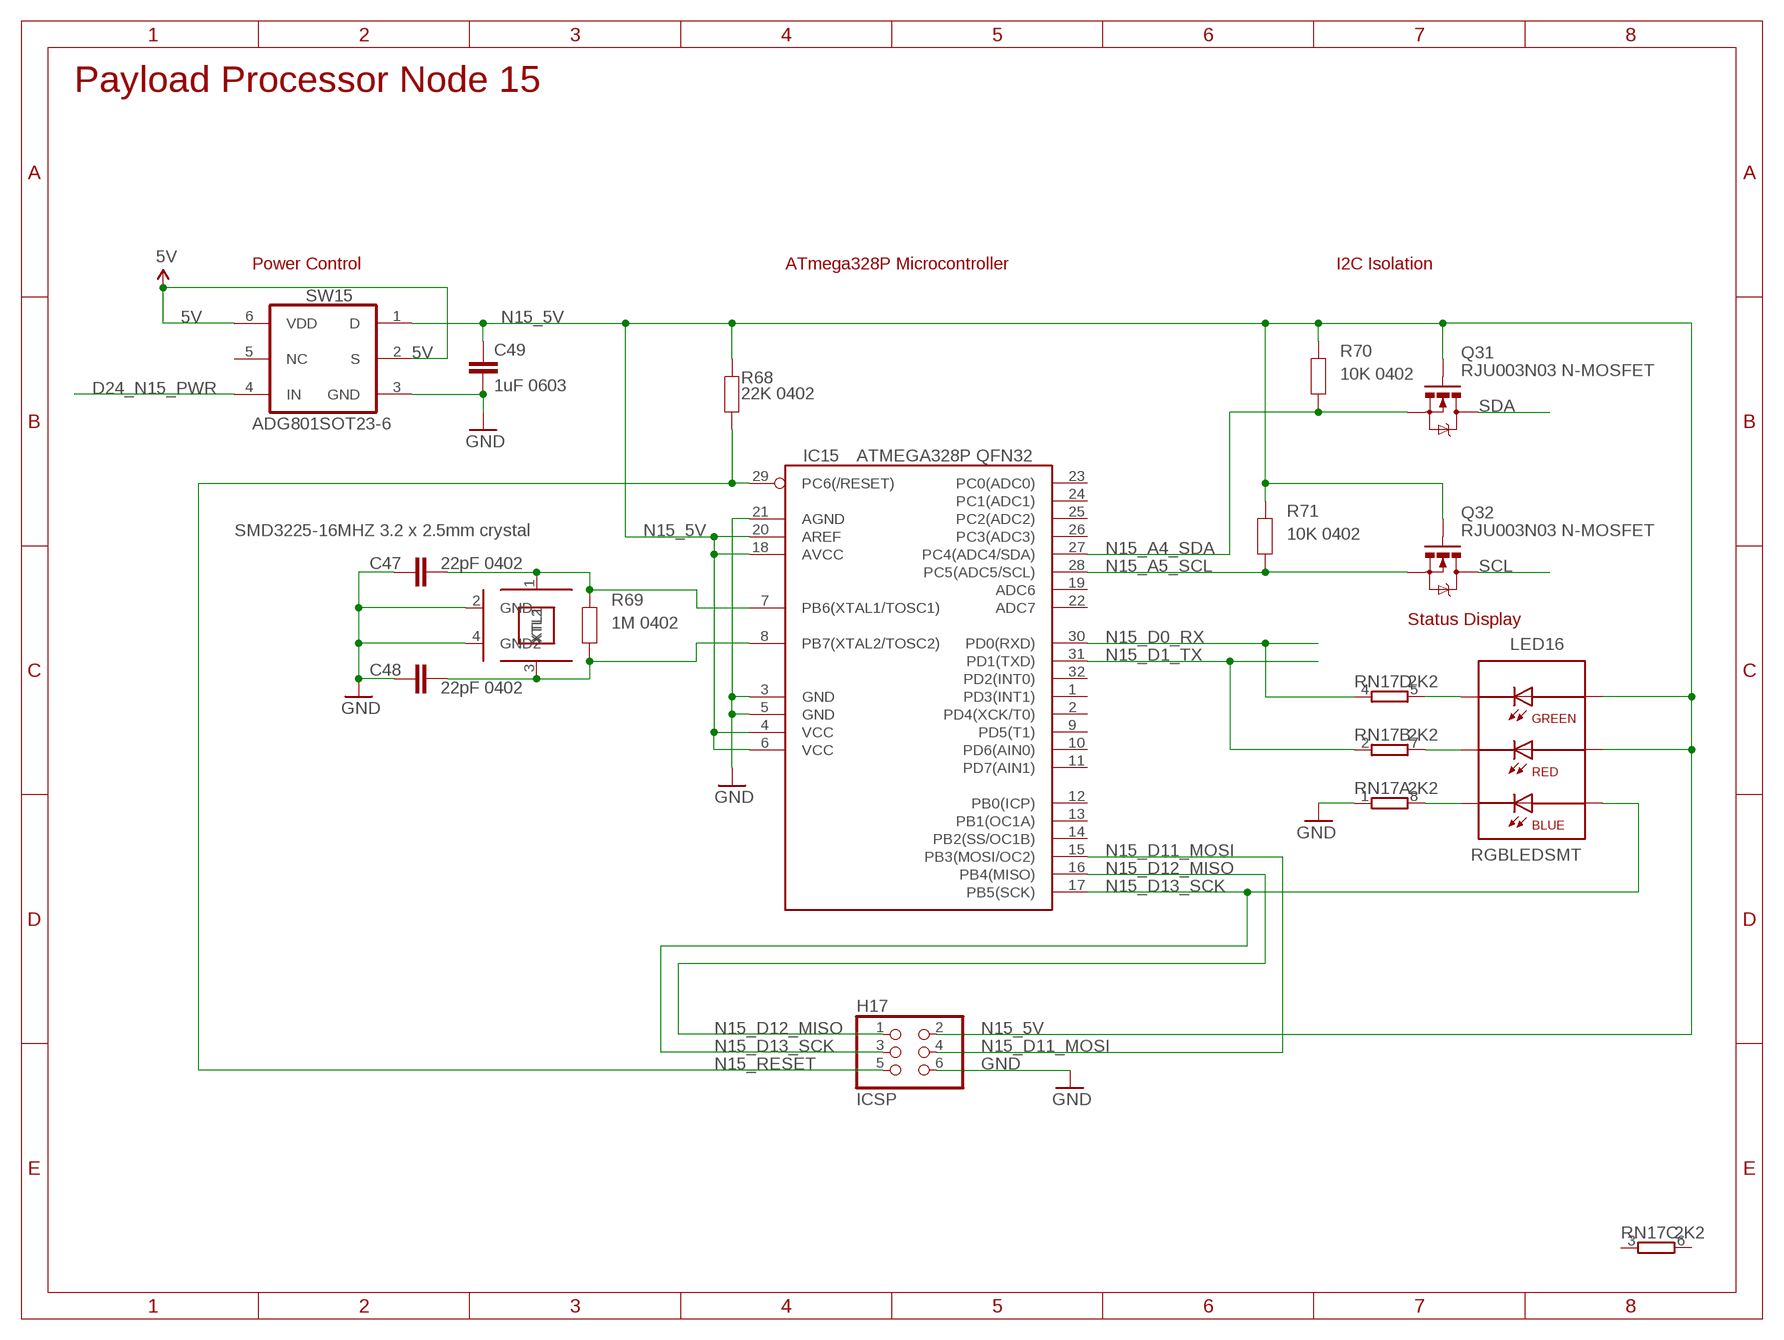
[diagram p17: schematic, sheet 18]

### Parts
C47  22pF 0402  C-EU0402C  [0402C]
C48  22pF 0402  C-EU0402C  [0402C]
C49  1uF 0603  C-EUC0603  [C0603]
H17  ICSP  ICSP2X3-2MM  [M2X3-2MM]
IC15  ATMEGA328P QFN32  AVR-MEGA8-MI  [MLF32]
LED16  RGBLEDSMT  [19-337]
Q31  RJU003N03 N-MOSFET  MOSFET-NSOT-323  [SOT32-3]
Q32  RJU003N03 N-MOSFET  MOSFET-NSOT-323  [SOT32-3]
R68  22K 0402  RESISTOR0402  [0402]
R69  1M 0402  RESISTOR0402  [0402]
R70  10K 0402  RESISTOR0402  [0402]
R71  10K 0402  RESISTOR0402  [0402]
RN17  2K2  4R-NCAY16  [CAY16]
SW15  ADG801SOT23-6  [SOT23-6]
XTL15  SMD3225-16MHZ 3.2 x 2.5mm crystal  CRYSTAL-GND3X2  [CRYSTAL-SMD-3X2]

### Nets
5V: SW15.2(S) SW15.6(VDD) ; also sheet 1,2,3,4,5,6,7,8,9,10,11,12,13,14,15,16,17,19
D24_N15_PWR: SW15.4(IN) ; also sheet 2
GND: C47.1 C48.1 C49.2 H17.6 IC15.3(GND) IC15.5(GND) IC15.21(AGND) RN17.1 SW15.3(GND) XTL15.2(GND) XTL15.4(GND2) ; also sheet 1,2,3,4,5,6,7,8,9,10,11,12,13,14,15,16,17,19
N15_5V: C49.1 H17.2 IC15.4(VCC) IC15.6(VCC) IC15.18(AVCC) IC15.20(AREF) LED16.5(A-R) LED16.6(A-G) Q31.1(G) Q32.1(G) R68.2 R70.2 R71.2 SW15.1(D)
N15_A4_SDA: IC15.27(PC4(ADC4/SDA)) Q31.2(S) R70.1
N15_A5_SCL: IC15.28(PC5(ADC5/SCL)) Q32.2(S) R71.1
N15_D0_RX: IC15.30(PD0(RXD)) RN17.4 ; also sheet 2
N15_D1_TX: IC15.31(PD1(TXD)) RN17.2 ; also sheet 2
N15_D11_MOSI: H17.4 IC15.15(PB3(MOSI/OC2))
N15_D12_MISO: H17.1 IC15.16(PB4(MISO))
N15_D13_SCK: H17.3 IC15.17(PB5(SCK)) LED16.4(A-B)
N15_RESET: H17.5 IC15.29(PC6(/RESET)) R68.1
N$8822: C48.2 IC15.8(PB7(XTAL2/TOSC2)) R69.1 XTL15.3(XTL2)
N$8823: C47.2 IC15.7(PB6(XTAL1/TOSC1)) R69.2 XTL15.1(XTL1)
N$8824: LED16.2(C-R) RN17.7
N$8825: LED16.1(C-B) RN17.8
N$8826: LED16.3(C-G) RN17.5
SCL: Q32.3(D) ; also sheet 1,2,3,4,5,6,7,8,9,10,11,12,13,14,15,16,17,19
SDA: Q31.3(D) ; also sheet 1,2,3,4,5,6,7,8,9,10,11,12,13,14,15,16,17,19
Unconnected: IC15.1(PD3(INT1)) IC15.2(PD4(XCK/T0)) IC15.9(PD5(T1)) IC15.10(PD6(AIN0)) IC15.11(PD7(AIN1)) IC15.12(PB0(ICP)) IC15.13(PB1(OC1A)) IC15.14(PB2(SS/OC1B)) IC15.19(ADC6) IC15.22(ADC7) IC15.23(PC0(ADC0)) IC15.24(PC1(ADC1)) IC15.25(PC2(ADC2)) IC15.26(PC3(ADC3)) IC15.32(PD2(INT0)) RN17.3 RN17.6 SW15.5(NC)

### Notes on the sheet
- Payload Processor Node 15
- Power Control | ATmega328P Microcontroller | I2C Isolation
- SMD3225-16MHZ 3.2 x 2.5mm crystal
- Status Display

## Sheet 19 of 19
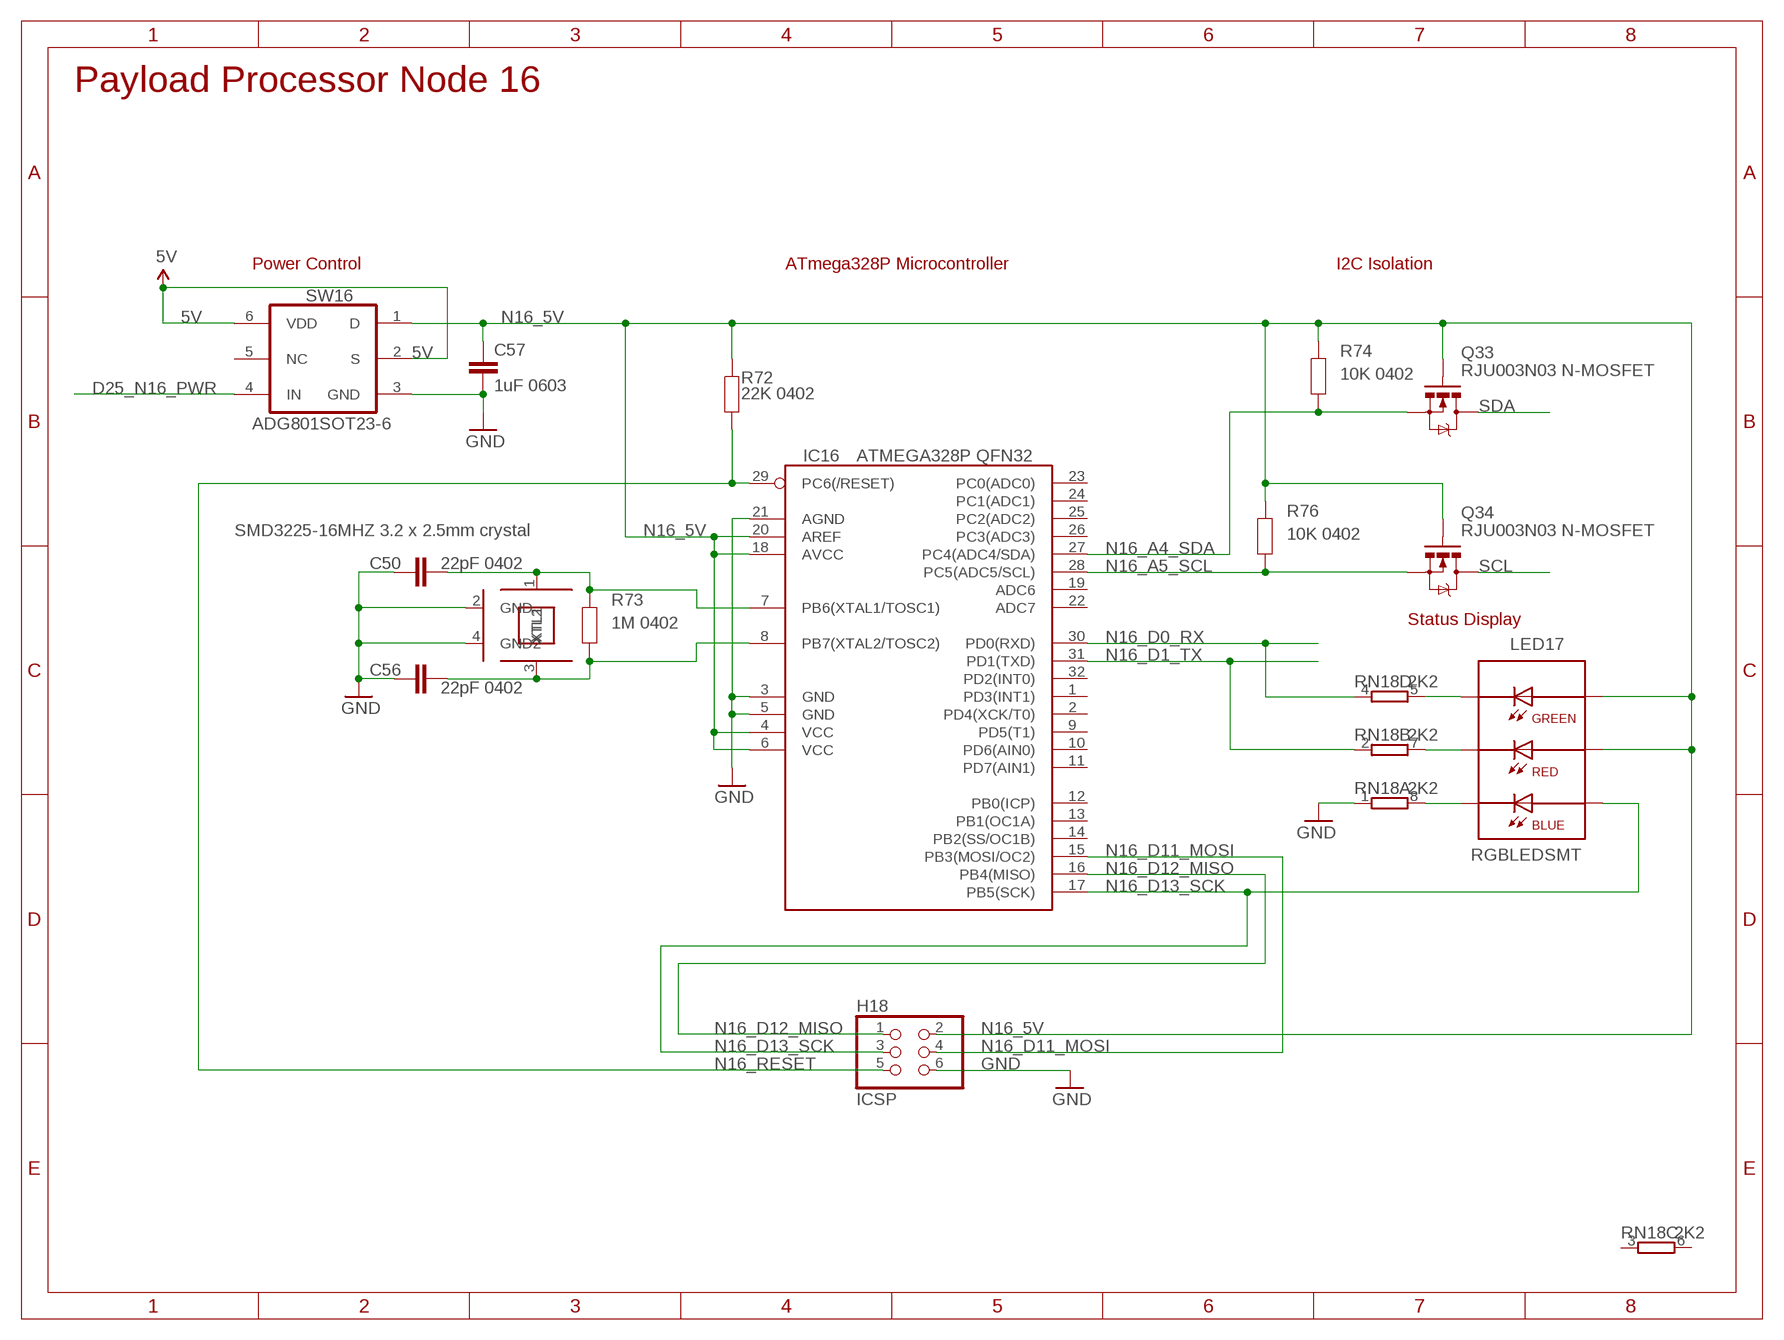
[diagram p18: schematic, sheet 19]

### Parts
C50  22pF 0402  C-EU0402C  [0402C]
C56  22pF 0402  C-EU0402C  [0402C]
C57  1uF 0603  C-EUC0603  [C0603]
H18  ICSP  ICSP2X3-2MM  [M2X3-2MM]
IC16  ATMEGA328P QFN32  AVR-MEGA8-MI  [MLF32]
LED17  RGBLEDSMT  [19-337]
Q33  RJU003N03 N-MOSFET  MOSFET-NSOT-323  [SOT32-3]
Q34  RJU003N03 N-MOSFET  MOSFET-NSOT-323  [SOT32-3]
R72  22K 0402  RESISTOR0402  [0402]
R73  1M 0402  RESISTOR0402  [0402]
R74  10K 0402  RESISTOR0402  [0402]
R76  10K 0402  RESISTOR0402  [0402]
RN18  2K2  4R-NCAY16  [CAY16]
SW16  ADG801SOT23-6  [SOT23-6]
XTL16  SMD3225-16MHZ 3.2 x 2.5mm crystal  CRYSTAL-GND3X2  [CRYSTAL-SMD-3X2]

### Nets
5V: SW16.2(S) SW16.6(VDD) ; also sheet 1,2,3,4,5,6,7,8,9,10,11,12,13,14,15,16,17,18
D25_N16_PWR: SW16.4(IN) ; also sheet 2
GND: C50.1 C56.1 C57.2 H18.6 IC16.3(GND) IC16.5(GND) IC16.21(AGND) RN18.1 SW16.3(GND) XTL16.2(GND) XTL16.4(GND2) ; also sheet 1,2,3,4,5,6,7,8,9,10,11,12,13,14,15,16,17,18
N16_5V: C57.1 H18.2 IC16.4(VCC) IC16.6(VCC) IC16.18(AVCC) IC16.20(AREF) LED17.5(A-R) LED17.6(A-G) Q33.1(G) Q34.1(G) R72.2 R74.2 R76.2 SW16.1(D)
N16_A4_SDA: IC16.27(PC4(ADC4/SDA)) Q33.2(S) R74.1
N16_A5_SCL: IC16.28(PC5(ADC5/SCL)) Q34.2(S) R76.1
N16_D0_RX: IC16.30(PD0(RXD)) RN18.4 ; also sheet 2
N16_D1_TX: IC16.31(PD1(TXD)) RN18.2 ; also sheet 2
N16_D11_MOSI: H18.4 IC16.15(PB3(MOSI/OC2))
N16_D12_MISO: H18.1 IC16.16(PB4(MISO))
N16_D13_SCK: H18.3 IC16.17(PB5(SCK)) LED17.4(A-B)
N16_RESET: H18.5 IC16.29(PC6(/RESET)) R72.1
N$9410: C56.2 IC16.8(PB7(XTAL2/TOSC2)) R73.1 XTL16.3(XTL2)
N$9411: C50.2 IC16.7(PB6(XTAL1/TOSC1)) R73.2 XTL16.1(XTL1)
N$9412: LED17.2(C-R) RN18.7
N$9413: LED17.1(C-B) RN18.8
N$9414: LED17.3(C-G) RN18.5
SCL: Q34.3(D) ; also sheet 1,2,3,4,5,6,7,8,9,10,11,12,13,14,15,16,17,18
SDA: Q33.3(D) ; also sheet 1,2,3,4,5,6,7,8,9,10,11,12,13,14,15,16,17,18
Unconnected: IC16.1(PD3(INT1)) IC16.2(PD4(XCK/T0)) IC16.9(PD5(T1)) IC16.10(PD6(AIN0)) IC16.11(PD7(AIN1)) IC16.12(PB0(ICP)) IC16.13(PB1(OC1A)) IC16.14(PB2(SS/OC1B)) IC16.19(ADC6) IC16.22(ADC7) IC16.23(PC0(ADC0)) IC16.24(PC1(ADC1)) IC16.25(PC2(ADC2)) IC16.26(PC3(ADC3)) IC16.32(PD2(INT0)) RN18.3 RN18.6 SW16.5(NC)

### Notes on the sheet
- Payload Processor Node 16
- Power Control | ATmega328P Microcontroller | I2C Isolation
- SMD3225-16MHZ 3.2 x 2.5mm crystal
- Status Display